# EAGLE schematic GTA04b7 (EAGLE 7.4.0), part 1 of 3
Assembly variants: Full, BB-XM, Default

## Sheet 1 of 38
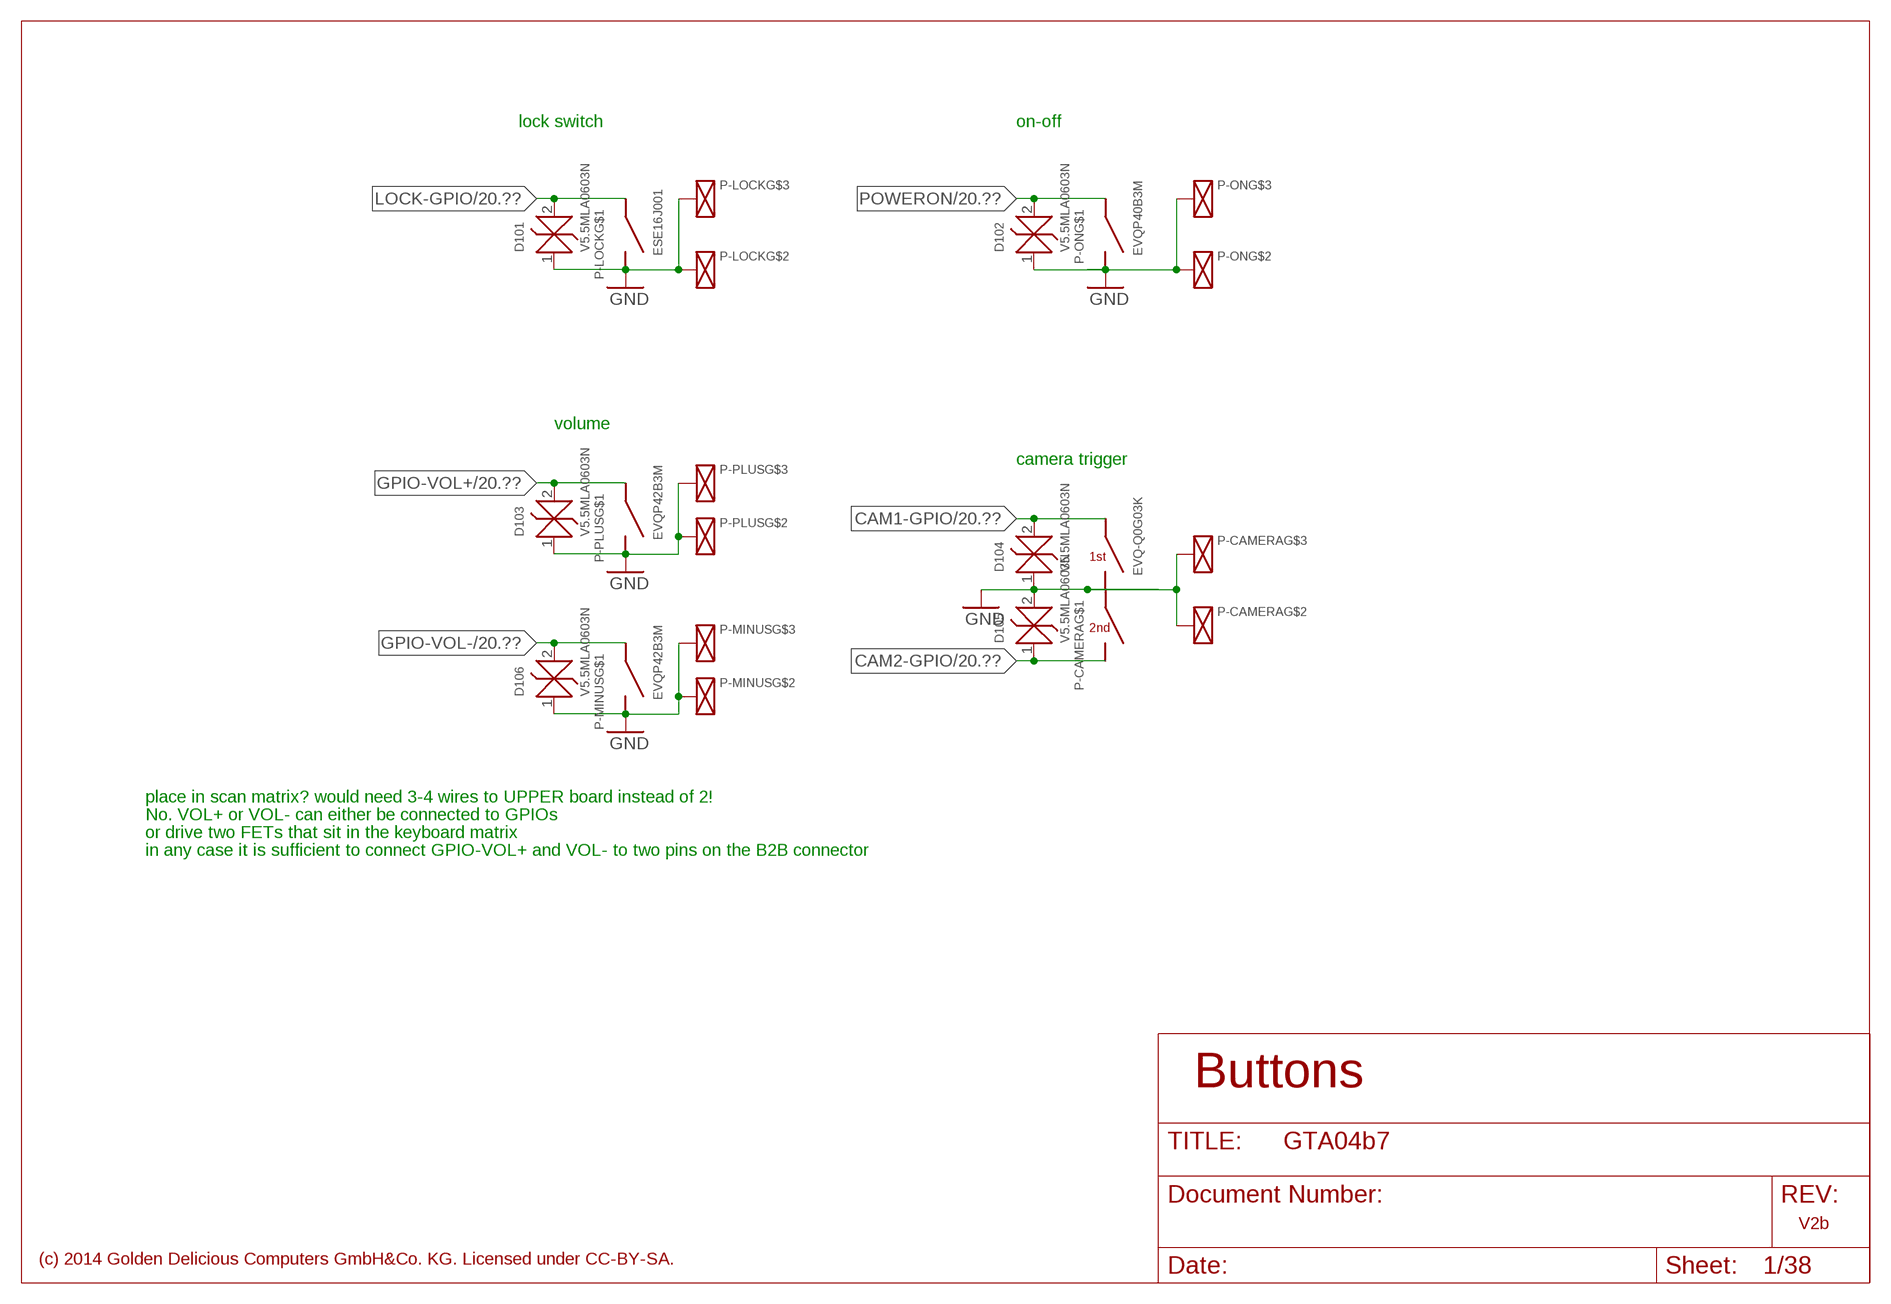
[diagram p0: schematic, sheet 1]

### Parts
D101  V5.5MLA0603N  [SMD-0603]
D102  V5.5MLA0603N  [SMD-0603]
D103  V5.5MLA0603N  [SMD-0603]
D104  V5.5MLA0603N  [SMD-0603]
D105  V5.5MLA0603N  [SMD-0603]
D106  V5.5MLA0603N  [SMD-0603]
P-CAMERA  EVQ-Q0G03K  BUTTON-2LEVEL  [EVQQ0]
P-LOCK  ESE16J001  BUTTON-GND-ESE16  [ESE-16J001]
P-MINUS  EVQP42B3M  BUTTON-GND-EVQP4  [EVQP40B3M]
P-ON  EVQP40B3M  BUTTON-GND-EVQP4  [EVQP40B3M]
P-PLUS  EVQP42B3M  BUTTON-GND-EVQP4  [EVQP40B3M]

### Nets
CAM1-GPIO: D104.2(K) P-CAMERA.1 ; also sheet 20
CAM2-GPIO: D105.1(A) P-CAMERA.2 ; also sheet 20
GND [GND]: D101.1(A) D102.1(A) D103.1(A) D104.1(A) D105.2(K) D106.1(A) P-CAMERA.3 P-CAMERA.S1(SHIELD) P-CAMERA.S2(SHIELD) P-LOCK.2(SHIELD) P-LOCK.3(B) P-LOCK.4(SHIELD) P-MINUS.2(B) P-MINUS.S1(SHIELD) P-MINUS.S2(SHIELD) P-ON.2(B) P-ON.S1(SHIELD) P-ON.S2(SHIELD) P-PLUS.2(B) P-PLUS.S1(SHIELD) P-PLUS.S2(SHIELD) ; also sheet 2,3,4,5,6,7,8,9,10,11,12,13,14,15,16,17,18,19,20
GPIO-VOL+: D103.2(K) P-PLUS.1(A) ; also sheet 20
GPIO-VOL-: D106.2(K) P-MINUS.1(A) ; also sheet 20
LOCK-GPIO: D101.2(K) P-LOCK.1(A) ; also sheet 20
POWERON [GND]: D102.2(K) P-ON.1(A) ; also sheet 20

### Notes on the sheet
- lock switch | on-off
- volume
- camera trigger
- place in scan matrix? would need 3-4 wires to UPPER board instead of 2!
- No. VOL+ or VOL- can either be connected to GPIOs
- or drive two FETs that sit in the keyboard matrix
- in any case it is sufficient to connect GPIO-VOL+ and VOL- to two pins on the B2B connector
- Buttons
- V2b
- (c) 2014 Golden Delicious Computers GmbH&Co. KG. Licensed under CC-BY-SA.

## Sheet 2 of 38
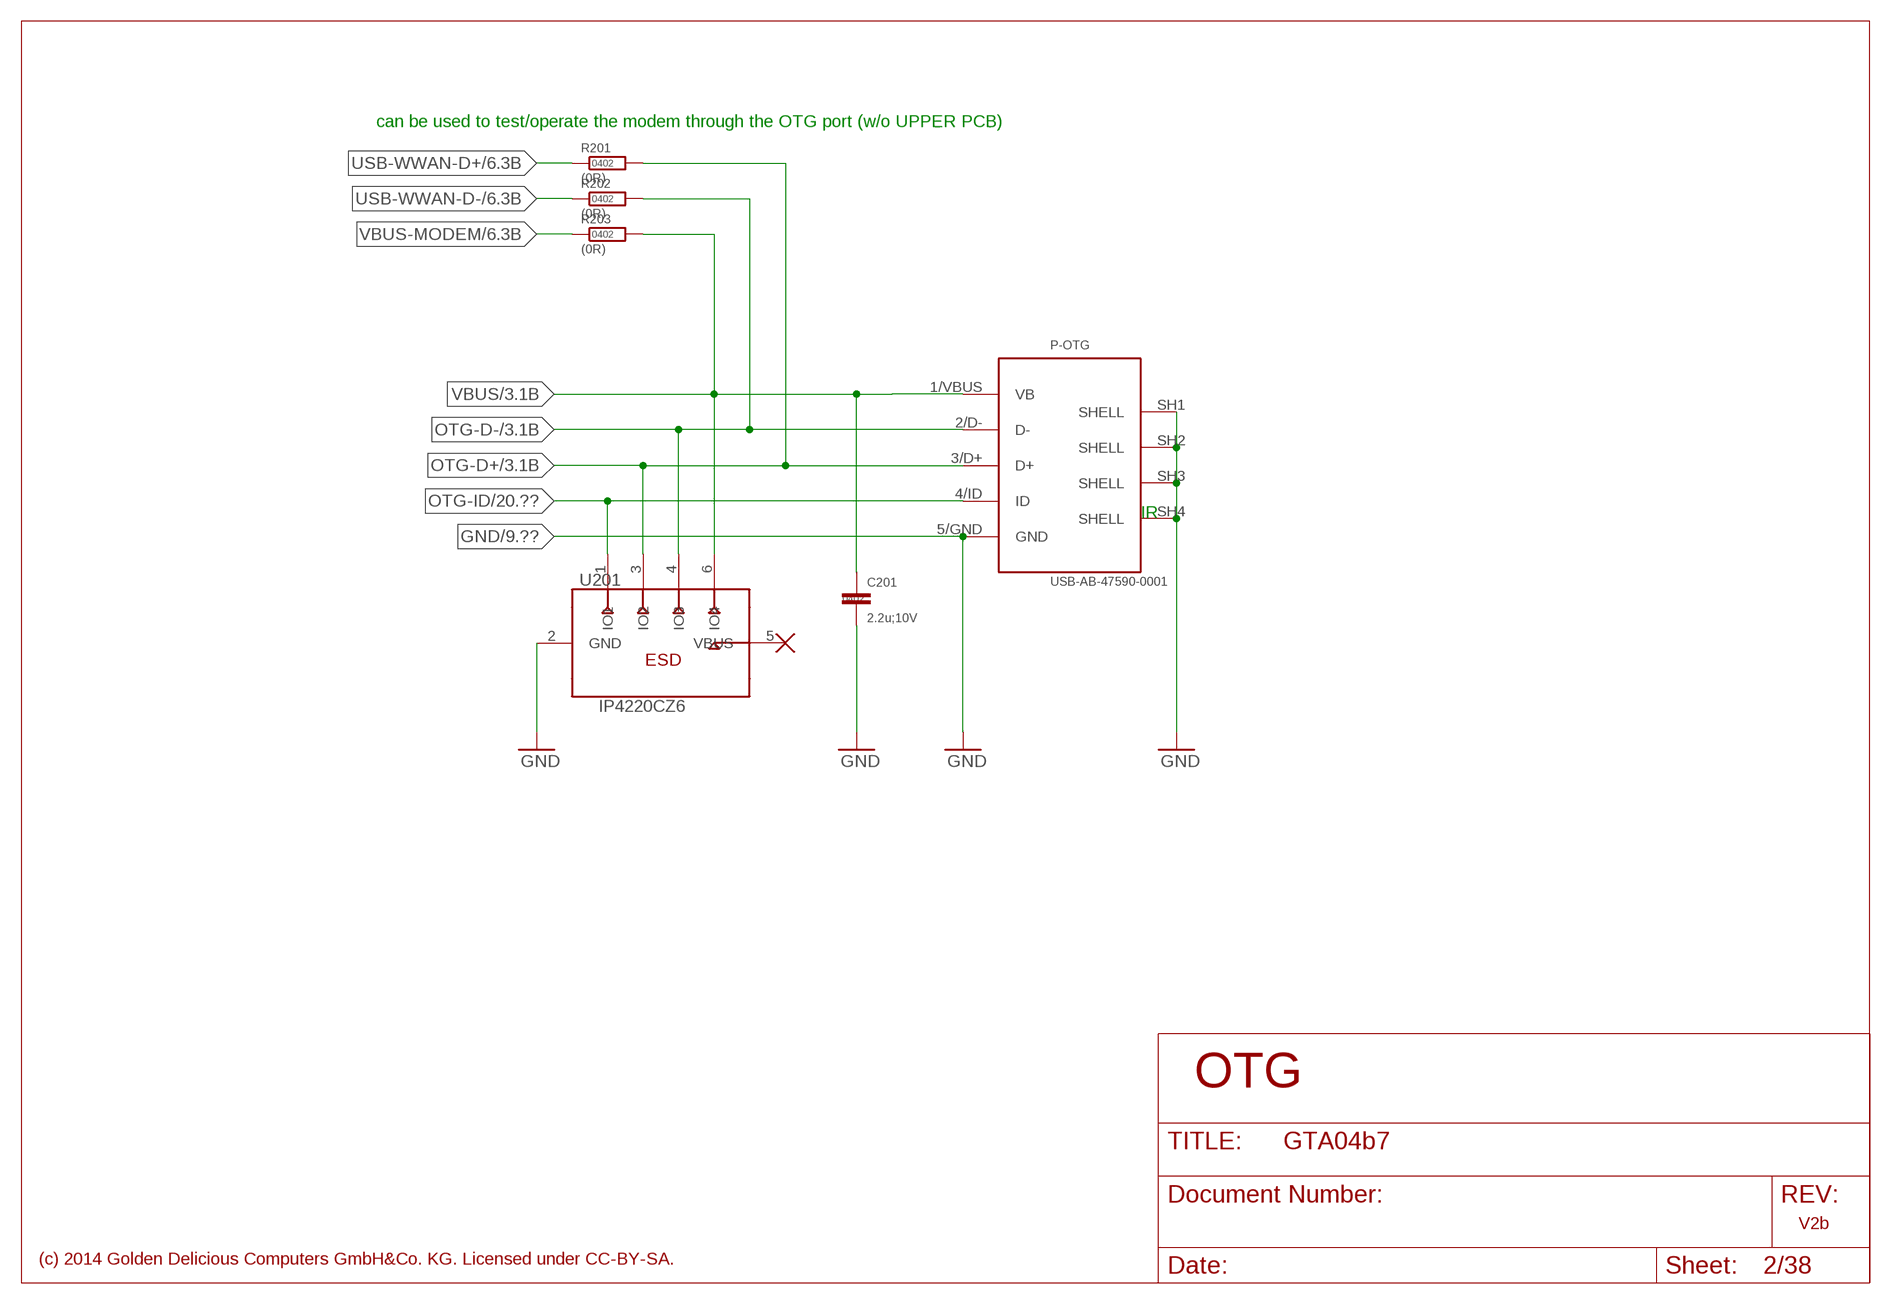
[diagram p1: schematic, sheet 2]

### Parts
C201  2.2u;10V  C0402  [SMD-0402]
P-OTG  USB-AB-47590-0001  [SD-47590-0001]
R201  (0R)  R0402  [SMD-0402]  (not fitted in variant Full)  (not fitted in variant BB-XM)
R202  (0R)  R0402  [SMD-0402]  (not fitted in variant Full)  (not fitted in variant BB-XM)
R203  (0R)  R0402  [SMD-0402]  (not fitted in variant Full)  (not fitted in variant BB-XM)
U201  IP4220CZ6  [SOT457-6]

### Nets
GND [GND]: C201.2 P-OTG.5/GND(GND) P-OTG.SH1(SHELL) P-OTG.SH2(SHELL) P-OTG.SH3(SHELL) P-OTG.SH4(SHELL) U201.2(GND) ; also sheet 1,3,4,5,6,7,8,9,10,11,12,13,14,15,16,17,18,19,20
OTG-D+ [90 Ohm]: P-OTG.3/D+(D+) R201.2 U201.3(IO2) ; also sheet 3,20
OTG-D- [90 Ohm]: P-OTG.2/D-(D-) R202.2 U201.4(IO3) ; also sheet 3,20
OTG-ID: P-OTG.4/ID(ID) U201.1(IO1) ; also sheet 20
USB-WWAN-D+ [90 Ohm]: R201.1 ; also sheet 6,18,20
USB-WWAN-D- [90 Ohm]: R202.1 ; also sheet 6,18,20
VBUS [Battery]: C201.1 P-OTG.1/VBUS(VB) U201.6(IO4) ; also sheet 3,18,20
VBUS-MODEM [Battery]: R203.1 ; also sheet 6,20
VBUS-MODEM-CPU: R203.2 ; also sheet 28,33
Unconnected: U201.5(VBUS)

### Notes on the sheet
- can be used to test/operate the modem through the OTG port (w/o UPPER PCB)
- IR
- OTG
- V2b
- (c) 2014 Golden Delicious Computers GmbH&Co. KG. Licensed under CC-BY-SA.

## Sheet 3 of 38
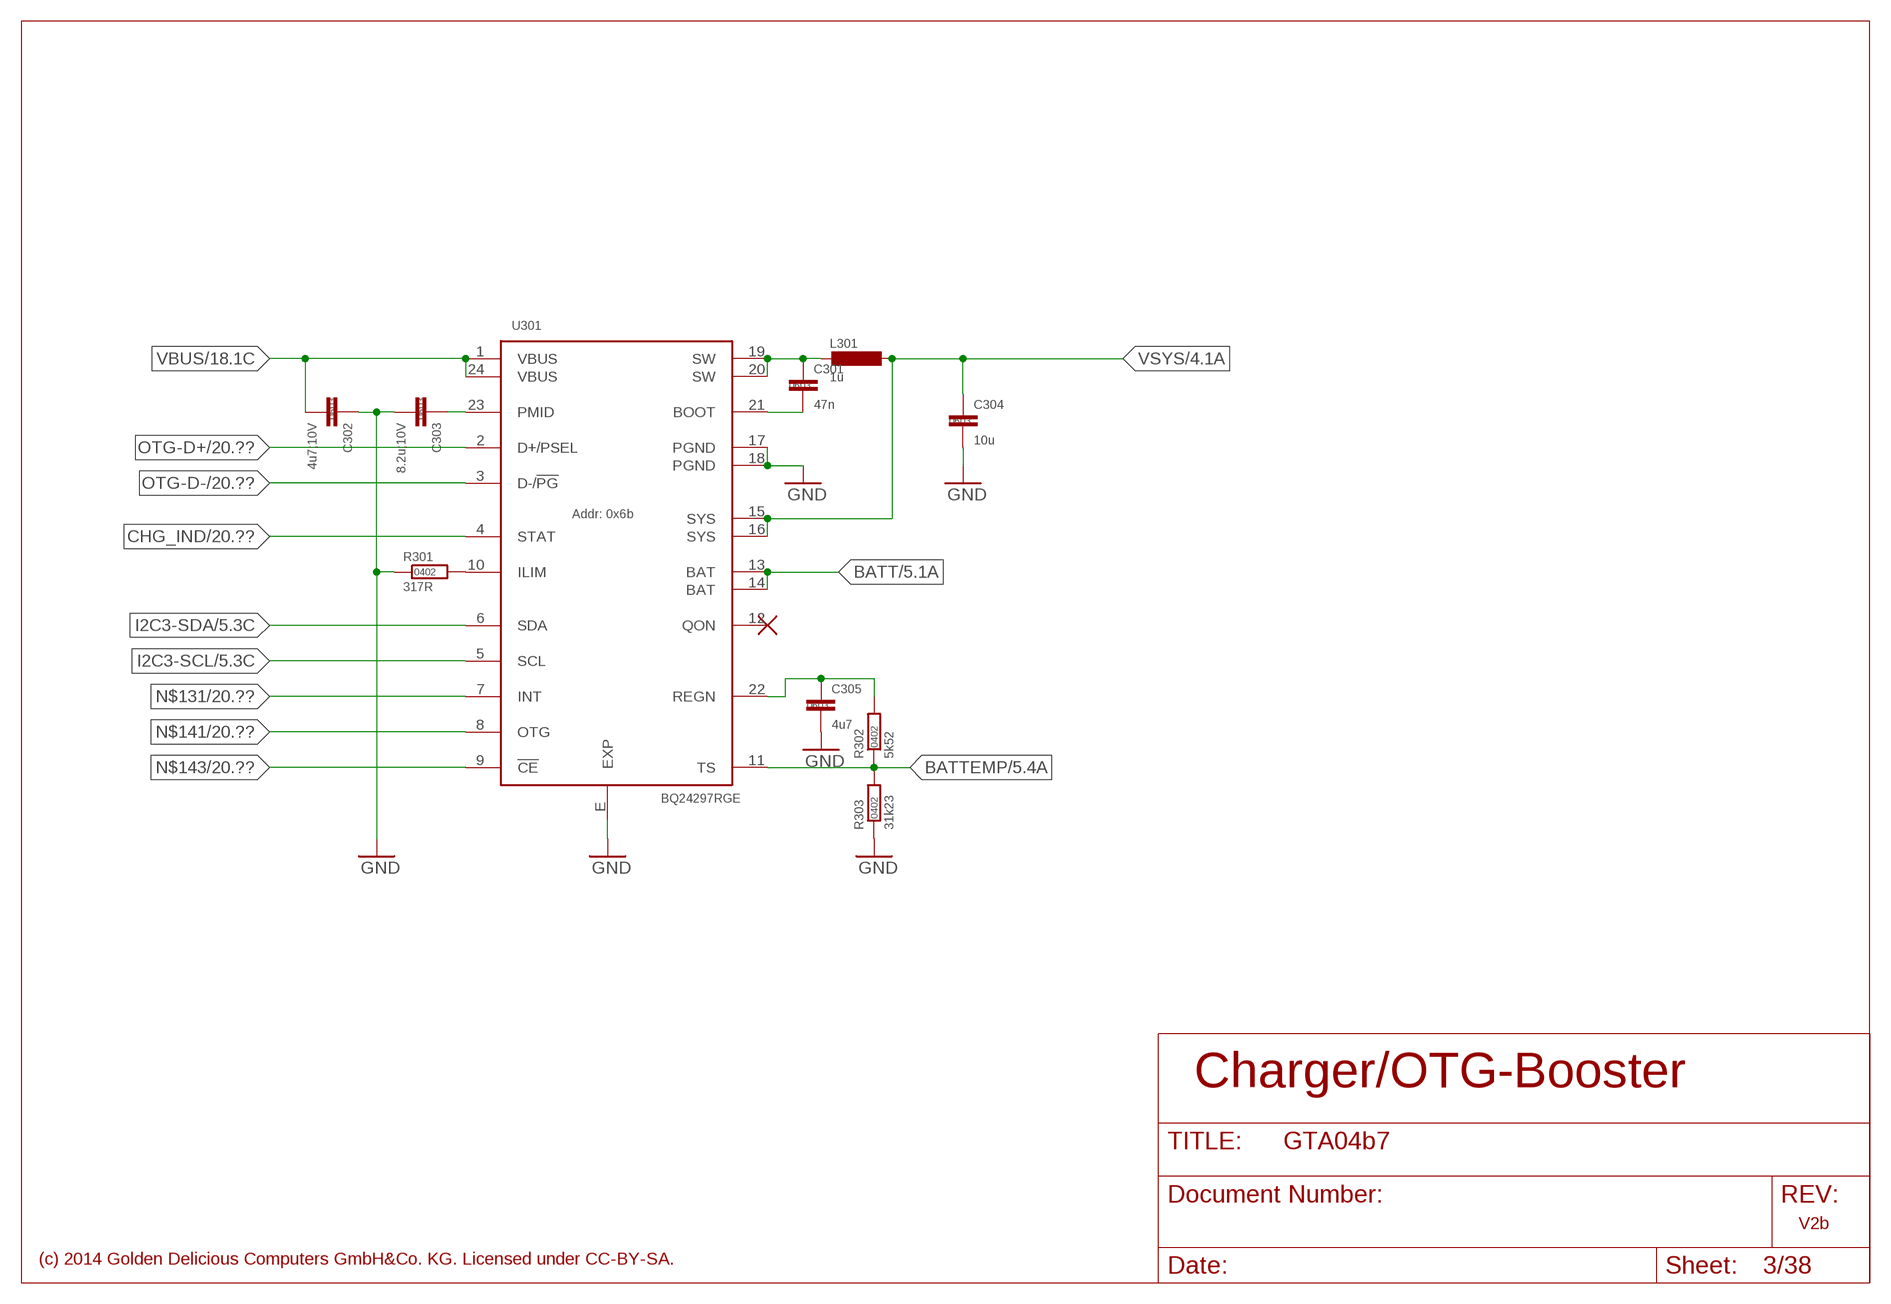
[diagram p2: schematic, sheet 3]

### Parts
C301  47n  C0603  [SMD-0603]
C302  4u7;10V  C0603  [SMD-0603]
C303  8.2u;10V  C0603  [SMD-0603]
C304  10u  C0603  [SMD-0603]
C305  4u7  C0603  [SMD-0603]
L301  1u  L1212  [SMD-1212]
R301  317R  R0402  [SMD-0402]
R302  5k52  R0402  [SMD-0402]
R303  31k23  R0402  [SMD-0402]
U301  BQ24297RGE  BQ2429XRGE  [S-PVQFN-N24-0.5]

### Nets
BATT [Battery]: U301.13(BAT) U301.14(BAT) ; also sheet 5,18
BATTEMP: R302.1 R303.2 U301.11(TS) ; also sheet 5,20
CHG_IND: U301.4(STAT) ; also sheet 20,32
GND [GND]: C302.1 C303.2 C304.2 C305.2 R301.1 R303.1 U301.17(PGND) U301.18(PGND) U301.E(EXP) ; also sheet 1,2,4,5,6,7,8,9,10,11,12,13,14,15,16,17,18,19,20
I2C3-SCL: U301.5(SCL) ; also sheet 5,10,20
I2C3-SDA: U301.6(SDA) ; also sheet 5,10,20
N$131: U301.7(INT) ; also sheet 20
N$134: C303.1 U301.23(PMID)
N$138: C305.1 R302.2 U301.22(REGN)
N$139: C301.1 L301.2 U301.19(SW) U301.20(SW)
N$140: R301.2 U301.10(ILIM)
N$141: U301.8(OTG) ; also sheet 20
N$143: U301.9(!CE) ; also sheet 20
N$144: C301.2 U301.21(BOOT)
OTG-D+ [90 Ohm]: U301.2(D+/PSEL) ; also sheet 2,20
OTG-D- [90 Ohm]: U301.3(D-/!PG) ; also sheet 2,20
VBUS [Battery]: C302.2 U301.1(VBUS) U301.24(VBUS) ; also sheet 2,18,20
VSYS [GND]: C304.1 L301.1 U301.15(SYS) U301.16(SYS) ; also sheet 4,9,14,15,18,19,20
Unconnected: U301.12(QON)

### Notes on the sheet
- Charger/OTG-Booster
- V2b
- (c) 2014 Golden Delicious Computers GmbH&Co. KG. Licensed under CC-BY-SA.

## Sheet 4 of 38
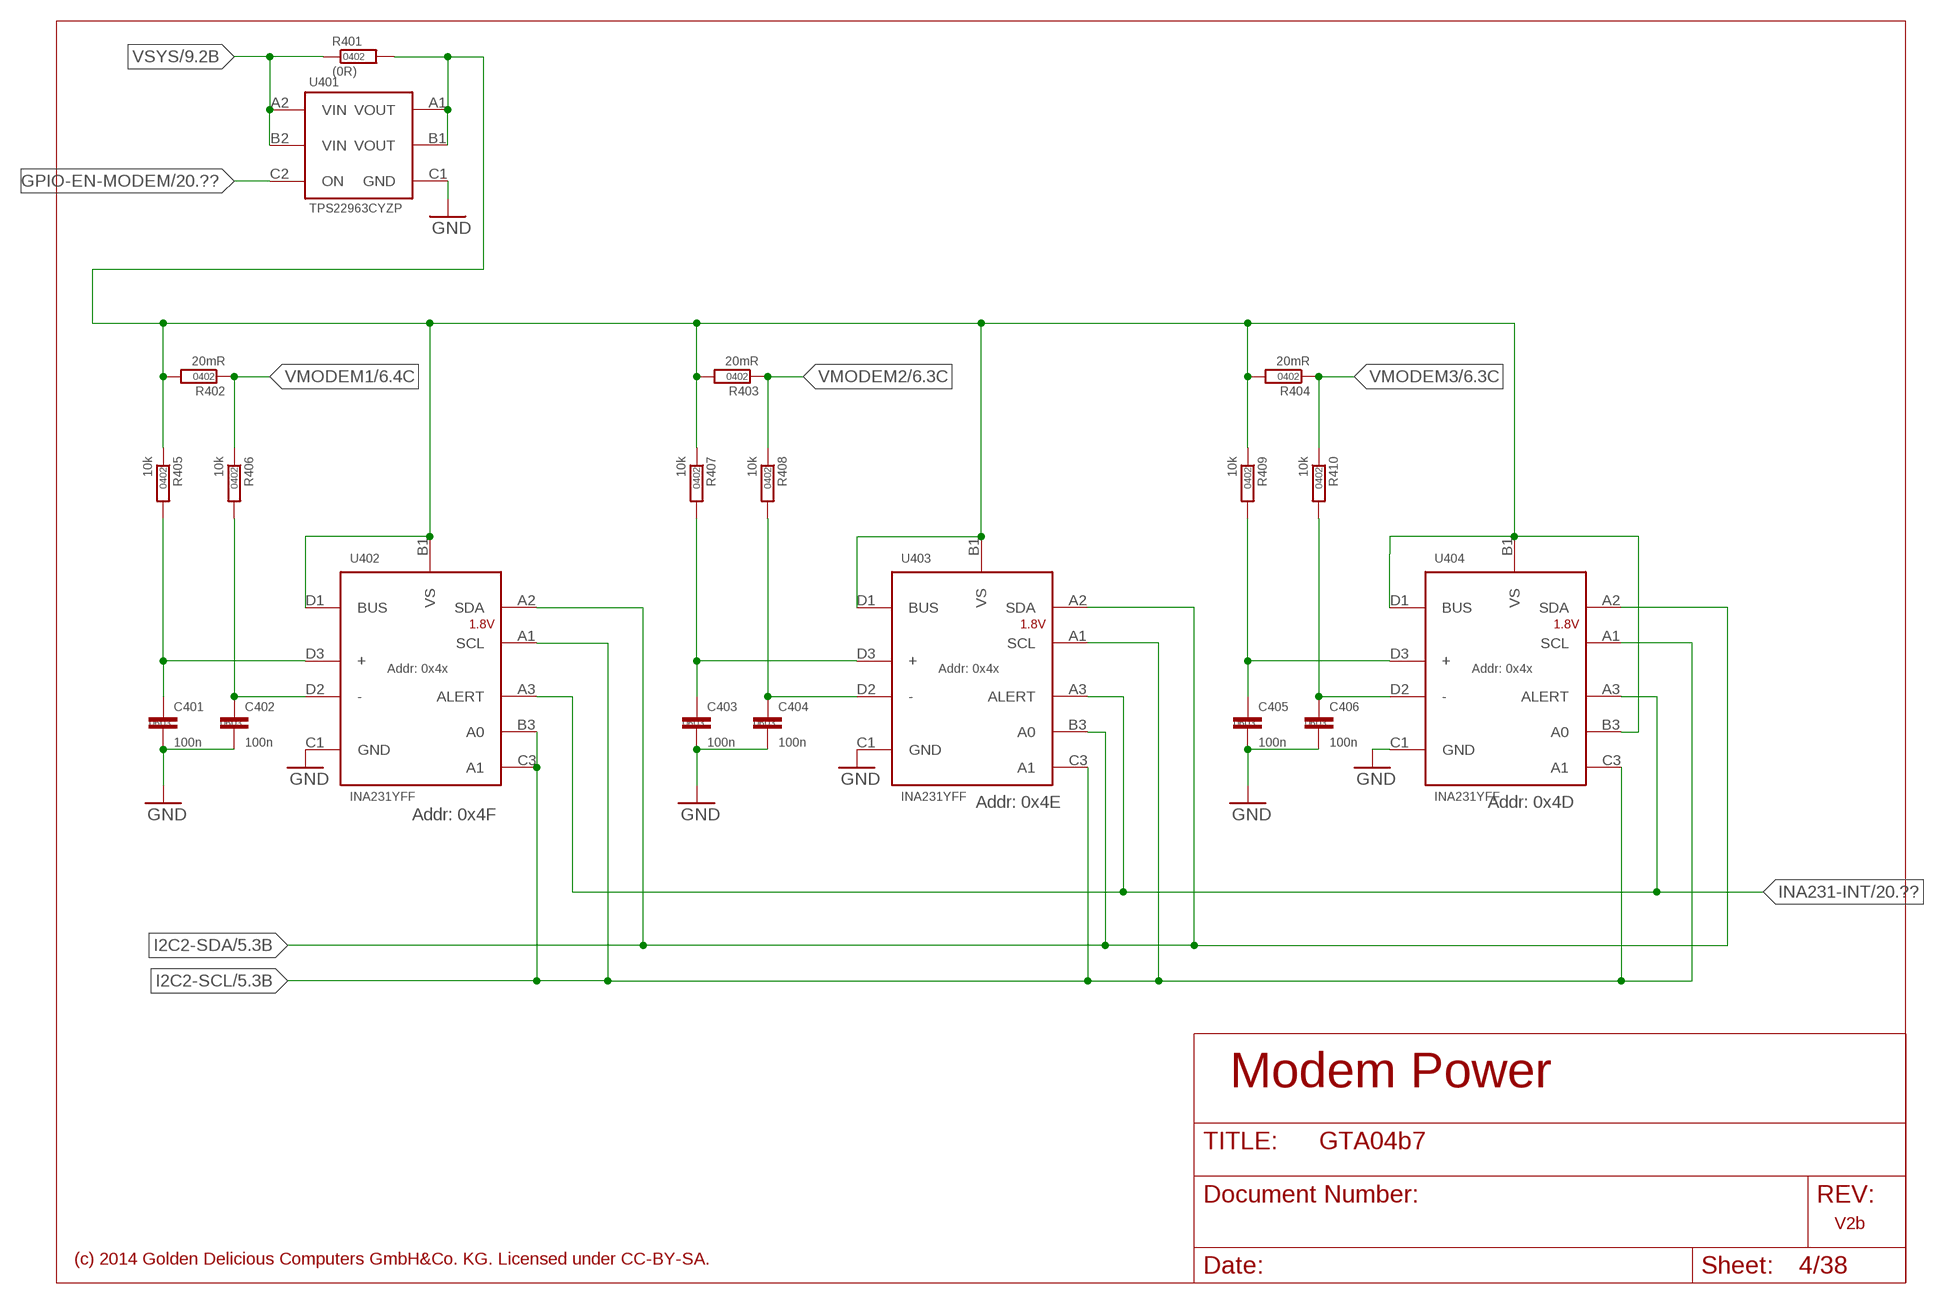
[diagram p3: schematic, sheet 4]

### Parts
C401  100n  C0603  [SMD-0603]
C402  100n  C0603  [SMD-0603]
C403  100n  C0603  [SMD-0603]
C404  100n  C0603  [SMD-0603]
C405  100n  C0603  [SMD-0603]
C406  100n  C0603  [SMD-0603]
R401  (0R)  R0402  [SMD-0402]  (not fitted in variant Full)  (not fitted in variant BB-XM)
R402  20mR  R0402  [SMD-0402]
R403  20mR  R0402  [SMD-0402]
R404  20mR  R0402  [SMD-0402]
R405  10k  R0402  [SMD-0402]
R406  10k  R0402  [SMD-0402]
R407  10k  R0402  [SMD-0402]
R408  10k  R0402  [SMD-0402]
R409  10k  R0402  [SMD-0402]
R410  10k  R0402  [SMD-0402]
U401  TPS22963CYZP  TPS22964CYZP  [R-XBGA-N6-0.5]
U402  INA231YFF  [R-XBGA-N12-0.4]
U403  INA231YFF  [R-XBGA-N12-0.4]
U404  INA231YFF  [R-XBGA-N12-0.4]

### Nets
GND [GND]: C401.2 C402.2 C403.2 C404.2 C405.2 C406.2 U401.C1(GND) U402.C1(GND) U403.C1(GND) U404.C1(GND) ; also sheet 1,2,3,5,6,7,8,9,10,11,12,13,14,15,16,17,18,19,20
GPIO-EN-MODEM: U401.C2(ON) ; also sheet 20
I2C2-SCL: U402.A1(SCL) U402.B3(A0) U402.C3(A1) U403.A1(SCL) U403.C3(A1) U404.A1(SCL) U404.C3(A1) ; also sheet 5,9,11,12,15,20
I2C2-SDA: U402.A2(SDA) U403.A2(SDA) U403.B3(A0) U404.A2(SDA) ; also sheet 5,9,11,12,15,20
INA231-INT: U402.A3(ALERT) U403.A3(ALERT) U404.A3(ALERT) ; also sheet 20
N$81: U404.B3(A0)
N$83: C403.1 R407.2 U403.D3(+)
N$84: C404.1 R408.2 U403.D2(-)
N$86: C405.1 R409.2 U404.D3(+)
N$87: C406.1 R410.2 U404.D2(-)
N$88 [Battery]: R401.2 R402.2 R403.2 R404.2 R405.1 R407.1 R409.1 U401.A1(VOUT) U401.B1(VOUT) U402.B1(VS) U402.D1(BUS) U403.B1(VS) U403.D1(BUS) U404.B1(VS) U404.D1(BUS)
N$158: C401.1 R405.2 U402.D3(+)
N$163: C402.1 R406.2 U402.D2(-)
VMODEM1 [Battery]: R402.1 R406.1 ; also sheet 6
VMODEM2 [Battery]: R403.1 R408.1 ; also sheet 6
VMODEM3 [Battery]: R404.1 R410.1 ; also sheet 6
VSYS [GND]: R401.1 U401.A2(VIN) U401.B2(VIN) ; also sheet 3,9,14,15,18,19,20

### Notes on the sheet
- Addr: 0x4E | Addr: 0x4D
- Addr: 0x4F
- Modem Power
- V2b
- (c) 2014 Golden Delicious Computers GmbH&Co. KG. Licensed under CC-BY-SA.

## Sheet 5 of 38
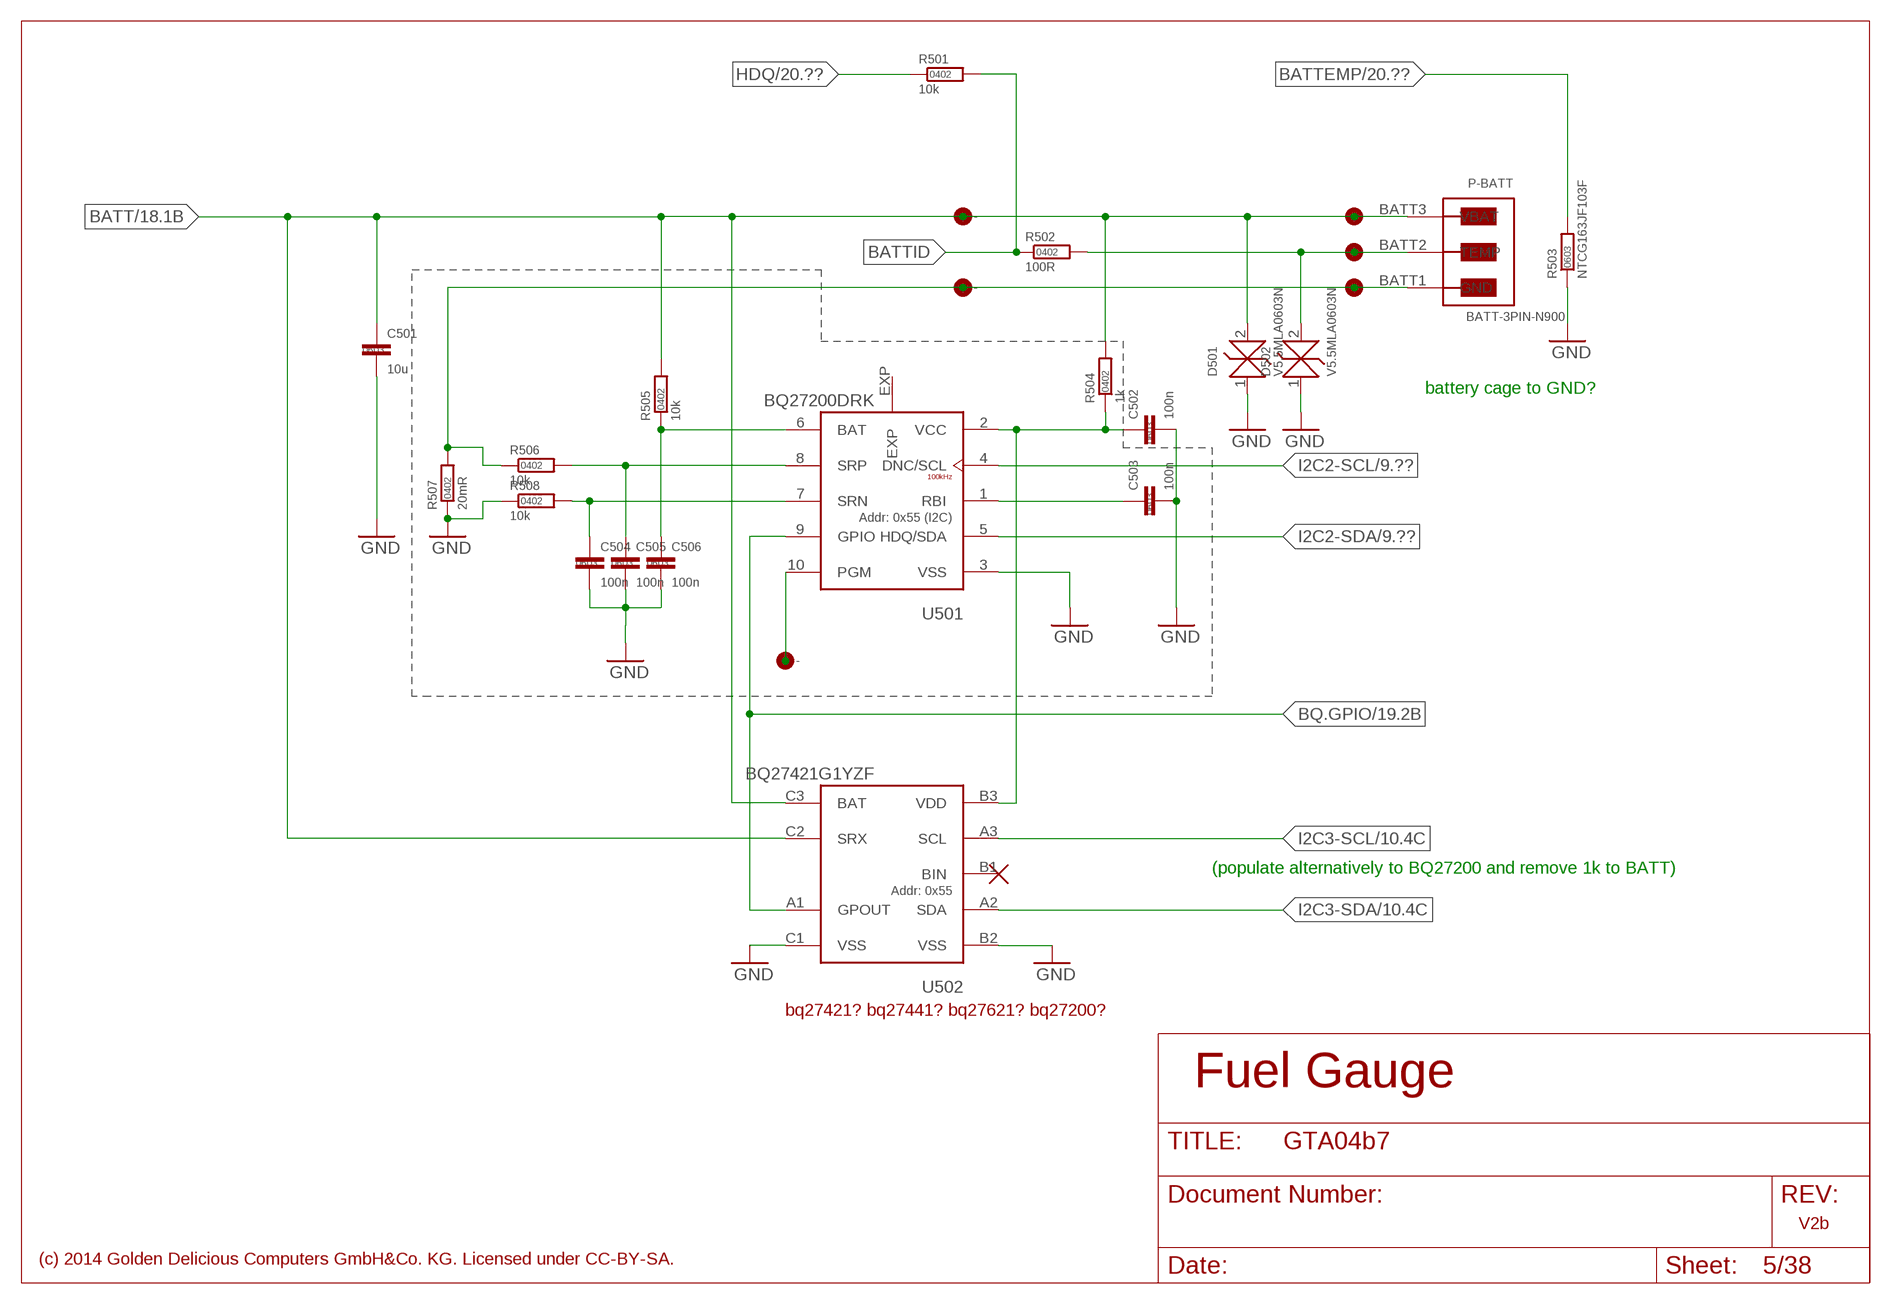
[diagram p4: schematic, sheet 5]

### Parts
BATT+  TEST-POINT-1.25  [TP-1.25]  (not fitted in variant Full)  (not fitted in variant BB-XM)
BATT-GND  TEST-POINT-1.25  [TP-1.25]  (not fitted in variant Full)  (not fitted in variant BB-XM)
BATT-ID  TEST-POINT-1.25  [TP-1.25]  (not fitted in variant Full)  (not fitted in variant BB-XM)
BGND  -  TEST-POINT-HOLE  [1PIN-HOLE]  (not fitted in variant Full)  (not fitted in variant BB-XM)
C501  10u  C0603  [SMD-0603]
C502  100n  C0603  [SMD-0603]
C503  100n  C0603  [SMD-0603]
C504  100n  C0603  [SMD-0603]
C505  100n  C0603  [SMD-0603]
C506  100n  C0603  [SMD-0603]
D501  V5.5MLA0603N  [SMD-0603]
D502  V5.5MLA0603N  [SMD-0603]
P-BATT  BATT-3PIN-N900  [N900-BATTCONN]
PGM  -  TEST-POINT-HOLE  [1PIN-HOLE]  (not fitted in variant Full)  (not fitted in variant BB-XM)
R501  10k  R0402  [SMD-0402]
R502  100R  R0402  [SMD-0402]
R503  NTCG163JF103F  R0603  [SMD-0603]
R504  1k  R0402  [SMD-0402]
R505  10k  R0402  [SMD-0402]
R506  10k  R0402  [SMD-0402]
R507  20mR  R0402  [SMD-0402]
R508  10k  R0402  [SMD-0402]
U501  BQ27200DRK  BQ27X00DRK  [S-PVSON-N10-4X3]
U502  BQ27421G1YZF  [S-XBGA-N9-0.5]
VBATT  -  TEST-POINT-HOLE  [1PIN-HOLE]  (not fitted in variant Full)  (not fitted in variant BB-XM)

### Nets
BATT [Battery]: BATT+.P C501.1 D501.2(K) P-BATT.BATT3(VBAT) R504.2 R505.2 U502.C2(SRX) U502.C3(BAT) VBATT.P$1 ; also sheet 3,18
BATTEMP: R503.2 ; also sheet 3,20
BATTID: R501.2 R502.1
BGND [GND]: BATT-GND.P BGND.P$1 P-BATT.BATT1(GND) R506.1 R507.2
BQ.GPIO: U501.9(GPIO) U502.A1(GPOUT) ; also sheet 19
GND [GND]: C501.2 C502.2 C503.2 C504.2 C505.2 C506.2 D501.1(A) D502.1(A) R503.1 R507.1 R508.1 U501.3(VSS) U502.B2(VSS) U502.C1(VSS) ; also sheet 1,2,3,4,6,7,8,9,10,11,12,13,14,15,16,17,18,19,20
HDQ: R501.1 ; also sheet 20
I2C2-SCL: U501.4(DNC/SCL) ; also sheet 4,9,11,12,15,20
I2C2-SDA: U501.5(HDQ/SDA) ; also sheet 4,9,11,12,15,20
I2C3-SCL: U502.A3(SCL) ; also sheet 3,10,20
I2C3-SDA: U502.A2(SDA) ; also sheet 3,10,20
N$34: BATT-ID.P D502.2(K) P-BATT.BATT2(TEMP) R502.2
N$66: C503.1 U501.1(RBI)
N$135: C505.1 R506.2 U501.8(SRP)
N$136: C506.1 R505.1 U501.6(BAT)
N$146: C504.1 R508.2 U501.7(SRN)
N$151: PGM.P$1 U501.10(PGM)
N$152: C502.1 R504.1 U501.2(VCC) U502.B3(VDD)
Unconnected: U502.B1(BIN)

### Notes on the sheet
- battery cage to GND?
- (populate alternatively to BQ27200 and remove 1k to BATT)
- bq27421? bq27441? bq27621? bq27200?
- Fuel Gauge
- V2b
- (c) 2014 Golden Delicious Computers GmbH&Co. KG. Licensed under CC-BY-SA.

## Sheet 6 of 38
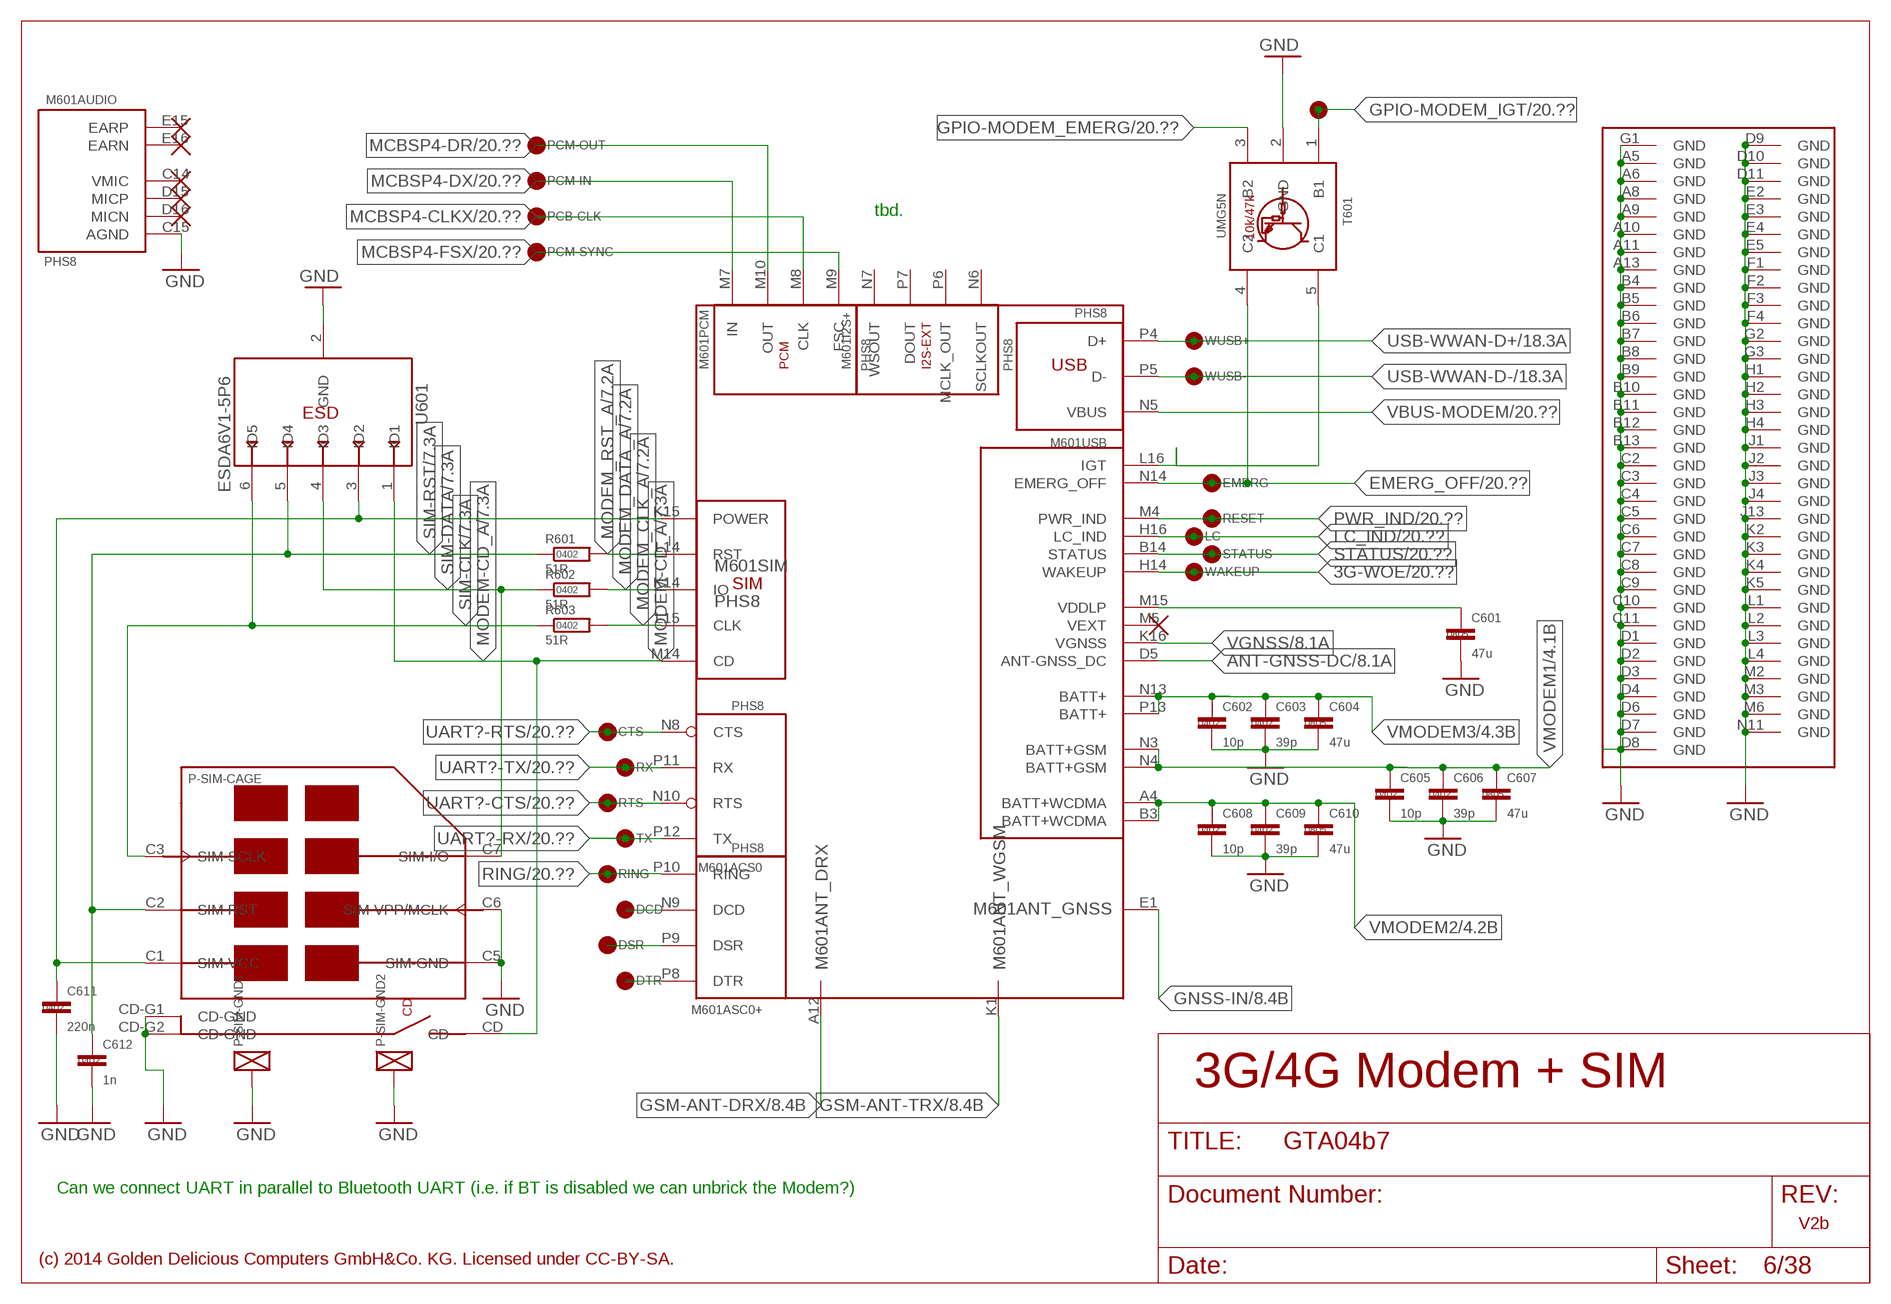
[diagram p5: schematic, sheet 6]

### Parts
C601  47u  C0805  [SMD-0805]
C602  10p  C0402  [SMD-0402]
C603  39p  C0402  [SMD-0402]
C604  47u  C0805  [SMD-0805]
C605  10p  C0402  [SMD-0402]
C606  39p  C0402  [SMD-0402]
C607  47u  C0805  [SMD-0805]
C608  10p  C0402  [SMD-0402]
C609  39p  C0402  [SMD-0402]
C610  47u  C0805  [SMD-0805]
C611  220n  C0402  [SMD-0402]
C612  1n  C0402  [SMD-0402]
CTS  CTS  TEST-POINT-0.75  [TP-0.75]  (not fitted in variant Full)  (not fitted in variant BB-XM)
D+  WUSB+  TEST-POINT-1.25  [TP-1.25]  (not fitted in variant Full)  (not fitted in variant BB-XM)
D-  WUSB-  TEST-POINT-1.25  [TP-1.25]  (not fitted in variant Full)  (not fitted in variant BB-XM)
DCD  DCD  TEST-POINT-0.75  [TP-0.75]  (not fitted in variant Full)  (not fitted in variant BB-XM)
DSR  DSR  TEST-POINT-0.75  [TP-0.75]  (not fitted in variant Full)  (not fitted in variant BB-XM)
DTR  DTR  TEST-POINT-0.75  [TP-0.75]  (not fitted in variant Full)  (not fitted in variant BB-XM)
GPIO601  TEST-POINT-1.25  [TP-1.25]  (not fitted in variant Full)  (not fitted in variant BB-XM)
LC_IND  LC  TEST-POINT-1.25  [TP-1.25]  (not fitted in variant Full)  (not fitted in variant BB-XM)
M601  PHS8  [P*S8]
MCBSP4-CLK  PCB-CLK  TEST-POINT-1.25  [TP-1.25]  (not fitted in variant Full)  (not fitted in variant BB-XM)
MCBSP4-DR  PCM-OUT  TEST-POINT-1.25  [TP-1.25]  (not fitted in variant Full)  (not fitted in variant BB-XM)
MCBSP4-DX  PCM-IN  TEST-POINT-1.25  [TP-1.25]  (not fitted in variant Full)  (not fitted in variant BB-XM)
MCBSP4-FSX  PCM-SYNC  TEST-POINT-1.25  [TP-1.25]  (not fitted in variant Full)  (not fitted in variant BB-XM)
P-SIM  SIM-SLOT-6PIN+CD-CHECK-PINS  SIM-SLOT-6PIN+CD  [SJ106220]
PWR_IND  RESET  TEST-POINT-1.25  [TP-1.25]  (not fitted in variant Full)  (not fitted in variant BB-XM)
R601  51R  R0402  [SMD-0402]
R602  51R  R0402  [SMD-0402]
R603  51R  R0402  [SMD-0402]
RING  RING  TEST-POINT-0.75  [TP-0.75]  (not fitted in variant Full)  (not fitted in variant BB-XM)
RTS  RTS  TEST-POINT-0.75  [TP-0.75]  (not fitted in variant Full)  (not fitted in variant BB-XM)
RX  RX  TEST-POINT-0.75  [TP-0.75]  (not fitted in variant Full)  (not fitted in variant BB-XM)
STATUS  STATUS  TEST-POINT-1.25  [TP-1.25]  (not fitted in variant Full)  (not fitted in variant BB-XM)
T601  UMG5N  T-NPN-DUAL-UMG5N  [SC88A]
TP2  EMERG  TEST-POINT-1.25  [TP-1.25]  (not fitted in variant Full)  (not fitted in variant BB-XM)
TX  TX  TEST-POINT-0.75  [TP-0.75]  (not fitted in variant Full)  (not fitted in variant BB-XM)
U601  ESDA6V1-5P6  [SOT666IP]
WAKEUP  WAKEUP  TEST-POINT-1.25  [TP-1.25]  (not fitted in variant Full)  (not fitted in variant BB-XM)

### Nets
3G-WOE: M601.H14(POWER:WAKEUP) WAKEUP.P ; also sheet 20
ANT-GNSS-DC: M601.D5(POWER:ANT-GNSS_DC) ; also sheet 8
EMERG_OFF: M601.N14(POWER:EMERG_OFF) T601.4(C2) TP2.P ; also sheet 20
GND [GND]: C601.2 C602.2 C603.2 C604.2 C605.2 C606.2 C607.2 C608.2 C609.2 C610.2 C611.2 C612.2 M601.A5(GND) M601.A6(GND) M601.A8(GND) M601.A9(GND) M601.A10(GND) M601.A11(GND) M601.A13(GND) M601.B4(GND) M601.B5(GND) M601.B6(GND) M601.B7(GND) M601.B8(GND) M601.B9(GND) M601.B10(GND) M601.B11(GND) M601.B12(GND) M601.B13(GND) M601.C2(GND) M601.C3(GND) M601.C4(GND) M601.C5(GND) M601.C6(GND) M601.C7(GND) M601.C8(GND) M601.C9(GND) M601.C10(GND) M601.C11(GND) M601.C15(AUDIO:AGND) M601.D1(GND) M601.D2(GND) M601.D3(GND) M601.D4(GND) M601.D6(GND) M601.D7(GND) M601.D8(GND) M601.D9(GND) M601.D10(GND) M601.D11(GND) M601.E2(GND) M601.E3(GND) M601.E4(GND) M601.E5(GND) M601.F1(GND) M601.F2(GND) M601.F3(GND) M601.F4(GND) M601.G1(GND) M601.G2(GND) M601.G3(GND) M601.H1(GND) M601.H2(GND) M601.H3(GND) M601.H4(GND) M601.J1(GND) M601.J2(GND) M601.J3(GND) M601.J4(GND) M601.J13(GND) M601.K2(GND) M601.K3(GND) M601.K4(GND) M601.K5(GND) M601.L1(GND) M601.L2(GND) M601.L3(GND) M601.L4(GND) M601.M2(GND) M601.M3(GND) M601.M6(GND) M601.N11(GND) P-SIM.C5(-CAGE:SIM-GND) P-SIM.C6(-CAGE:SIM-VPP/MCLK) P-SIM.CD-G1(-CAGE:CD-GND) P-SIM.CD-G2(-CAGE:CD-GND) P-SIM.S1(-GND1:SHIELD) P-SIM.S2(-GND2:SHIELD) T601.2(GND) U601.2(GND) ; also sheet 1,2,3,4,5,7,8,9,10,11,12,13,14,15,16,17,18,19,20
GNSS-IN [50 Ohm]: M601.E1(ANT_GNSS:PIN) ; also sheet 8
GPIO-MODEM_EMERG: T601.3(B2) ; also sheet 20
GPIO-MODEM_IGT: GPIO601.P T601.1(B1) ; also sheet 20
GSM-ANT-DRX [50 Ohm]: M601.A12(ANT_DRX:PIN) ; also sheet 8
GSM-ANT-TRX [50 Ohm]: M601.K1(ANT_WGSM:PIN) ; also sheet 8
LC_IND: LC_IND.P M601.H16(POWER:LC_IND) ; also sheet 20
MCBSP4-CLKX: M601.M8(PCM:CLK) MCBSP4-CLK.P ; also sheet 20
MCBSP4-DR: M601.M10(PCM:OUT) MCBSP4-DR.P ; also sheet 20
MCBSP4-DX: M601.M7(PCM:IN) MCBSP4-DX.P ; also sheet 20
MCBSP4-FSX: M601.M9(PCM:FSC) MCBSP4-FSX.P ; also sheet 20
MODEM-CD_A: M601.M14(SIM:CD) P-SIM.CD(-CAGE:CD) U601.1(IO1) ; also sheet 7
MODEM_CLK_A: M601.L15(SIM:CLK) R603.2 ; also sheet 7
MODEM_DATA_A: M601.K14(SIM:IO) R602.2 ; also sheet 7
MODEM_RST_A: M601.L14(SIM:RST) R601.2 ; also sheet 7
N$18: C611.1 M601.K15(SIM:POWER) P-SIM.C1(-CAGE:SIM-VCC) U601.3(IO2)
N$42: DCD.P M601.N9(ASC0+:DCD)
N$43: DSR.P M601.P9(ASC0+:DSR)
N$44: DTR.P M601.P8(ASC0+:DTR)
N$175: C601.1 M601.M15(POWER:VDDLP)
ON_KEY [GND]: M601.L16(POWER:IGT) T601.5(C1)
PWR_IND: M601.M4(POWER:PWR_IND) PWR_IND.P ; also sheet 20
RING: M601.P10(ASC0+:RING) RING.P ; also sheet 20
SIM-CLK: P-SIM.C3(-CAGE:SIM-SCLK) R603.1 U601.6(IO5) ; also sheet 7
SIM-DATA: P-SIM.C7(-CAGE:SIM-I/O) R602.1 U601.4(IO3) ; also sheet 7
SIM-RST: C612.1 P-SIM.C2(-CAGE:SIM-RST) R601.1 U601.5(IO4) ; also sheet 7
STATUS: M601.B14(POWER:STATUS) STATUS.P ; also sheet 20
UART?-CTS: M601.N10(ACS0:RTS) RTS.P ; also sheet 20
UART?-RTS: CTS.P M601.N8(ACS0:CTS) ; also sheet 20
UART?-RX: M601.P12(ACS0:TX) TX.P ; also sheet 20
UART?-TX: M601.P11(ACS0:RX) RX.P ; also sheet 20
USB-WWAN-D+ [90 Ohm]: D+.P M601.P4(USB:D+) ; also sheet 2,18,20
USB-WWAN-D- [90 Ohm]: D-.P M601.P5(USB:D-) ; also sheet 2,18,20
VBUS-MODEM [Battery]: M601.N5(USB:VBUS) ; also sheet 2,20
VGNSS: M601.K16(POWER:VGNSS) ; also sheet 8
VMODEM1 [Battery]: C605.1 C606.1 C607.1 M601.N3(POWER:BATT+GSM) M601.N4(POWER:BATT+GSM) ; also sheet 4
VMODEM2 [Battery]: C608.1 C609.1 C610.1 M601.A4(POWER:BATT+WCDMA) M601.B3(POWER:BATT+WCDMA) ; also sheet 4
VMODEM3 [Battery]: C602.1 C603.1 C604.1 M601.N13(POWER:BATT+) M601.P13(POWER:BATT+) ; also sheet 4
Unconnected: M601.C14(AUDIO:VMIC) M601.D15(AUDIO:MICP) M601.D16(AUDIO:MICN) M601.E15(AUDIO:EARP) M601.E16(AUDIO:EARN) M601.N6(I2S+:SCLKOUT) M601.N7(I2S+:WSOUT) M601.P6(I2S+:MCLK_OUT) M601.P7(I2S+:DOUT)

### Notes on the sheet
- tbd.
- 3G/4G Modem + SIM
- Can we connect UART in parallel to Bluetooth UART (i.e. if BT is disabled we can unbrick the Modem?)
- V2b
- (c) 2014 Golden Delicious Computers GmbH&Co. KG. Licensed under CC-BY-SA.

## Sheet 7 of 38
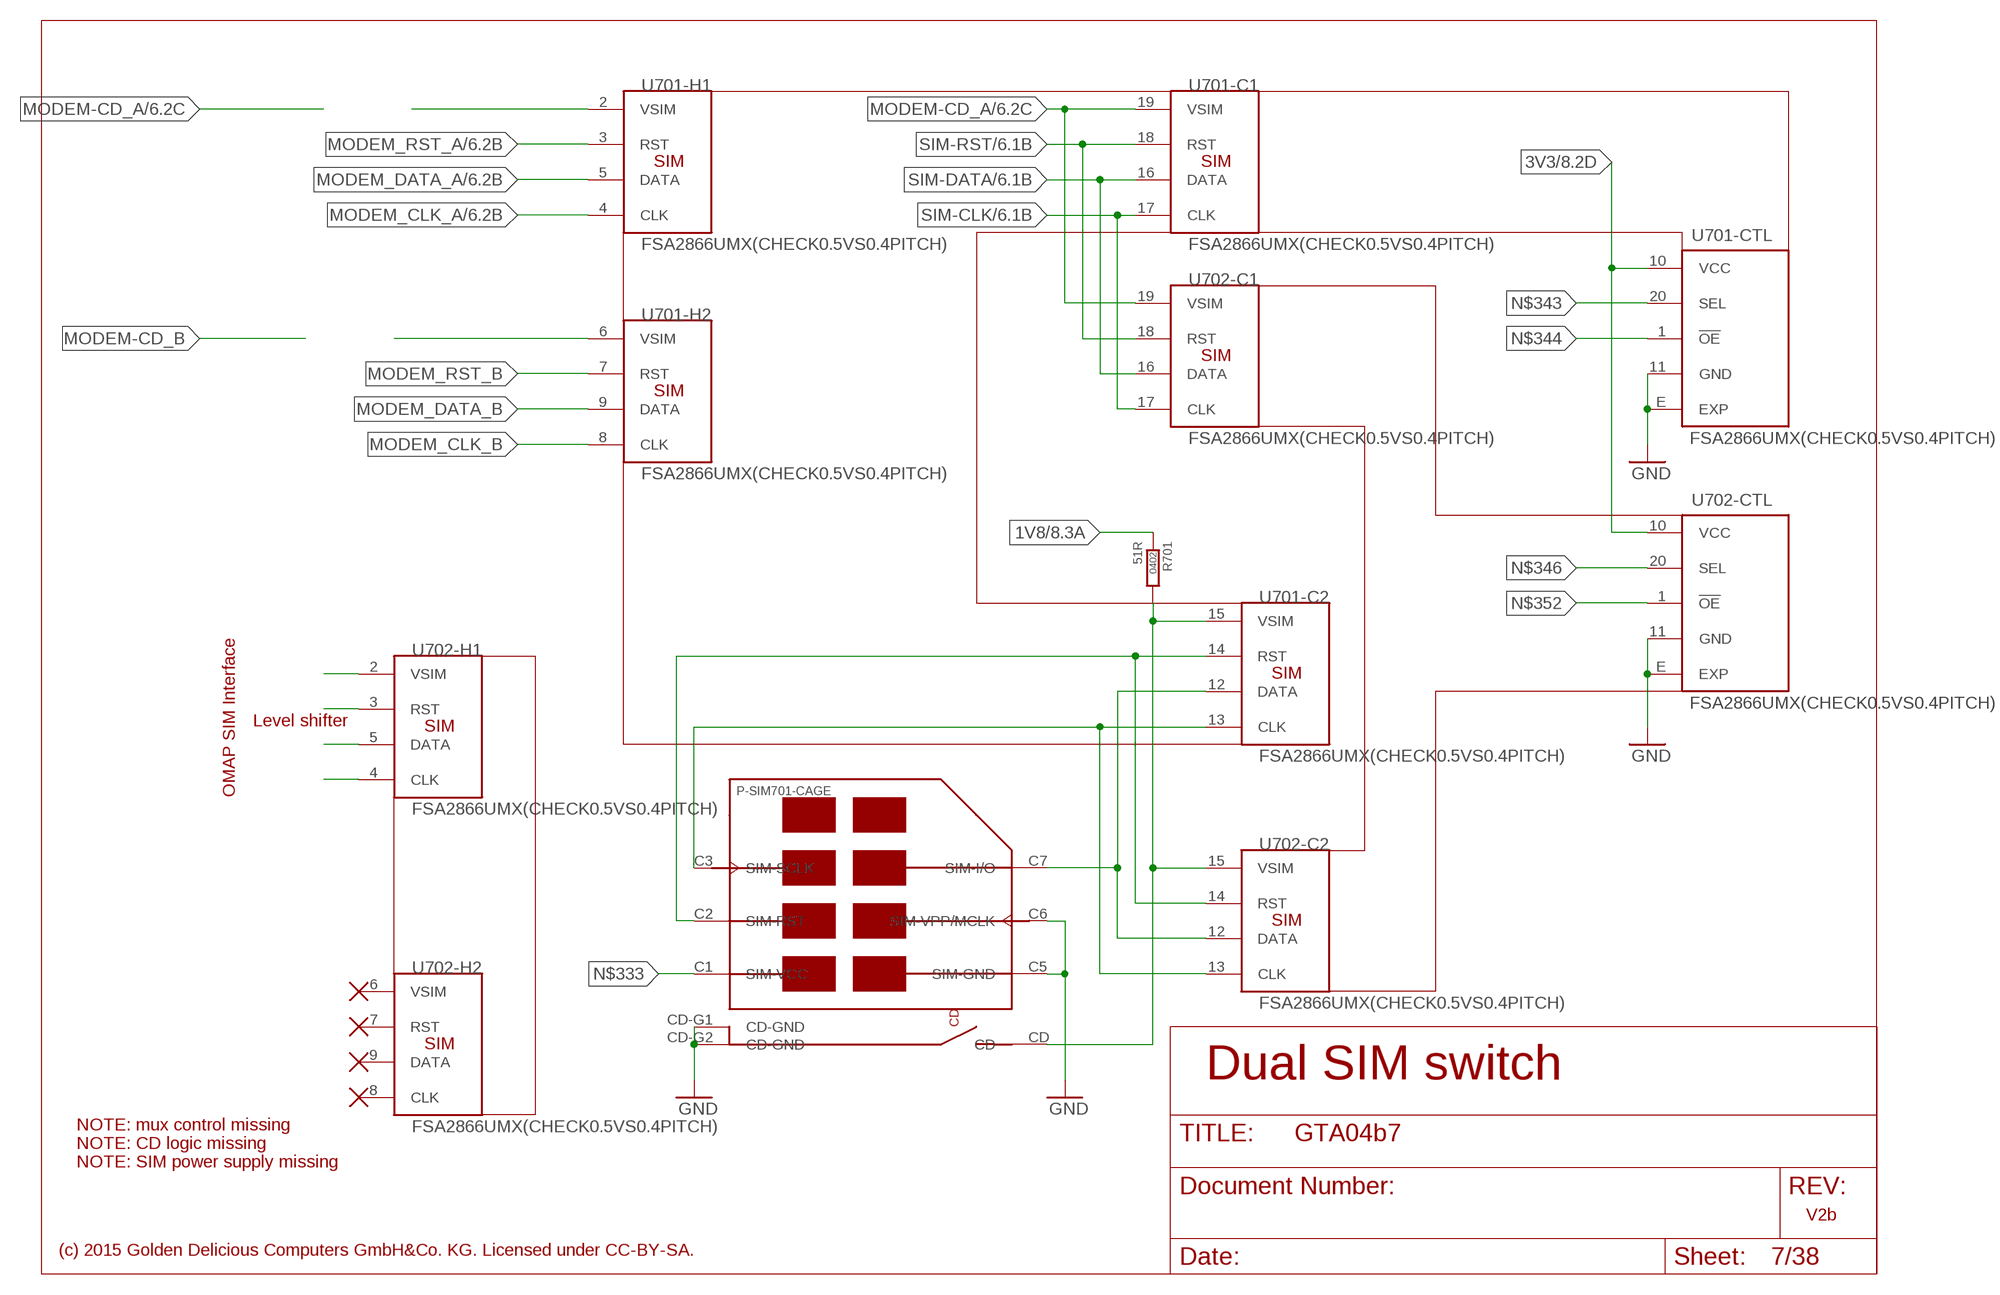
[diagram p6: schematic, sheet 7]

### Parts
P-SIM701  SIM-SLOT-6PIN+CD-CHECK-PINS  SIM-SLOT-6PIN+CD  [SJ106220]
R701  51R  R0402  [SMD-0402]
U701  FSA2866UMX(CHECK0.5VS0.4PITCH)  [S-PWQFN-N20-0.5]
U702  FSA2866UMX(CHECK0.5VS0.4PITCH)  [S-PWQFN-N20-0.5]

### Nets
1V8 [GND]: R701.1 ; also sheet 8,9,10,11,12,13,16,17,19,20
3V3: U701.10(-CTL:VCC) U702.10(-CTL:VCC) ; also sheet 8,9,10,13,15,16,19,20
GND [GND]: P-SIM701.C5(-CAGE:SIM-GND) P-SIM701.C6(-CAGE:SIM-VPP/MCLK) P-SIM701.CD-G1(-CAGE:CD-GND) P-SIM701.CD-G2(-CAGE:CD-GND) U701.11(-CTL:GND) U701.E(-CTL:EXP) U702.11(-CTL:GND) U702.E(-CTL:EXP) ; also sheet 1,2,3,4,5,6,8,9,10,11,12,13,14,15,16,17,18,19,20
MODEM-CD_A: U701.19(-C1:VSIM) U702.19(-C1:VSIM) ; also sheet 6
MODEM_CLK_A: U701.4(-H1:CLK) ; also sheet 6
MODEM_CLK_B: U701.8(-H2:CLK)
MODEM_DATA_A: U701.5(-H1:DATA) ; also sheet 6
MODEM_DATA_B: U701.9(-H2:DATA)
MODEM_RST_A: U701.3(-H1:RST) ; also sheet 6
MODEM_RST_B: U701.7(-H2:RST)
N$20: U702.2(-H1:VSIM)
N$40: U702.3(-H1:RST)
N$53: U702.5(-H1:DATA)
N$65: U702.4(-H1:CLK)
N$137: P-SIM701.C3(-CAGE:SIM-SCLK) U701.13(-C2:CLK) U702.13(-C2:CLK)
N$224: P-SIM701.C2(-CAGE:SIM-RST) U701.14(-C2:RST) U702.14(-C2:RST)
N$333: P-SIM701.C1(-CAGE:SIM-VCC)
N$338: P-SIM701.CD(-CAGE:CD) R701.2 U701.15(-C2:VSIM) U702.15(-C2:VSIM)
N$342: P-SIM701.C7(-CAGE:SIM-I/O) U701.12(-C2:DATA) U702.12(-C2:DATA)
N$343: U701.20(-CTL:SEL)
N$344: U701.1(-CTL:!OE)
N$346: U702.20(-CTL:SEL)
N$352: U702.1(-CTL:!OE)
N$353: U701.2(-H1:VSIM)
N$354: U701.6(-H2:VSIM)
SIM-CLK: U701.17(-C1:CLK) U702.17(-C1:CLK) ; also sheet 6
SIM-DATA: U701.16(-C1:DATA) U702.16(-C1:DATA) ; also sheet 6
SIM-RST: U701.18(-C1:RST) U702.18(-C1:RST) ; also sheet 6
Unconnected: U702.7(-H2:RST) U702.8(-H2:CLK) U702.9(-H2:DATA)

### Notes on the sheet
- Level shifter
- OMAP SIM Interface
- Dual SIM switch
- NOTE: mux control missing
  NOTE: CD logic missing
  NOTE: SIM power supply missing
- V2b
- (c) 2015 Golden Delicious Computers GmbH&Co. KG. Licensed under CC-BY-SA.

## Sheet 8 of 38
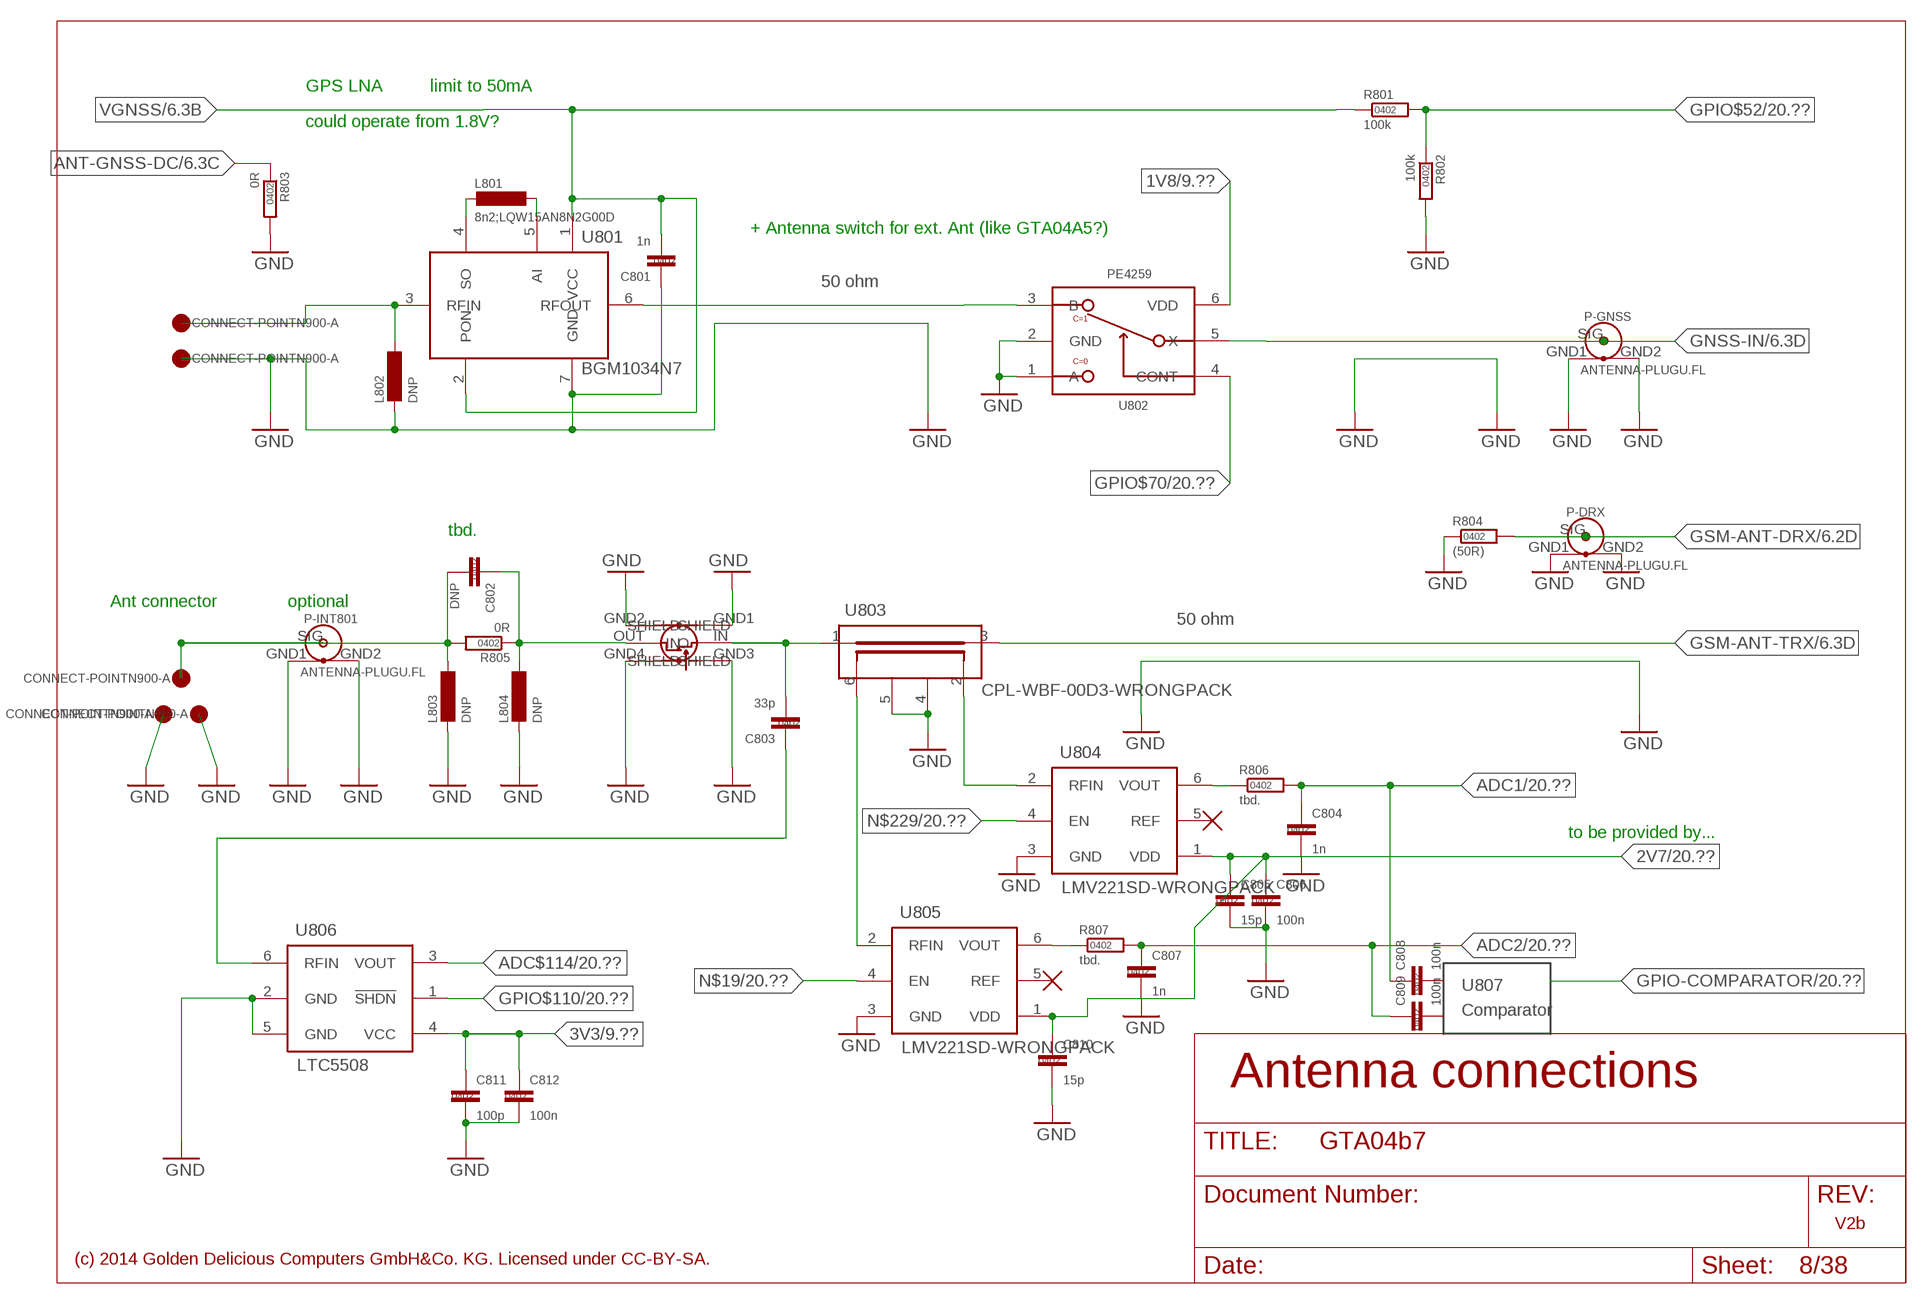
[diagram p7: schematic, sheet 8]

### Parts
C801  1n  C0402  [SMD-0402]
C802  DNP  C0402  [SMD-0402]
C803  33p  C0402  [SMD-0402]
C804  1n  C0402  [SMD-0402]
C805  15p  C0402  [SMD-0402]
C806  100n  C0402  [SMD-0402]
C807  1n  C0402  [SMD-0402]
C808  100n  C0402  [SMD-0402]
C809  100n  C0402  [SMD-0402]
C810  15p  C0402  [SMD-0402]
C811  100p  C0402  [SMD-0402]
C812  100n  C0402  [SMD-0402]
GPS-ANT  CONNECT-POINTN900-A  [N900-SPRING-A]  (not fitted in variant Full)  (not fitted in variant BB-XM)
GPS-GND  CONNECT-POINTN900-A  [N900-SPRING-A]  (not fitted in variant Full)  (not fitted in variant BB-XM)
L801  8n2;LQW15AN8N2G00D  L0402  [SMD-0402]
L802  DNP  L0402  [SMD-0402]  (not fitted in variant Full)  (not fitted in variant BB-XM)
L803  DNP  L0402  [SMD-0402]
L804  DNP  L0402  [SMD-0402]
P-DRX  ANTENNA-PLUGU.FL  PLUG-U.FL  [U.FL-SOCKET-SMT-HIROSE]
P-GNSS  ANTENNA-PLUGU.FL  PLUG-U.FL  [U.FL-SOCKET-SMT-HIROSE]
P-INT801  ANTENNA-PLUGU.FL  PLUG-U.FL  [U.FL-SOCKET-SMT-HIROSE]
P-WWAN  MM8430-2600RA1  [SWD-SOCKETSWITCH-SMT-MURATA]
R801  100k  R0402  [SMD-0402]
R802  100k  R0402  [SMD-0402]
R803  0R  R0402  [SMD-0402]
R804  (50R)  R0402  [SMD-0402]  (not fitted in variant Full)  (not fitted in variant BB-XM)
R805  0R  R0402  [SMD-0402]
R806  tbd.  R0402  [SMD-0402]
R807  tbd.  R0402  [SMD-0402]
U801  BGM1034N7  [TSNP-7-10]
U802  PE4259  PE2459  [SC70-6]
U803  CPL-WBF-00D3-WRONGPACK  [SOT23-6]
U804  LMV221SD-WRONGPACK  [SOT23-6]
U805  LMV221SD-WRONGPACK  [SOT23-6]
U806  LTC5508  LTC5508ESC6  [SC70-6]
U807  Comparator  MECHANICAL  [NONE]
WWAN  CONNECT-POINTN900-A  [N900-SPRING-A]  (not fitted in variant Full)  (not fitted in variant BB-XM)
WWAN-GND801  CONNECT-POINTN900-A  [N900-SPRING-A]  (not fitted in variant Full)  (not fitted in variant BB-XM)
WWAN-GND802  CONNECT-POINTN900-A  [N900-SPRING-A]  (not fitted in variant Full)  (not fitted in variant BB-XM)

### Nets
1V8 [GND]: U802.6(VDD) ; also sheet 7,9,10,11,12,13,16,17,19,20
2V7: C805.1 C806.1 C810.1 U804.1(VDD) U805.1(VDD) ; also sheet 20
3V3: C811.1 C812.1 U806.4(VCC) ; also sheet 7,9,10,13,15,16,19,20
ADC1: C804.1 C808.1 R806.2 ; also sheet 20
ADC2: C807.1 C809.1 R807.2 ; also sheet 20
ADC$114: U806.3(VOUT) ; also sheet 20
ANT-GNSS [50 Ohm]: U801.6(RFOUT) U802.3(B)
ANT-GNSS-DC: R803.1 ; also sheet 6
GND [GND]: C801.1 C804.2 C805.2 C806.2 C807.2 C810.2 C811.2 C812.2 GPS-GND.1 L802.2 L803.2 L804.2 P-DRX.GND1(SHIELD) P-DRX.GND2(SHIELD) P-GNSS.GND1(SHIELD) P-GNSS.GND2(SHIELD) P-INT801.GND1(SHIELD) P-INT801.GND2(SHIELD) P-WWAN.GND1(SHIELD) P-WWAN.GND2(SHIELD) P-WWAN.GND3(SHIELD) P-WWAN.GND4(SHIELD) R802.2 R803.2 R804.1 U801.7(GND) U802.1(A) U802.2(GND) U803.4(GND) U803.5(GND) U804.3(GND) U805.3(GND) U806.2(GND) U806.5(GND) WWAN-GND801.1 WWAN-GND802.1 ; also sheet 1,2,3,4,5,6,7,9,10,11,12,13,14,15,16,17,18,19,20
GNSS-IN [50 Ohm]: P-GNSS.SIG U802.5(X) ; also sheet 6
GPIO$52: R801.2 R802.1 ; also sheet 20
GPIO$70: U802.4(CONT) ; also sheet 20
GPIO$110: U806.1(!SHDN) ; also sheet 20
GSM-ANT-DRX [50 Ohm]: P-DRX.SIG R804.2 ; also sheet 6
GSM-ANT-TRX [50 Ohm]: U803.3(OUT) ; also sheet 6
N$2 [50 Ohm]: GPS-ANT.1 L802.1 U801.3(RFIN)
N$14 [50 Ohm]: C803.2 P-WWAN.IN U803.1(IN)
N$19: U805.4(EN) ; also sheet 20
N$45: U803.6(CPL) U805.2(RFIN)
N$60: C803.1 U806.6(RFIN)
N$99: U803.2(ISO) U804.2(RFIN)
N$179: L801.2 U801.4(SO)
N$229: U804.4(EN) ; also sheet 20
N$240: R807.1 U805.6(VOUT)
N$241: R806.1 U804.6(VOUT)
N$254 [50 Ohm]: C802.2 L803.1 P-INT801.SIG R805.2 WWAN.1
N$255 [50 Ohm]: C802.1 L804.1 P-WWAN.OUT(O) R805.1
N$269: L801.1 U801.5(AI)
VGNSS: C801.2 R801.1 U801.1(VCC) U801.2(PON) ; also sheet 6
Unconnected: C808.2 C809.2 U804.5(REF) U805.5(REF)

### Notes on the sheet
- GPS LNA | limit to 50mA
- could operate from 1.8V?
- + Antenna switch for ext. Ant (like GTA04A5?)
- 50 ohm
- tbd.
- Ant connector | optional
- 50 ohm
- to be provided by...
- Antenna connections
- V2b
- (c) 2014 Golden Delicious Computers GmbH&Co. KG. Licensed under CC-BY-SA.

## Sheet 9 of 38
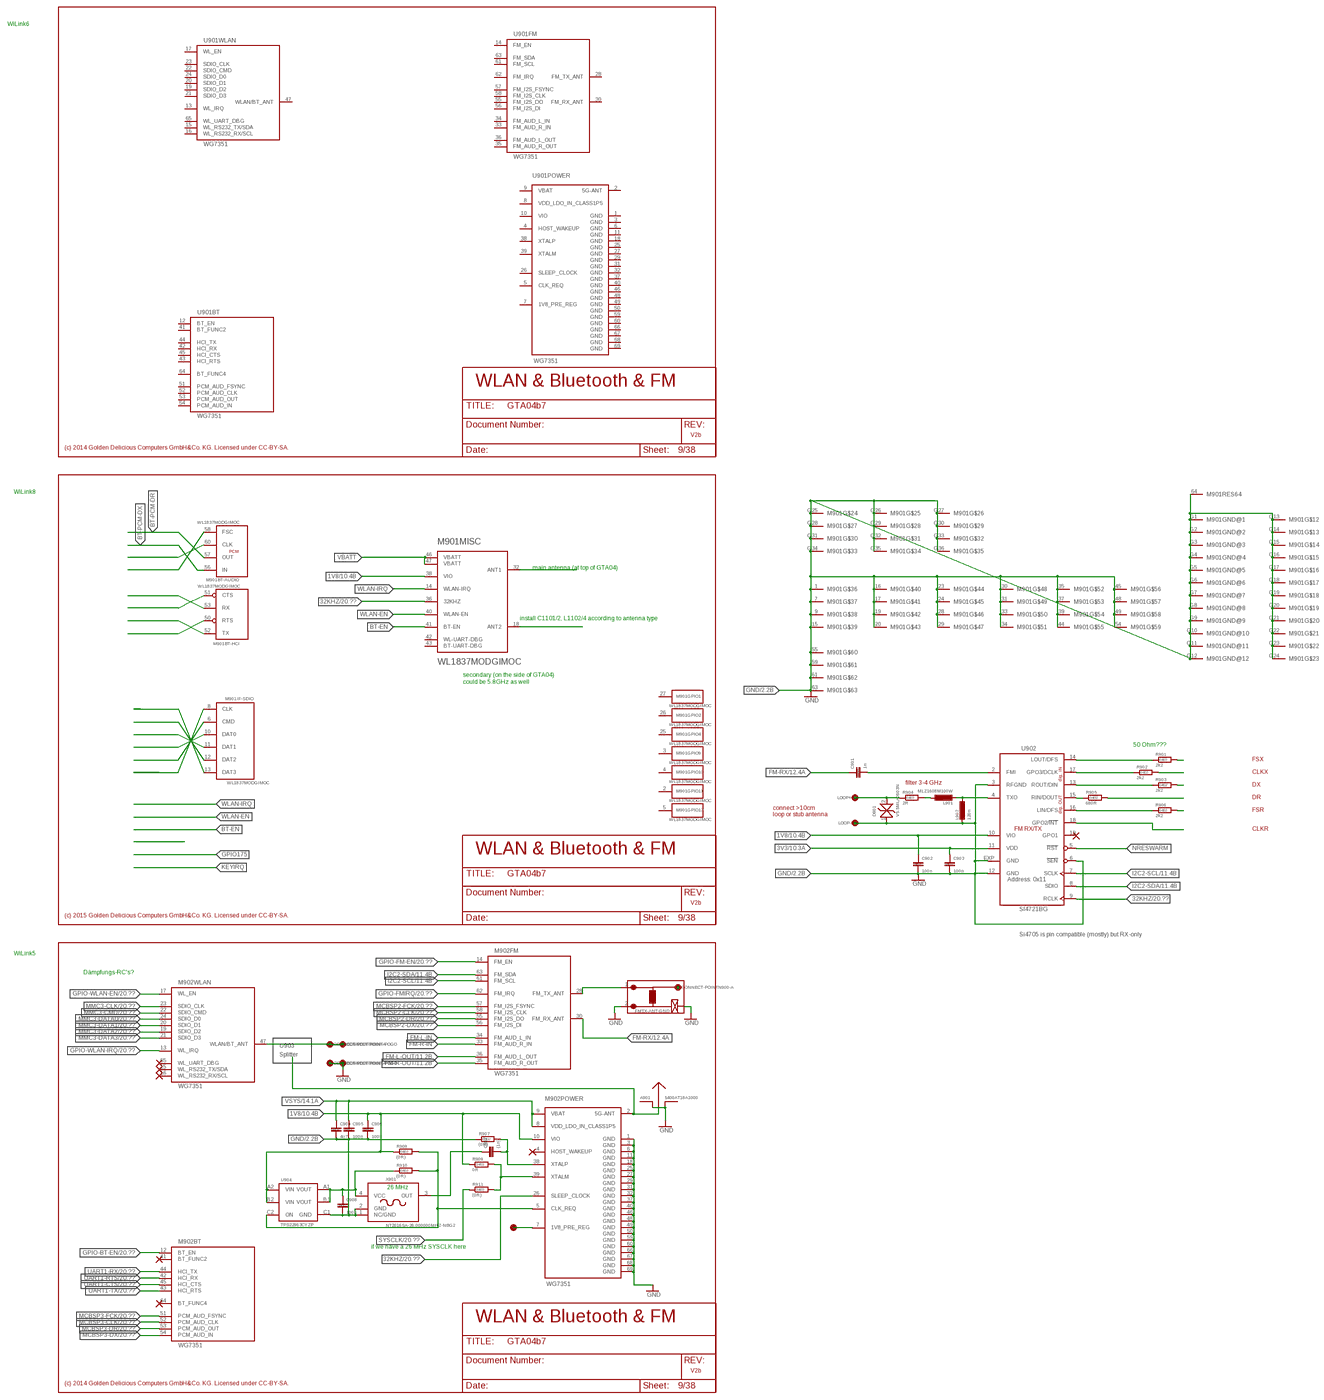
[diagram p8: schematic, sheet 9, overview]
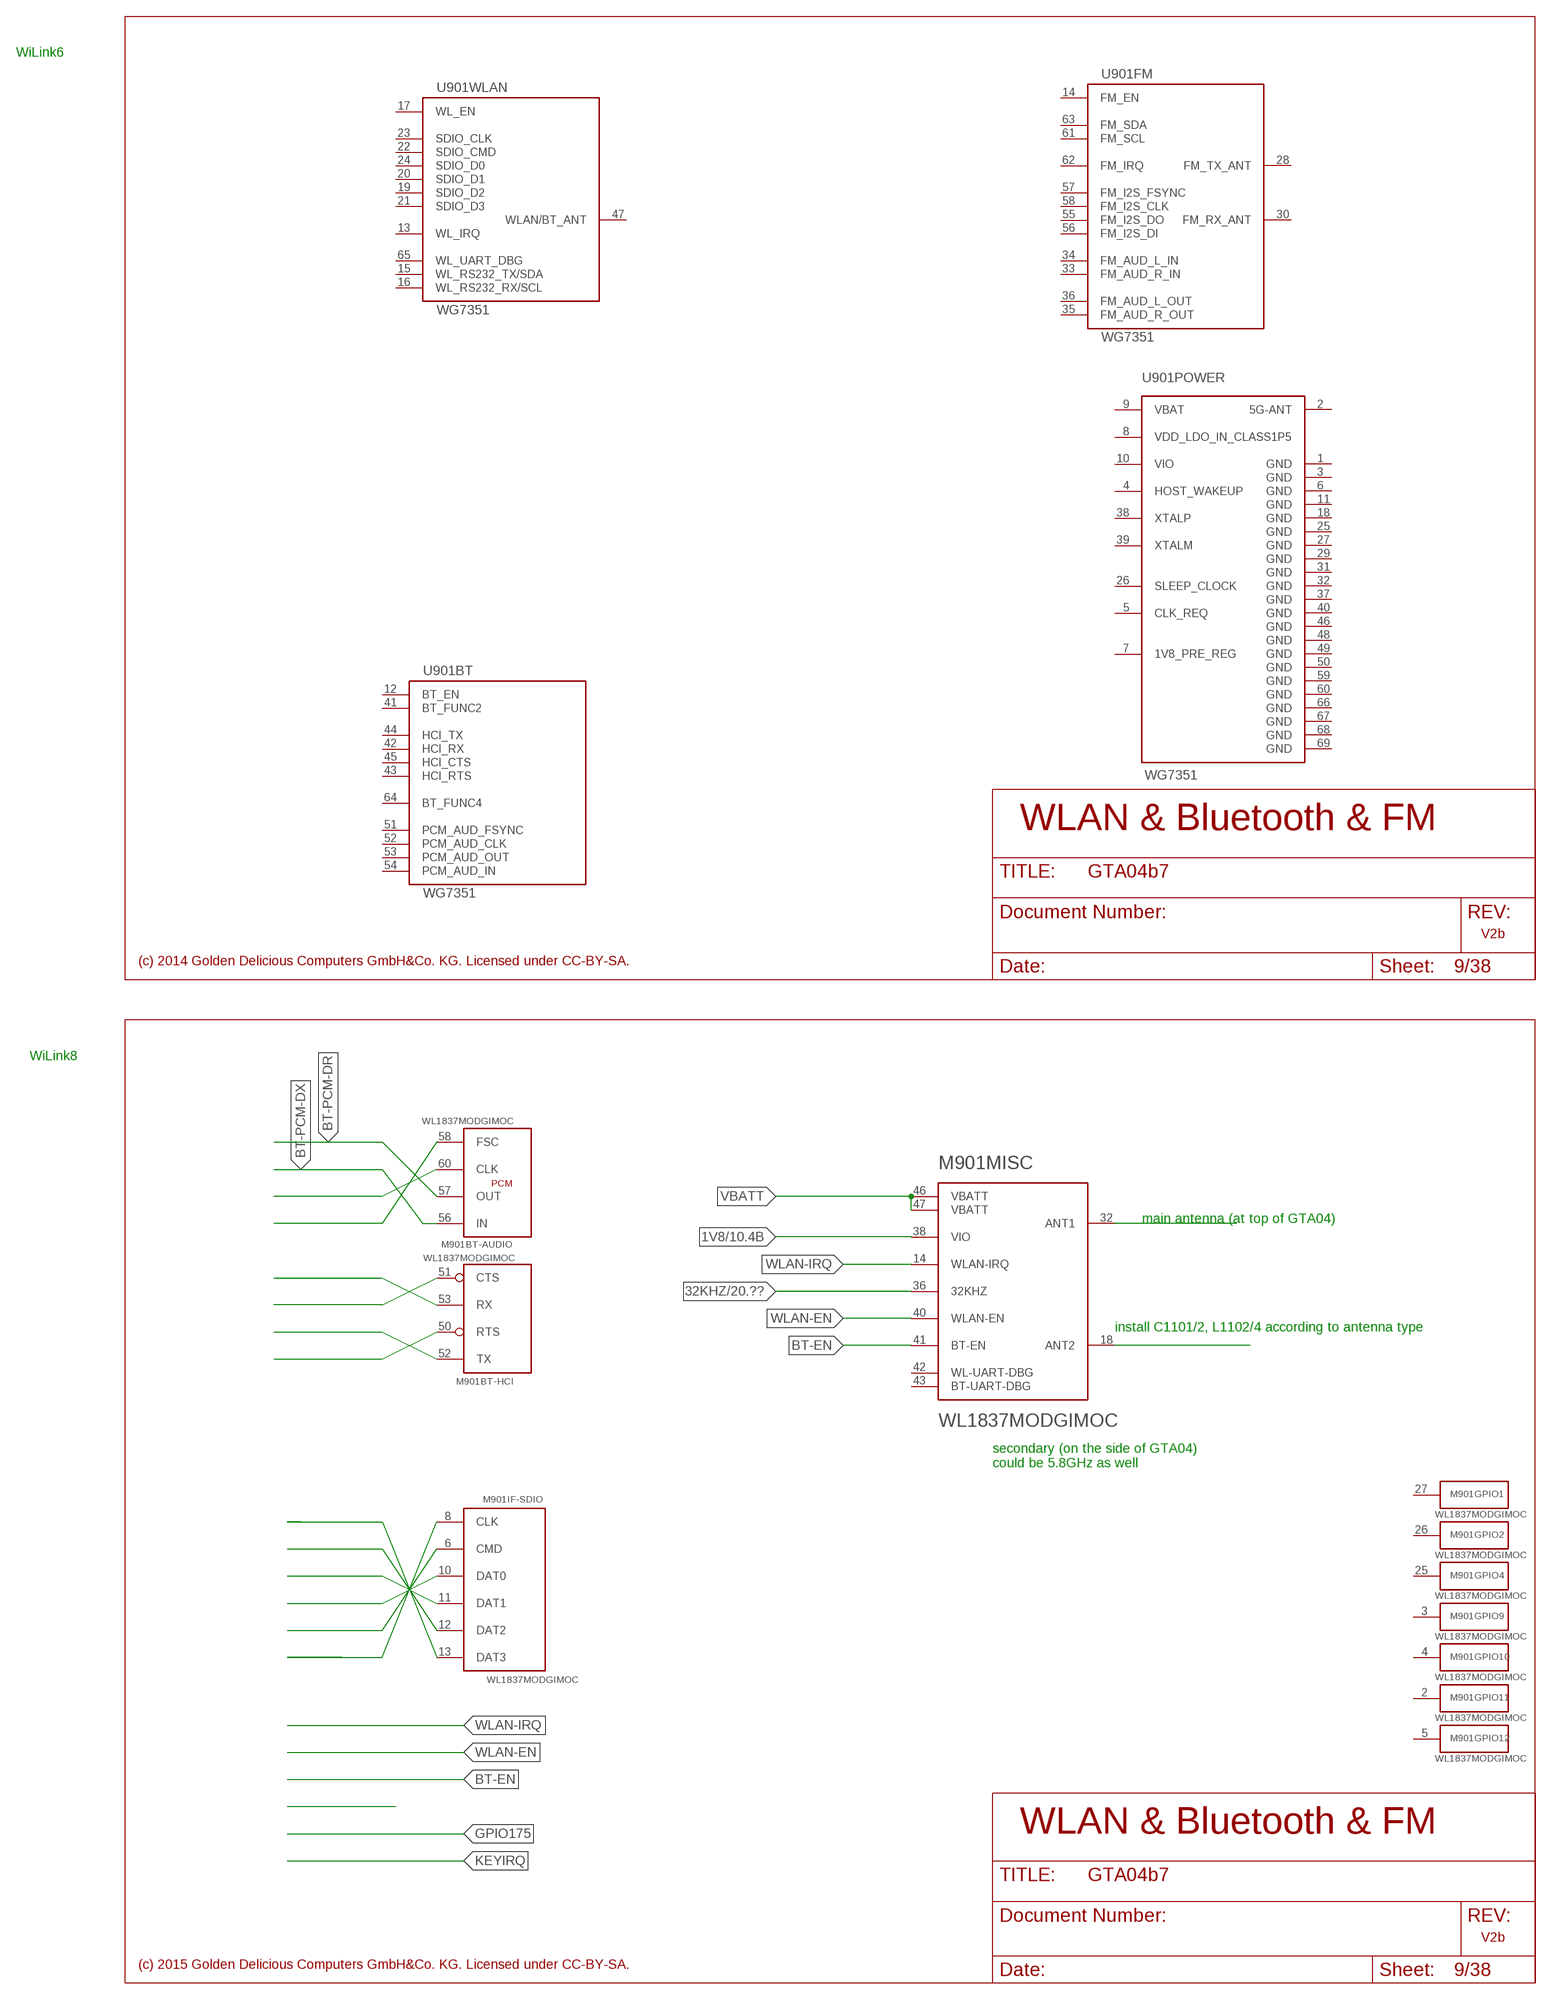
[diagram p9: schematic, sheet 9, part 1 of 4]
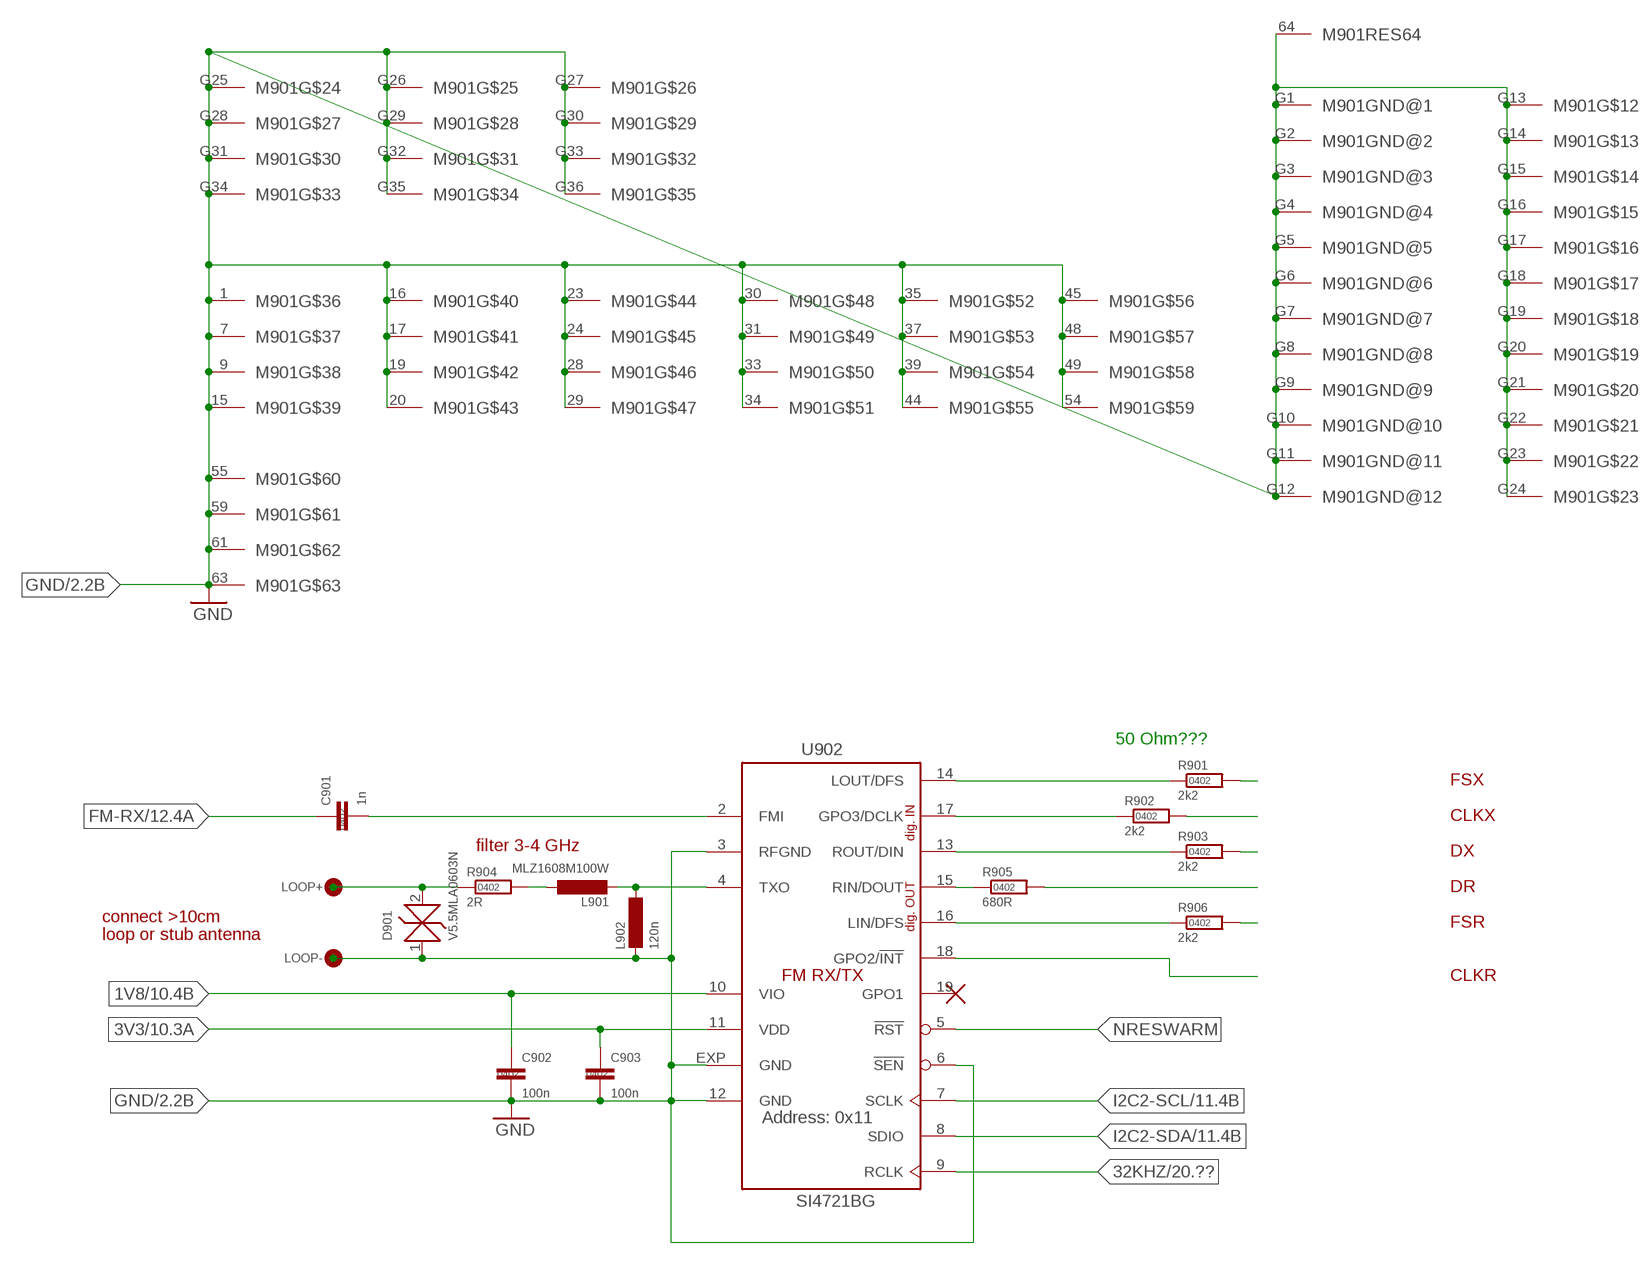
[diagram p10: schematic, sheet 9, part 2 of 4]
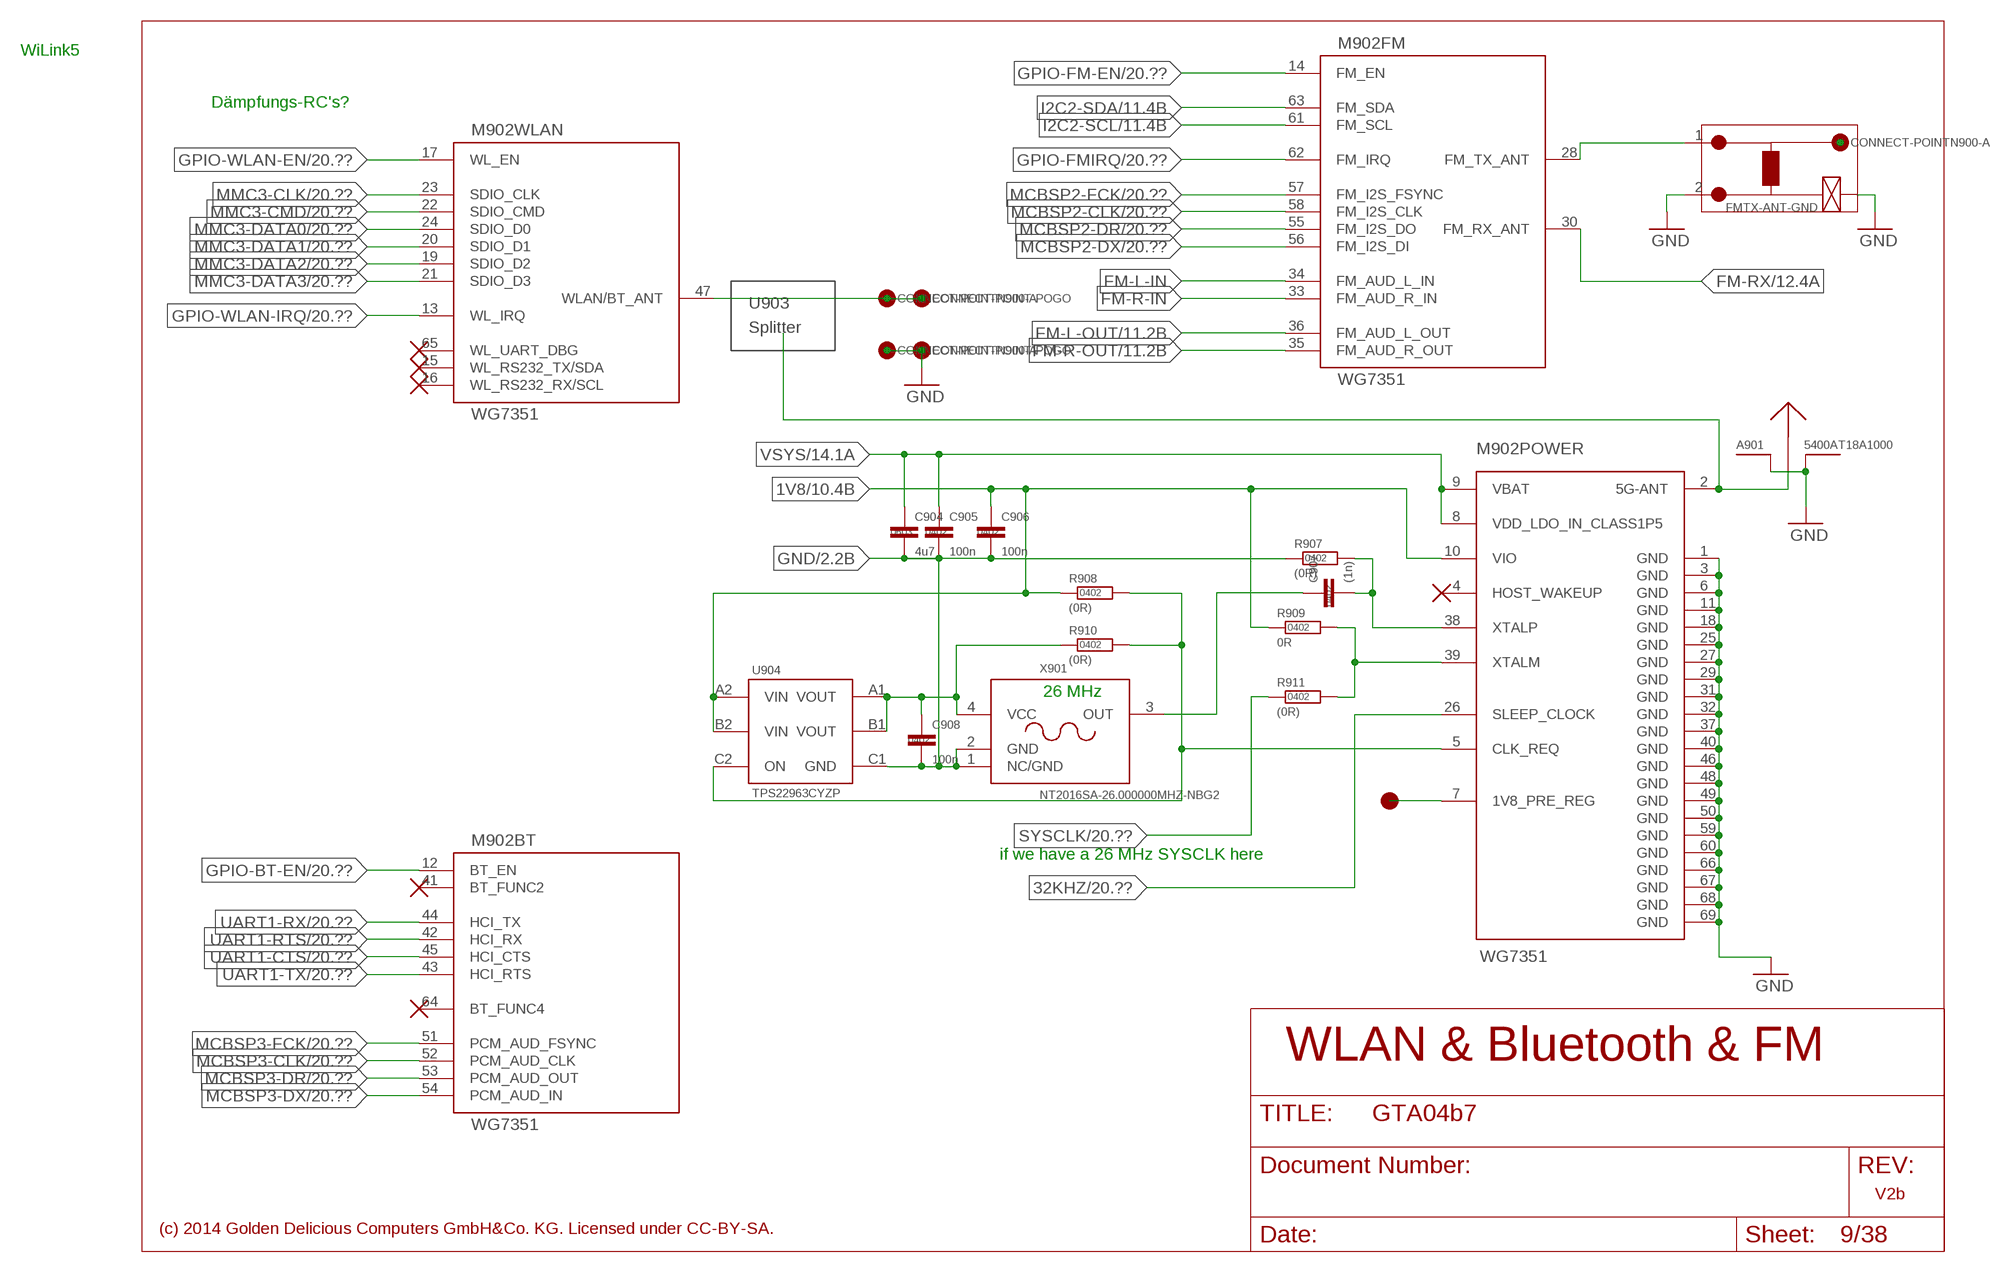
[diagram p11: schematic, sheet 9, part 3 of 4]
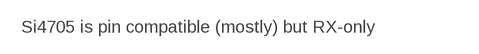
[diagram p12: schematic, sheet 9, part 4 of 4]

### Parts
1V8-OUT  TEST-POINT-0.75  [TP-0.75]  (not fitted in variant Full)  (not fitted in variant BB-XM)
A901  5400AT18A1000  ANTENNA-CERAMIC  [2450AT18A100]
ANT-901  2PIN-SOLDER-2.54MM  [2PIN2.54]  (not fitted in variant Full)  (not fitted in variant BB-XM)
C901  1n  C0402  [SMD-0402]
C902  100n  C0402  [SMD-0402]
C903  100n  C0402  [SMD-0402]
C904  4u7  C0603  [SMD-0603]
C905  100n  C0402  [SMD-0402]
C906  100n  C0402  [SMD-0402]
C907  (1n)  C0402  [SMD-0402]  (not fitted in variant Full)  (not fitted in variant BB-XM)
C908  100n  C0402  [SMD-0402]
D901  V5.5MLA0603N  [SMD-0603]
FMTX-ANT  CONNECT-POINTN900-A  [N900-SPRING-A]
FMTX-ANT-GND  SHIELDPAD-3.5X2.5  [PAD-3.5X2.5]  (not fitted in variant Full)  (not fitted in variant BB-XM)
L901  MLZ1608M100W  L0603  [SMD-0603]
L902  120n  L0402  [SMD-0402]
M901  WL1837MODGIMOC  WL18XXMODGIMOC  [WL18XXMOD]
M902  WG7351  [JORJIN-WG7351]
R901  2k2  R0402  [SMD-0402]
R902  2k2  R0402  [SMD-0402]
R903  2k2  R0402  [SMD-0402]
R904  2R  R0402  [SMD-0402]
R905  680R  R0402  [SMD-0402]
R906  2k2  R0402  [SMD-0402]
R907  (0R)  R0402  [SMD-0402]
R908  (0R)  R0402  [SMD-0402]
R909  0R  R0402  [SMD-0402]
R910  (0R)  R0402  [SMD-0402]  (not fitted in variant Full)  (not fitted in variant BB-XM)
R911  (0R)  R0402  [SMD-0402]  (not fitted in variant Full)  (not fitted in variant BB-XM)
TP1401  LOOP+  TEST-POINT-PIN-0.8  [1PIN-1.5-0.8]
TP1402  LOOP-  TEST-POINT-SQ-0.8  [1PIN-1.5SQ-0.8]
U901  WG7351  [JORJIN-WG7351]
U902  SI4721BG  [QFN-16+4+E-0.5]
U903  Splitter  MECHANICAL  [NONE]
U904  TPS22963CYZP  TPS22964CYZP  [R-XBGA-N6-0.5]
WLAN-ANT  CONNECT-POINT-POGO  [POGO-TH-0965-0-15-20-80-14-11-0]  (not fitted in variant Full)  (not fitted in variant BB-XM)
WLAN-ANT901  CONNECT-POINTN900-A  [N900-SPRING-A]  (not fitted in variant Full)  (not fitted in variant BB-XM)
WLAN-GND  CONNECT-POINT-POGO  [POGO-TH-0965-0-15-20-80-14-11-0]  (not fitted in variant Full)  (not fitted in variant BB-XM)
WLAN-GND901  CONNECT-POINTN900-A  [N900-SPRING-A]  (not fitted in variant Full)  (not fitted in variant BB-XM)
X901  NT2016SA-26.000000MHZ-NBG2  TCXO-2016  [XO-2016]

### Nets
1V8 [GND]: C902.1 C906.1 M901.38(MISC:VIO) M902.10(POWER:VIO) R908.1 R909.1 U902.10(VIO) U904.A2(VIN) U904.B2(VIN) ; also sheet 7,8,10,11,12,13,16,17,19,20
3V3: C903.1 U902.11(VDD) ; also sheet 7,8,10,13,15,16,19,20
32KHZ: M901.36(MISC:32KHZ) M902.26(POWER:SLEEP_CLOCK) U902.9(RCLK) ; also sheet 20
ANT2 [50 Ohm]: M901.18(MISC:ANT2)
BT-EN: M901.41(MISC:BT-EN)
BT-PCM-DR: M901.57(BT-AUDIO:OUT)
BT-PCM-DX: M901.56(BT-AUDIO:IN)
FM-L-IN: M902.34(FM:FM_AUD_L_IN)
FM-L-OUT: M902.36(FM:FM_AUD_L_OUT) ; also sheet 11
FM-R-IN: M902.33(FM:FM_AUD_R_IN)
FM-R-OUT: M902.35(FM:FM_AUD_R_OUT) ; also sheet 11
FM-RX [50 Ohm]: C901.1 M902.30(FM:FM_RX_ANT) ; also sheet 12
GND [GND]: A901.GND1(GND) A901.GND2(GND) ANT-901.2 C902.2 C903.2 C904.2 C905.2 C906.2 C908.2 D901.1(A) FMTX-ANT-GND.1(SHIELD) L902.2 M901.1(PIN) M901.7(PIN) M901.9(PIN) M901.15(PIN) M901.16(PIN) M901.17(PIN) M901.19(PIN) M901.20(PIN) M901.23(PIN) M901.24(PIN) M901.28(PIN) M901.29(PIN) M901.30(PIN) M901.31(PIN) M901.33(PIN) M901.34(PIN) M901.35(PIN) M901.37(PIN) M901.39(PIN) M901.44(PIN) M901.45(PIN) M901.48(PIN) M901.49(PIN) M901.54(PIN) M901.55(PIN) M901.59(PIN) M901.61(PIN) M901.63(PIN) M901.64(RES64:PIN) M901.G1(GND@1:PIN) M901.G2(GND@2:PIN) M901.G3(GND@3:PIN) M901.G4(GND@4:PIN) M901.G5(GND@5:PIN) M901.G6(GND@6:PIN) M901.G7(GND@7:PIN) M901.G8(GND@8:PIN) M901.G9(GND@9:PIN) M901.G10(GND@10:PIN) M901.G11(GND@11:PIN) M901.G12(GND@12:PIN) M901.G13(PIN) M901.G14(PIN) M901.G15(PIN) M901.G16(PIN) M901.G17(PIN) M901.G18(PIN) M901.G19(PIN) M901.G20(PIN) M901.G21(PIN) M901.G22(PIN) M901.G23(PIN) M901.G24(PIN) M901.G25(PIN) M901.G26(PIN) M901.G27(PIN) M901.G28(PIN) M901.G29(PIN) M901.G30(PIN) M901.G31(PIN) M901.G32(PIN) M901.G33(PIN) M901.G34(PIN) M901.G35(PIN) M901.G36(PIN) M902.1(POWER:GND) M902.3(POWER:GND) M902.6(POWER:GND) M902.11(POWER:GND) M902.18(POWER:GND) M902.25(POWER:GND) M902.27(POWER:GND) M902.29(POWER:GND) M902.31(POWER:GND) M902.32(POWER:GND) M902.37(POWER:GND) M902.40(POWER:GND) M902.46(POWER:GND) M902.48(POWER:GND) M902.49(POWER:GND) M902.50(POWER:GND) M902.59(POWER:GND) M902.60(POWER:GND) M902.66(POWER:GND) M902.67(POWER:GND) M902.68(POWER:GND) M902.69(POWER:GND) R907.1 TP1402.1 U902.3(RFGND) U902.6(!SEN) U902.12(GND) U902.EXP(GND) U904.C1(GND) WLAN-GND901.1 WLAN-GND.1 X901.1(NC/GND) X901.2(GND) ; also sheet 1,2,3,4,5,6,7,8,10,11,12,13,14,15,16,17,18,19,20
GPIO-BT-EN: M902.12(BT:BT_EN) ; also sheet 20
GPIO-FM-EN: M902.14(FM:FM_EN) ; also sheet 20
GPIO-FMIRQ: M902.62(FM:FM_IRQ) ; also sheet 20
GPIO-WLAN-EN: M902.17(WLAN:WL_EN) ; also sheet 20
GPIO-WLAN-IRQ: M902.13(WLAN:WL_IRQ) ; also sheet 20
I2C2-SCL: M902.61(FM:FM_SCL) U902.7(SCLK) ; also sheet 4,5,11,12,15,20
I2C2-SDA: M902.63(FM:FM_SDA) U902.8(SDIO) ; also sheet 4,5,11,12,15,20
LOOP [FM Antenna]: D901.2(K) R904.1 TP1401.1
MCBSP2-CLK: M902.58(FM:FM_I2S_CLK) ; also sheet 20
MCBSP2-DR: M902.55(FM:FM_I2S_DO) ; also sheet 20
MCBSP2-DX: M902.56(FM:FM_I2S_DI) ; also sheet 20
MCBSP2-FCK: M902.57(FM:FM_I2S_FSYNC) ; also sheet 20
MCBSP3-CLK: M902.52(BT:PCM_AUD_CLK) ; also sheet 20
MCBSP3-DR: M902.53(BT:PCM_AUD_OUT) ; also sheet 20
MCBSP3-DX: M902.54(BT:PCM_AUD_IN) ; also sheet 20
MCBSP3-FCK: M902.51(BT:PCM_AUD_FSYNC) ; also sheet 20
MMC3-CLK: M902.23(WLAN:SDIO_CLK) ; also sheet 20
MMC3-CMD: M902.22(WLAN:SDIO_CMD) ; also sheet 20
MMC3-DATA0: M902.24(WLAN:SDIO_D0) ; also sheet 20
MMC3-DATA1: M902.20(WLAN:SDIO_D1) ; also sheet 20
MMC3-DATA2: M902.19(WLAN:SDIO_D2) ; also sheet 20
MMC3-DATA3: M902.21(WLAN:SDIO_D3) ; also sheet 20
N$3 [50 Ohm]: M902.47(WLAN:WLAN/BT_ANT) WLAN-ANT901.1 WLAN-ANT.1
N$6: FMTX-ANT.1
N$7: R906.1 U902.16(LIN/DFS)
N$9 [50 Ohm]: M901.32(MISC:ANT1)
N$11 [50 Ohm]: A901.ANT(SIG) M902.2(POWER:5G-ANT)
N$13: M901.53(BT-HCI:RX)
N$15: M901.51(BT-HCI:CTS)
N$22 [50 Ohm]: ANT-901.1 M902.28(FM:FM_TX_ANT)
N$36: M901.52(BT-HCI:TX)
N$57: M901.50(BT-HCI:RTS)
N$59: M901.12(IF-SDIO:DAT2)
N$61: M901.13(IF-SDIO:DAT3)
N$62: M901.11(IF-SDIO:DAT1)
N$63: M901.10(IF-SDIO:DAT0)
N$82: M901.6(IF-SDIO:CMD)
N$97: M901.8(IF-SDIO:CLK)
N$111: R905.1 U902.15(RIN/DOUT)
N$112: R901.1 U902.14(LOUT/DFS)
N$133: R903.1 U902.13(ROUT/DIN)
N$202: 1V8-OUT.P M902.7(POWER:1V8_PRE_REG)
N$221: R902.1 U902.17(GPO3/DCLK)
N$248: R901.2
N$249: R905.2
N$309: R903.2
N$310: R902.2
N$311: R906.2
N$312: M901.60(BT-AUDIO:CLK)
N$313 [FM Antenna]: L901.2 L902.1 U902.4(TXO)
N$314 [FM Antenna]: L901.1 R904.2
N$315: U902.18(GPO2/!INT)
N$319: M901.58(BT-AUDIO:FSC)
N$380: C901.2 U902.2(FMI)
N$392: M902.5(POWER:CLK_REQ) R908.2 R910.2 U904.C2(ON)
N$393: C907.2 M902.38(POWER:XTALP) R907.2
N$394: M902.39(POWER:XTALM) R909.2 R911.2
N$395: C907.1 X901.3(OUT)
N$397: C908.1 R910.1 U904.A1(VOUT) U904.B1(VOUT) X901.4(VCC)
NRESWARM: U902.5(!RST)
SYSCLK: R911.1 ; also sheet 20
UART1-CTS: M902.45(BT:HCI_CTS) ; also sheet 20
UART1-RTS: M902.42(BT:HCI_RX) ; also sheet 20
UART1-RX: M902.44(BT:HCI_TX) ; also sheet 20
UART1-TX: M902.43(BT:HCI_RTS) ; also sheet 20
VBATT [Battery]: M901.46(MISC:VBATT) M901.47(MISC:VBATT)
VSYS [GND]: C904.1 C905.1 M902.8(POWER:VDD_LDO_IN_CLASS1P5) M902.9(POWER:VBAT) ; also sheet 3,4,14,15,18,19,20
WLAN-EN: M901.40(MISC:WLAN-EN)
WLAN-IRQ: M901.14(MISC:WLAN-IRQ)
Unconnected: M901.2(GPIO11:GPIO) M901.3(GPIO9:GPIO) M901.4(GPIO10:GPIO) M901.5(GPIO12:GPIO) M901.21(RES21:PIN) M901.22(RES22:PIN) M901.25(GPIO4:GPIO) M901.26(GPIO2:GPIO) M901.27(GPIO1:GPIO) M901.42(MISC:WL-UART-DBG) M901.43(MISC:BT-UART-DBG) M901.62(RES62:PIN) M902.4(POWER:HOST_WAKEUP) M902.15(WLAN:WL_RS232_TX/SDA) M902.16(WLAN:WL_RS232_RX/SCL) M902.41(BT:BT_FUNC2) M902.64(BT:BT_FUNC4) M902.65(WLAN:WL_UART_DBG) U901.2(POWER:5G-ANT) U901.4(POWER:HOST_WAKEUP) U901.5(POWER:CLK_REQ) U901.7(POWER:1V8_PRE_REG) U901.12(BT:BT_EN) U901.13(WLAN:WL_IRQ) U901.14(FM:FM_EN) U901.15(WLAN:WL_RS232_TX/SDA) U901.16(WLAN:WL_RS232_RX/SCL) U901.17(WLAN:WL_EN) U901.19(WLAN:SDIO_D2) U901.20(WLAN:SDIO_D1) U901.21(WLAN:SDIO_D3) U901.22(WLAN:SDIO_CMD) U901.23(WLAN:SDIO_CLK) U901.24(WLAN:SDIO_D0) U901.26(POWER:SLEEP_CLOCK) U901.28(FM:FM_TX_ANT) U901.30(FM:FM_RX_ANT) U901.33(FM:FM_AUD_R_IN) U901.34(FM:FM_AUD_L_IN) U901.35(FM:FM_AUD_R_OUT) U901.36(FM:FM_AUD_L_OUT) U901.38(POWER:XTALP) U901.39(POWER:XTALM) U901.41(BT:BT_FUNC2) U901.42(BT:HCI_RX) U901.43(BT:HCI_RTS) U901.44(BT:HCI_TX) U901.45(BT:HCI_CTS) U901.47(WLAN:WLAN/BT_ANT) U901.51(BT:PCM_AUD_FSYNC) U901.52(BT:PCM_AUD_CLK) U901.53(BT:PCM_AUD_OUT) U901.54(BT:PCM_AUD_IN) U901.55(FM:FM_I2S_DO) U901.56(FM:FM_I2S_DI) U901.57(FM:FM_I2S_FSYNC) U901.58(FM:FM_I2S_CLK) U901.61(FM:FM_SCL) U901.62(FM:FM_IRQ) U901.63(FM:FM_SDA) U901.64(BT:BT_FUNC4) U901.65(WLAN:WL_UART_DBG) U902.19(GPO1)

### Notes on the sheet
- WiLink6
- WLAN & Bluetooth & FM
- V2b
- (c) 2014 Golden Delicious Computers GmbH&Co. KG. Licensed under CC-BY-SA.
- WiLink8
- main antenna (at top of GTA04)
- install C1101/2, L1102/4 according to antenna type
- secondary (on the side of GTA04)
  could be 5.8GHz as well
- 50 Ohm???
- FSX
- CLKX
- filter 3-4 GHz
- DX
- DR
- connect >10cm
- FSR
- loop or stub antenna
- CLKR
- WLAN & Bluetooth & FM
- Address: 0x11
- V2b
- (c) 2015 Golden Delicious Computers GmbH&Co. KG. Licensed under CC-BY-SA.
- Si4705 is pin compatible (mostly) but RX-only
- WiLink5
- Dämpfungs-RC's?
- 26 MHz
- if we have a 26 MHz SYSCLK here
- WLAN & Bluetooth & FM
- V2b
- (c) 2014 Golden Delicious Computers GmbH&Co. KG. Licensed under CC-BY-SA.

## Sheet 10 of 38
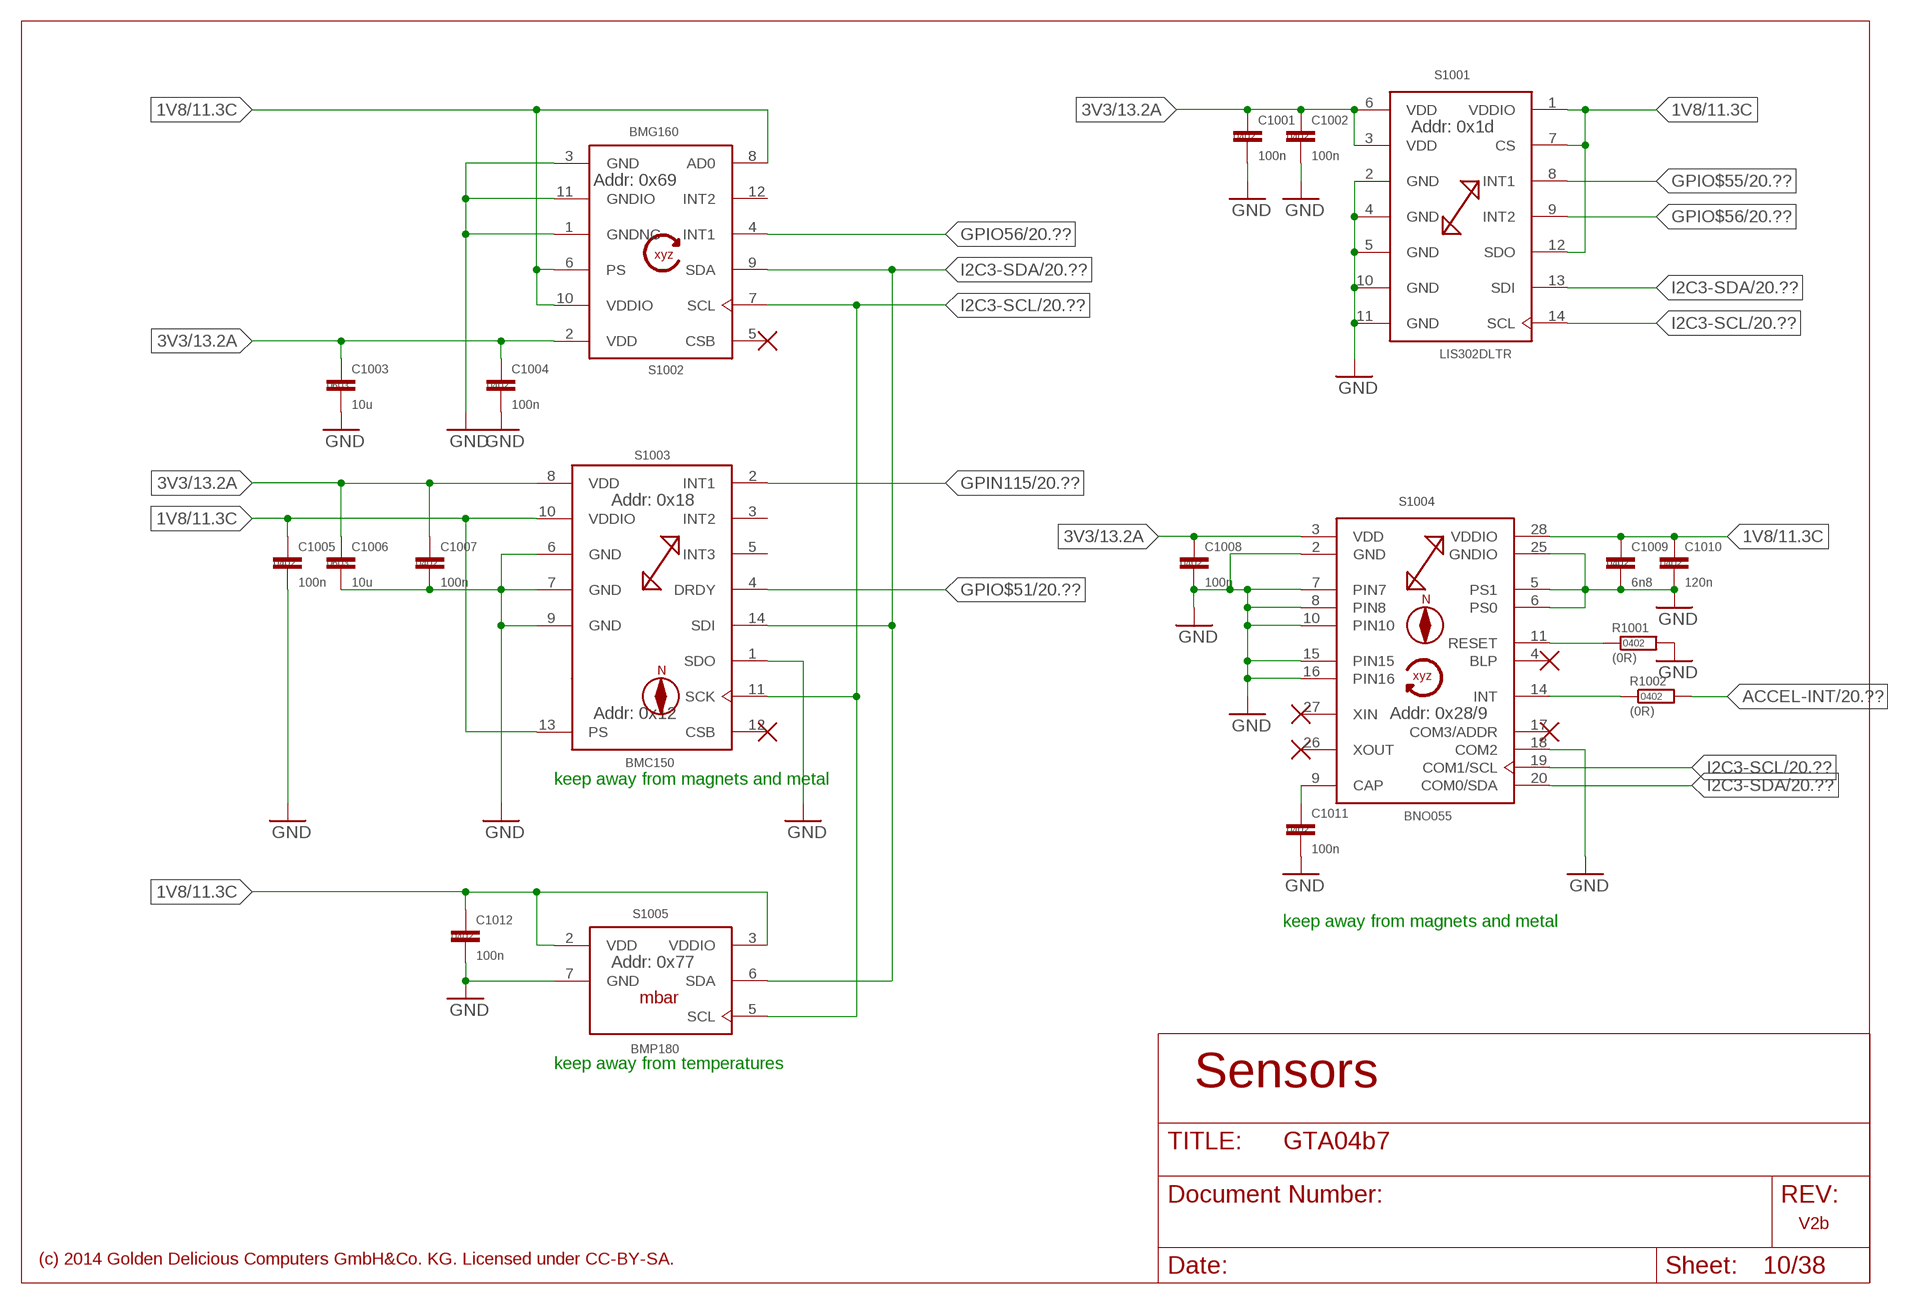
[diagram p13: schematic, sheet 10]

### Parts
C1001  100n  C0402  [SMD-0402]
C1002  100n  C0402  [SMD-0402]
C1003  10u  C0603  [SMD-0603]
C1004  100n  C0402  [SMD-0402]
C1005  100n  C0402  [SMD-0402]
C1006  10u  C0603  [SMD-0603]
C1007  100n  C0402  [SMD-0402]
C1008  100n  C0402  [SMD-0402]
C1009  6n8  C0402  [SMD-0402]
C1010  120n  C0402  [SMD-0402]
C1011  100n  C0402  [SMD-0402]
C1012  100n  C0402  [SMD-0402]
R1001  (0R)  R0402  [SMD-0402]  (not fitted in variant Full)  (not fitted in variant BB-XM)
R1002  (0R)  R0402  [SMD-0402]  (not fitted in variant Full)  (not fitted in variant BB-XM)
S1001  LIS302DLTR  [LGA-DIL-12+2]
S1002  BMG160  [BMG160]
S1003  BMC150  [BMC150]
S1004  BNO055  [BNO050]
S1005  BMP180  [BMP180]

### Nets
1V8 [GND]: C1005.1 C1009.1 C1010.1 C1012.1 S1001.1(VDDIO) S1001.7(CS) S1001.12(SDO) S1002.6(PS) S1002.8(AD0) S1002.10(VDDIO) S1003.10(VDDIO) S1003.13(PS) S1004.28(VDDIO) S1005.2(VDD) S1005.3(VDDIO) ; also sheet 7,8,9,11,12,13,16,17,19,20
3V3: C1001.1 C1002.1 C1003.1 C1004.1 C1006.1 C1007.1 C1008.1 S1001.3(VDD) S1001.6(VDD) S1002.2(VDD) S1003.8(VDD) S1004.3(VDD) ; also sheet 7,8,9,13,15,16,19,20
ACCEL-INT: R1002.2 ; also sheet 20
GND [GND]: C1001.2 C1002.2 C1003.2 C1004.2 C1005.2 C1006.2 C1007.2 C1008.2 C1009.2 C1010.2 C1011.2 C1012.2 R1001.2 S1001.2(GND) S1001.4(GND) S1001.5(GND) S1001.10(GND) S1001.11(GND) S1002.1(GNDNC) S1002.3(GND) S1002.11(GNDIO) S1003.1(SDO) S1003.6(GND) S1003.7(GND) S1003.9(GND) S1004.2(GND) S1004.5(PS1) S1004.6(PS0) S1004.7(PIN7) S1004.8(PIN8) S1004.10(PIN10) S1004.15(PIN15) S1004.16(PIN16) S1004.18(COM2) S1004.25(GNDIO) S1005.7(GND) ; also sheet 1,2,3,4,5,6,7,8,9,11,12,13,14,15,16,17,18,19,20
GPIN115: S1003.2(INT1) ; also sheet 20
GPIO56: S1002.4(INT1) ; also sheet 20
GPIO$51: S1003.4(DRDY) ; also sheet 20
GPIO$55: S1001.8(INT1) ; also sheet 20
GPIO$56: S1001.9(INT2) ; also sheet 20
I2C3-SCL: S1001.14(SCL) S1002.7(SCL) S1003.11(SCK) S1004.19(COM1/SCL) S1005.5(SCL) ; also sheet 3,5,20
I2C3-SDA: S1001.13(SDI) S1002.9(SDA) S1003.14(SDI) S1004.20(COM0/SDA) S1005.6(SDA) ; also sheet 3,5,20
N$8: C1011.1 S1004.9(CAP)
N$300: R1001.1 S1004.11(RESET)
N$305: R1002.1 S1004.14(INT)
Unconnected: S1002.5(CSB) S1002.12(INT2) S1003.3(INT2) S1003.5(INT3) S1003.12(CSB) S1004.4(BLP) S1004.17(COM3/ADDR) S1004.26(XOUT) S1004.27(XIN)

### Notes on the sheet
- Addr: 0x1d
- Addr: 0x69
- Addr: 0x18
- Addr: 0x12 | Addr: 0x28/9
- keep away from magnets and metal
- keep away from magnets and metal
- Addr: 0x77
- keep away from temperatures
- Sensors
- V2b
- (c) 2014 Golden Delicious Computers GmbH&Co. KG. Licensed under CC-BY-SA.

## Sheet 11 of 38
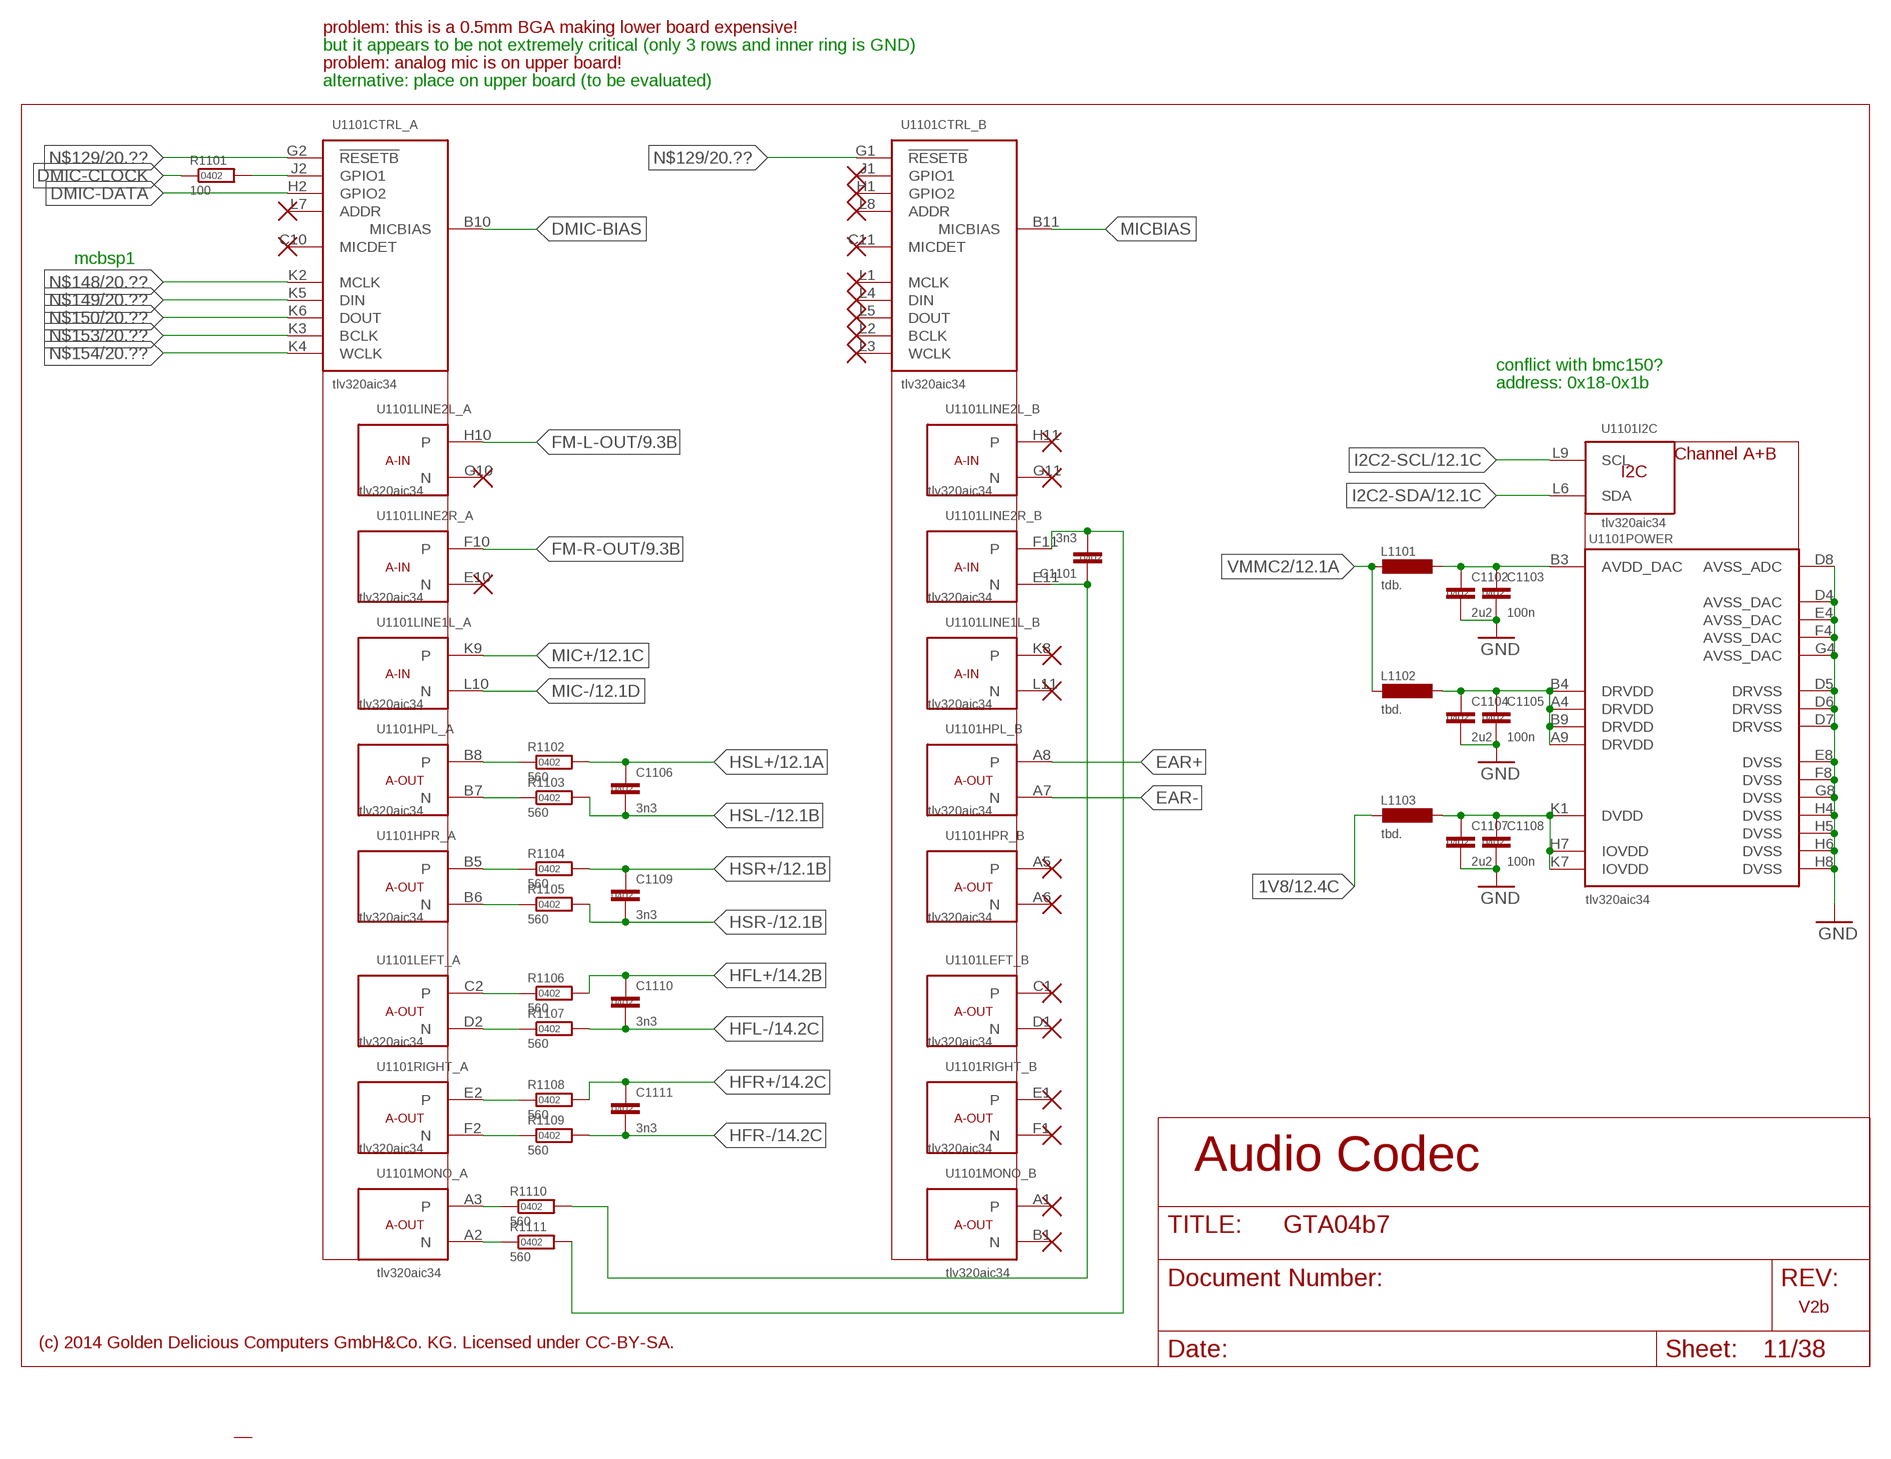
[diagram p14: schematic, sheet 11]

### Parts
C1101  3n3  C0402  [SMD-0402]
C1102  2u2  C0402  [SMD-0402]
C1103  100n  C0402  [SMD-0402]
C1104  2u2  C0402  [SMD-0402]
C1105  100n  C0402  [SMD-0402]
C1106  3n3  C0402  [SMD-0402]
C1107  2u2  C0402  [SMD-0402]
C1108  100n  C0402  [SMD-0402]
C1109  3n3  C0402  [SMD-0402]
C1110  3n3  C0402  [SMD-0402]
C1111  3n3  C0402  [SMD-0402]
L1101  tdb.  L-MPZ1608  [MPZ1608]
L1102  tbd.  L-MPZ1608  [MPZ1608]
L1103  tbd.  L-MPZ1608  [MPZ1608]
R1101  100  R0402  [SMD-0402]
R1102  560  R0402  [SMD-0402]
R1103  560  R0402  [SMD-0402]
R1104  560  R0402  [SMD-0402]
R1105  560  R0402  [SMD-0402]
R1106  560  R0402  [SMD-0402]
R1107  560  R0402  [SMD-0402]
R1108  560  R0402  [SMD-0402]
R1109  560  R0402  [SMD-0402]
R1110  560  R0402  [SMD-0402]
R1111  560  R0402  [SMD-0402]
U1101  tlv320aic34  TLV320AIC34ZAS  [S-PBGA-N87-0.5]

### Nets
1V8 [GND]: L1103.2 ; also sheet 7,8,9,10,12,13,16,17,19,20
DMIC-BIAS: U1101.B10(CTRL_A:MICBIAS)
DMIC-CLOCK: R1101.1
DMIC-DATA: U1101.H2(CTRL_A:GPIO2)
EAR+: U1101.A8(HPL_B:P)
EAR-: U1101.A7(HPL_B:N)
FM-L-OUT: U1101.H10(LINE2L_A:P) ; also sheet 9
FM-R-OUT: U1101.F10(LINE2R_A:P) ; also sheet 9
GND [GND]: C1102.2 C1103.2 C1104.2 C1105.2 C1107.2 C1108.2 U1101.D4(POWER:AVSS_DAC) U1101.D5(POWER:DRVSS) U1101.D6(POWER:DRVSS) U1101.D7(POWER:DRVSS) U1101.D8(POWER:AVSS_ADC) U1101.E4(POWER:AVSS_DAC) U1101.E8(POWER:DVSS) U1101.F4(POWER:AVSS_DAC) U1101.F8(POWER:DVSS) U1101.G4(POWER:AVSS_DAC) U1101.G8(POWER:DVSS) U1101.H4(POWER:DVSS) U1101.H5(POWER:DVSS) U1101.H6(POWER:DVSS) U1101.H8(POWER:DVSS) ; also sheet 1,2,3,4,5,6,7,8,9,10,12,13,14,15,16,17,18,19,20
HFL+: C1110.1 R1106.2 ; also sheet 14
HFL-: C1110.2 R1107.2 ; also sheet 14
HFR+: C1111.1 R1108.2 ; also sheet 14
HFR-: C1111.2 R1109.2 ; also sheet 14
HSL+: C1106.1 R1102.2 ; also sheet 12
HSL-: C1106.2 R1103.2 ; also sheet 12
HSR+: C1109.1 R1104.2 ; also sheet 12
HSR-: C1109.2 R1105.2 ; also sheet 12
I2C2-SCL: U1101.L9(I2C:SCL) ; also sheet 4,5,9,12,15,20
I2C2-SDA: U1101.L6(I2C:SDA) ; also sheet 4,5,9,12,15,20
MIC+: U1101.K9(LINE1L_A:P) ; also sheet 12
MIC-: U1101.L10(LINE1L_A:N) ; also sheet 12
MICBIAS: U1101.B11(CTRL_B:MICBIAS)
N$129: U1101.G1(CTRL_B:!RESETB) U1101.G2(CTRL_A:!RESETB) ; also sheet 20
N$130: C1107.1 C1108.1 L1103.1 U1101.H7(POWER:IOVDD) U1101.K1(POWER:DVDD) U1101.K7(POWER:IOVDD)
N$132: C1104.1 C1105.1 L1102.1 U1101.A4(POWER:DRVDD) U1101.A9(POWER:DRVDD) U1101.B4(POWER:DRVDD) U1101.B9(POWER:DRVDD)
N$147: R1101.2 U1101.J2(CTRL_A:GPIO1)
N$148: U1101.K2(CTRL_A:MCLK) ; also sheet 20
N$149: U1101.K5(CTRL_A:DIN) ; also sheet 20
N$150: U1101.K6(CTRL_A:DOUT) ; also sheet 20
N$153: U1101.K3(CTRL_A:BCLK) ; also sheet 20
N$154: U1101.K4(CTRL_A:WCLK) ; also sheet 20
N$155: R1102.1 U1101.B8(HPL_A:P)
N$156: R1103.1 U1101.B7(HPL_A:N)
N$157: R1106.1 U1101.C2(LEFT_A:P)
N$159: R1107.1 U1101.D2(LEFT_A:N)
N$160: R1110.1 U1101.A3(MONO_A:P)
N$161: C1101.1 R1110.2 U1101.E11(LINE2R_B:N)
N$162: R1105.1 U1101.B6(HPR_A:N)
N$164: R1104.1 U1101.B5(HPR_A:P)
N$165: R1108.1 U1101.E2(RIGHT_A:P)
N$166: R1109.1 U1101.F2(RIGHT_A:N)
N$167: C1101.2 R1111.2 U1101.F11(LINE2R_B:P)
N$168: R1111.1 U1101.A2(MONO_A:N)
N$172: C1102.1 C1103.1 L1101.1 U1101.B3(POWER:AVDD_DAC)
VMMC2: L1101.2 L1102.2 ; also sheet 12,20
Unconnected: U1101.A1(MONO_B:P) U1101.A5(HPR_B:P) U1101.A6(HPR_B:N) U1101.A10(MIC3_A:R) U1101.A11(MIC3_B:R) U1101.B1(MONO_B:N) U1101.C1(LEFT_B:P) U1101.C10(CTRL_A:MICDET) U1101.C11(CTRL_B:MICDET) U1101.D1(LEFT_B:N) U1101.D10(MIC3_A:L) U1101.D11(MIC3_B:L) U1101.E1(RIGHT_B:P) U1101.E10(LINE2R_A:N) U1101.F1(RIGHT_B:N) U1101.G10(LINE2L_A:N) U1101.G11(LINE2L_B:N) U1101.H1(CTRL_B:GPIO2) U1101.H11(LINE2L_B:P) U1101.J1(CTRL_B:GPIO1) U1101.J10(LINE1R_A:N) U1101.J11(LINE1R_B:N) U1101.K8(LINE1L_B:P) U1101.K10(LINE1R_A:P) U1101.K11(LINE1R_B:P) U1101.L1(CTRL_B:MCLK) U1101.L2(CTRL_B:BCLK) U1101.L3(CTRL_B:WCLK) U1101.L4(CTRL_B:DIN) U1101.L5(CTRL_B:DOUT) U1101.L7(CTRL_A:ADDR) U1101.L8(CTRL_B:ADDR) U1101.L11(LINE1L_B:N)

### Notes on the sheet
- problem: this is a 0.5mm BGA making lower board expensive!
- but it appears to be not extremely critical (only 3 rows and inner ring is GND)
- problem: analog mic is on upper board!
- alternative: place on upper board (to be evaluated)
- mcbsp1
- conflict with bmc150?
- address: 0x18-0x1b
- Channel A+B
- Audio Codec
- V2b
- (c) 2014 Golden Delicious Computers GmbH&Co. KG. Licensed under CC-BY-SA.

## Sheet 12 of 38
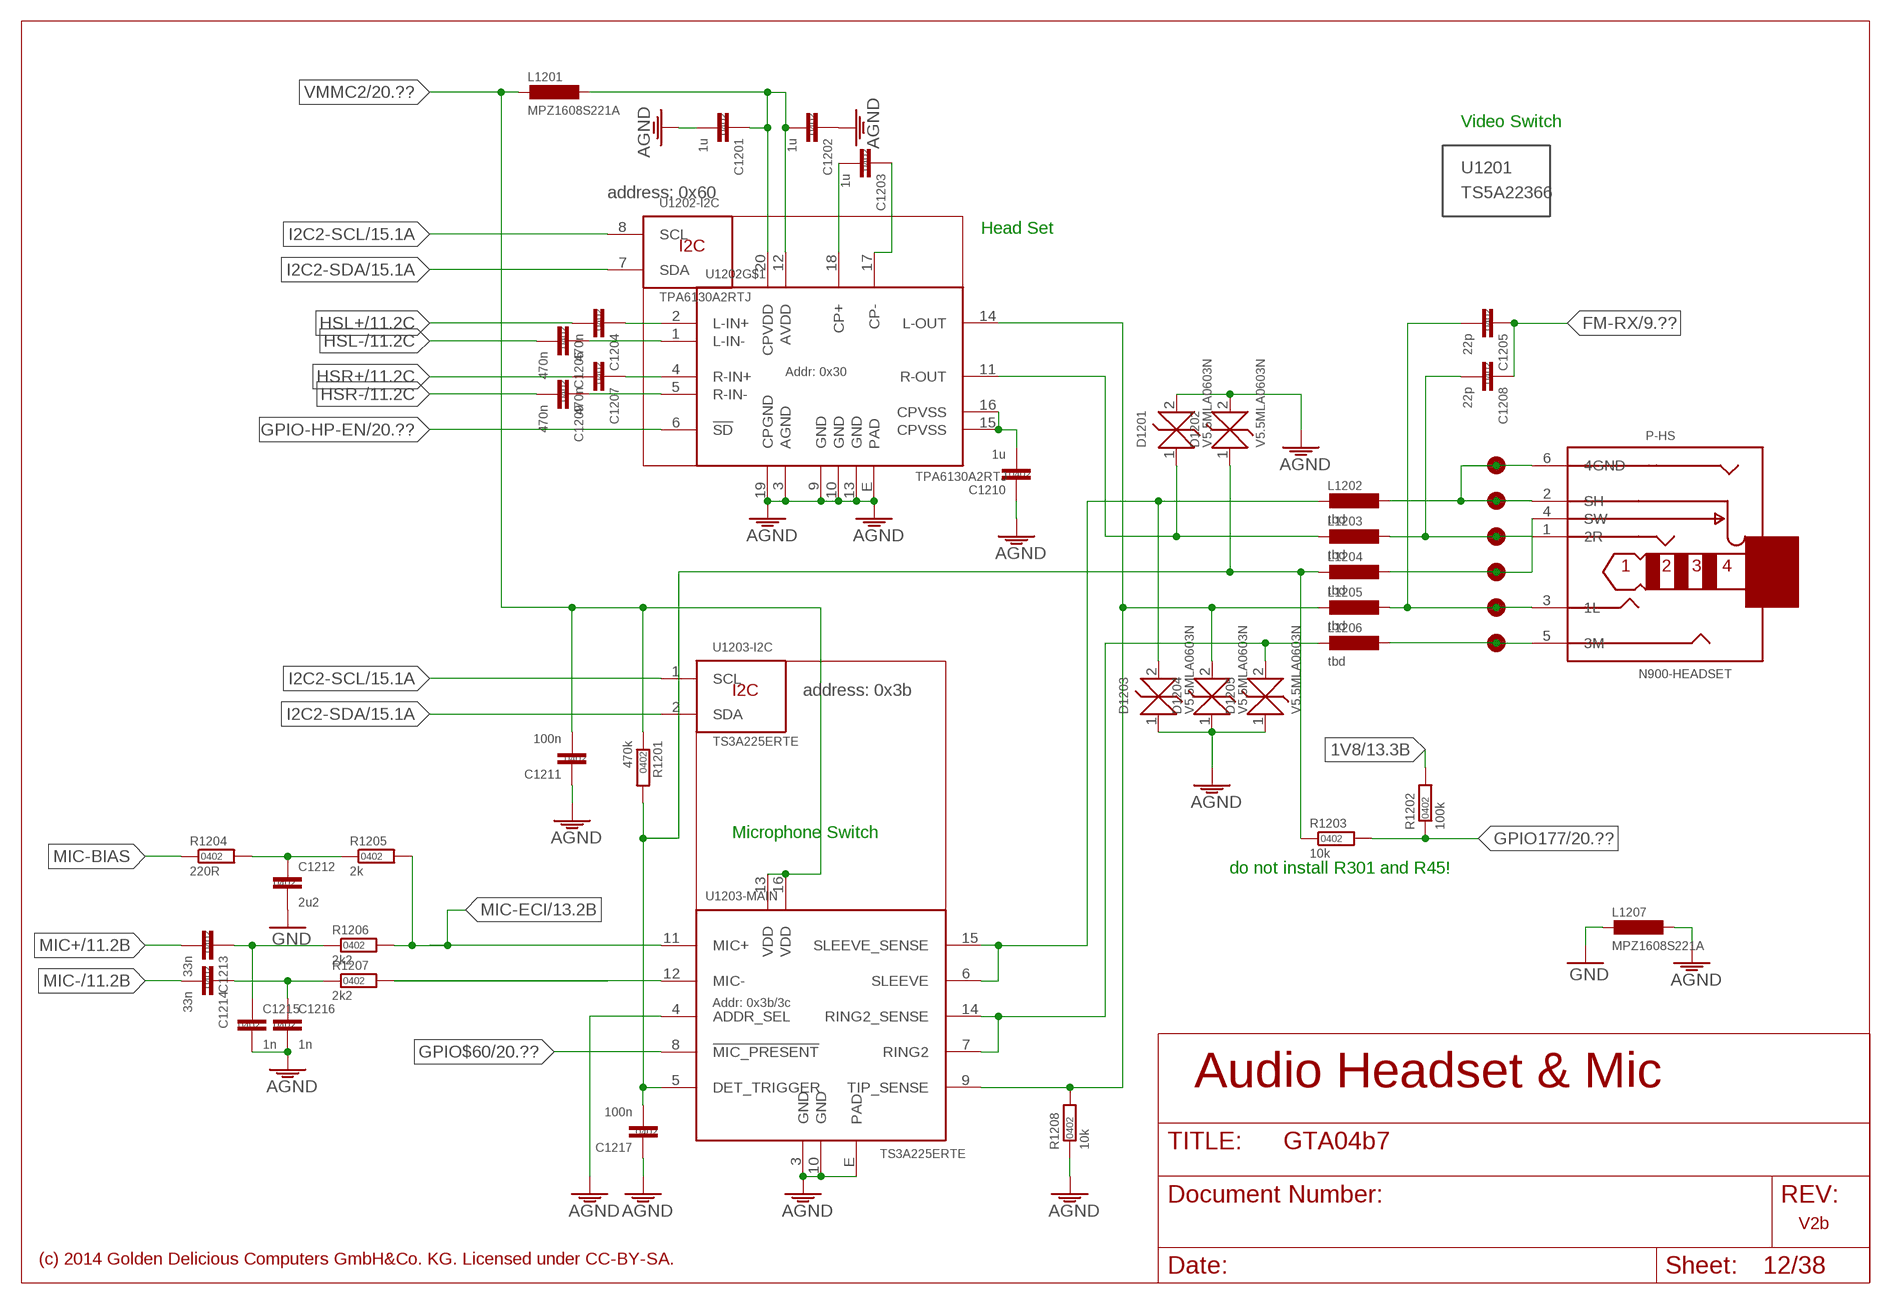
[diagram p15: schematic, sheet 12]

### Parts
C1201  1u  C0402  [SMD-0402]
C1202  1u  C0402  [SMD-0402]
C1203  1u  C0402  [SMD-0402]
C1204  470n  C0402  [SMD-0402]
C1205  22p  C0402  [SMD-0402]
C1206  470n  C0402  [SMD-0402]
C1207  470n  C0402  [SMD-0402]
C1208  22p  C0402  [SMD-0402]
C1209  470n  C0402  [SMD-0402]
C1210  1u  C0402  [SMD-0402]
C1211  100n  C0402  [SMD-0402]
C1212  2u2  C0402  [SMD-0402]
C1213  33n  C0402  [SMD-0402]
C1214  33n  C0402  [SMD-0402]
C1215  1n  C0402  [SMD-0402]
C1216  1n  C0402  [SMD-0402]
C1217  100n  C0402  [SMD-0402]
D1201  V5.5MLA0603N  [SMD-0603]
D1202  V5.5MLA0603N  [SMD-0603]
D1203  V5.5MLA0603N  [SMD-0603]
D1204  V5.5MLA0603N  [SMD-0603]
D1205  V5.5MLA0603N  [SMD-0603]
HS-1201  TEST-POINT-1.25  [TP-1.25]  (not fitted in variant Full)  (not fitted in variant BB-XM)
HS-1202  TEST-POINT-1.25  [TP-1.25]  (not fitted in variant Full)  (not fitted in variant BB-XM)
HS-1203  TEST-POINT-1.25  [TP-1.25]  (not fitted in variant Full)  (not fitted in variant BB-XM)
HS-1204  TEST-POINT-1.25  [TP-1.25]  (not fitted in variant Full)  (not fitted in variant BB-XM)
HS-1205  TEST-POINT-1.25  [TP-1.25]  (not fitted in variant Full)  (not fitted in variant BB-XM)
HS-1206  TEST-POINT-1.25  [TP-1.25]  (not fitted in variant Full)  (not fitted in variant BB-XM)
L1201  MPZ1608S221A  L-MPZ1608  [MPZ1608]
L1202  tbd  L0402  [SMD-0402]
L1203  tbd  L0402  [SMD-0402]
L1204  tbd  L0402  [SMD-0402]
L1205  tbd  L0402  [SMD-0402]
L1206  tbd  L0402  [SMD-0402]
L1207  MPZ1608S221A  L-MPZ1608  [MPZ1608]
P-HS  N900-HEADSET  [N900-HEADSET]
R1201  470k  R0402  [SMD-0402]
R1202  100k  R0402  [SMD-0402]
R1203  10k  R0402  [SMD-0402]
R1204  220R  R0402  [SMD-0402]
R1205  2k  R0402  [SMD-0402]
R1206  2k2  R0402  [SMD-0402]
R1207  2k2  R0402  [SMD-0402]
R1208  10k  R0402  [SMD-0402]
U1201  TS5A22366  MECHANICAL  [NONE]
U1202  TPA6130A2RTJ  [S-PWQFN-N20-0.5]
U1203  TS3A225ERTE  [S-PWQFN-N16-0.5]

### Nets
1V8 [GND]: R1202.2 ; also sheet 7,8,9,10,11,13,16,17,19,20
AGND [GND]: C1201.2 C1202.1 C1210.1 C1211.1 C1215.2 C1216.2 C1217.1 D1201.2(K) D1202.2(K) D1203.1(A) D1204.1(A) D1205.1(A) L1207.1 R1208.1 U1202.3(AGND) U1202.9(GND) U1202.10(GND) U1202.13(GND) U1202.19(CPGND) U1202.E(PAD) U1203.3(-MAIN:GND) U1203.4(-MAIN:ADDR_SEL) U1203.10(-MAIN:GND) U1203.E(-MAIN:PAD) ; supply symbol labelled GND-A
FM-RX [50 Ohm]: C1205.1 C1208.1 ; also sheet 9
GND [GND]: C1212.2 L1207.2 ; also sheet 1,2,3,4,5,6,7,8,9,10,11,13,14,15,16,17,18,19,20
GPIO177: R1202.1 R1203.2 ; also sheet 20
GPIO$60: U1203.8(-MAIN:!MIC_PRESENT) ; also sheet 20
GPIO-HP-EN: U1202.6(!SD) ; also sheet 20
HSL+: C1204.2 ; also sheet 11
HSL-: C1206.2 ; also sheet 11
HSR+: C1207.2 ; also sheet 11
HSR-: C1209.2 ; also sheet 11
I2C2-SCL: U1202.8(-I2C:SCL) U1203.1(-I2C:SCL) ; also sheet 4,5,9,11,15,20
I2C2-SDA: U1202.7(-I2C:SDA) U1203.2(-I2C:SDA) ; also sheet 4,5,9,11,15,20
MIC+: C1213.2 ; also sheet 11
MIC-: C1214.2 ; also sheet 11
MIC-BIAS: R1204.1
MIC-ECI: R1205.2 R1206.2 U1203.11(-MAIN:MIC+) ; also sheet 13
N$10: C1210.2 U1202.15(CPVSS) U1202.16(CPVSS)
N$21: C1203.2 U1202.18(CP+)
N$25: C1203.1 U1202.17(CP-)
N$26: C1204.1 U1202.2(L-IN+)
N$33: C1206.1 U1202.1(L-IN-)
N$35: C1207.1 U1202.4(R-IN+)
N$41: C1209.1 U1202.5(R-IN-)
N$48: R1207.2 U1203.12(-MAIN:MIC-)
N$49: C1213.1 C1215.1 R1206.1
N$50: C1214.1 C1216.1 R1207.1
N$58: D1203.2(K) L1202.2 U1203.6(-MAIN:SLEEVE) U1203.15(-MAIN:SLEEVE_SENSE)
N$64: D1205.2(K) L1206.2 U1203.7(-MAIN:RING2) U1203.14(-MAIN:RING2_SENSE)
N$92: D1201.1(A) L1203.2 U1202.11(R-OUT)
N$93: C1217.2 D1202.1(A) L1204.2 R1201.2 R1203.1 U1203.5(-MAIN:DET_TRIGGER)
N$95: D1204.2(K) L1205.2 R1208.2 U1202.14(L-OUT) U1203.9(-MAIN:TIP_SENSE)
N$142: C1201.1 C1202.2 L1201.1 U1202.12(AVDD) U1202.20(CPVDD)
N$145: C1212.1 R1204.2 R1205.1
N$299: HS-1201.P HS-1202.P L1202.1 P-HS.2(SH) P-HS.6(4GND)
N$301: HS-1204.P L1204.1 P-HS.4(SW)
N$302: C1205.2 HS-1205.P L1205.1 P-HS.3(1L)
N$303: HS-1206.P L1206.1 P-HS.5(3M)
N$304: C1208.2 HS-1203.P L1203.1 P-HS.1(2R)
VMMC2: C1211.2 L1201.2 R1201.1 U1203.13(-MAIN:VDD) U1203.16(-MAIN:VDD) ; also sheet 11,20

### Notes on the sheet
- Video Switch
- address: 0x60
- Head Set
- address: 0x3b
- Microphone Switch
- do not install R301 and R45!
- Audio Headset & Mic
- V2b
- (c) 2014 Golden Delicious Computers GmbH&Co. KG. Licensed under CC-BY-SA.

## Sheet 13 of 38
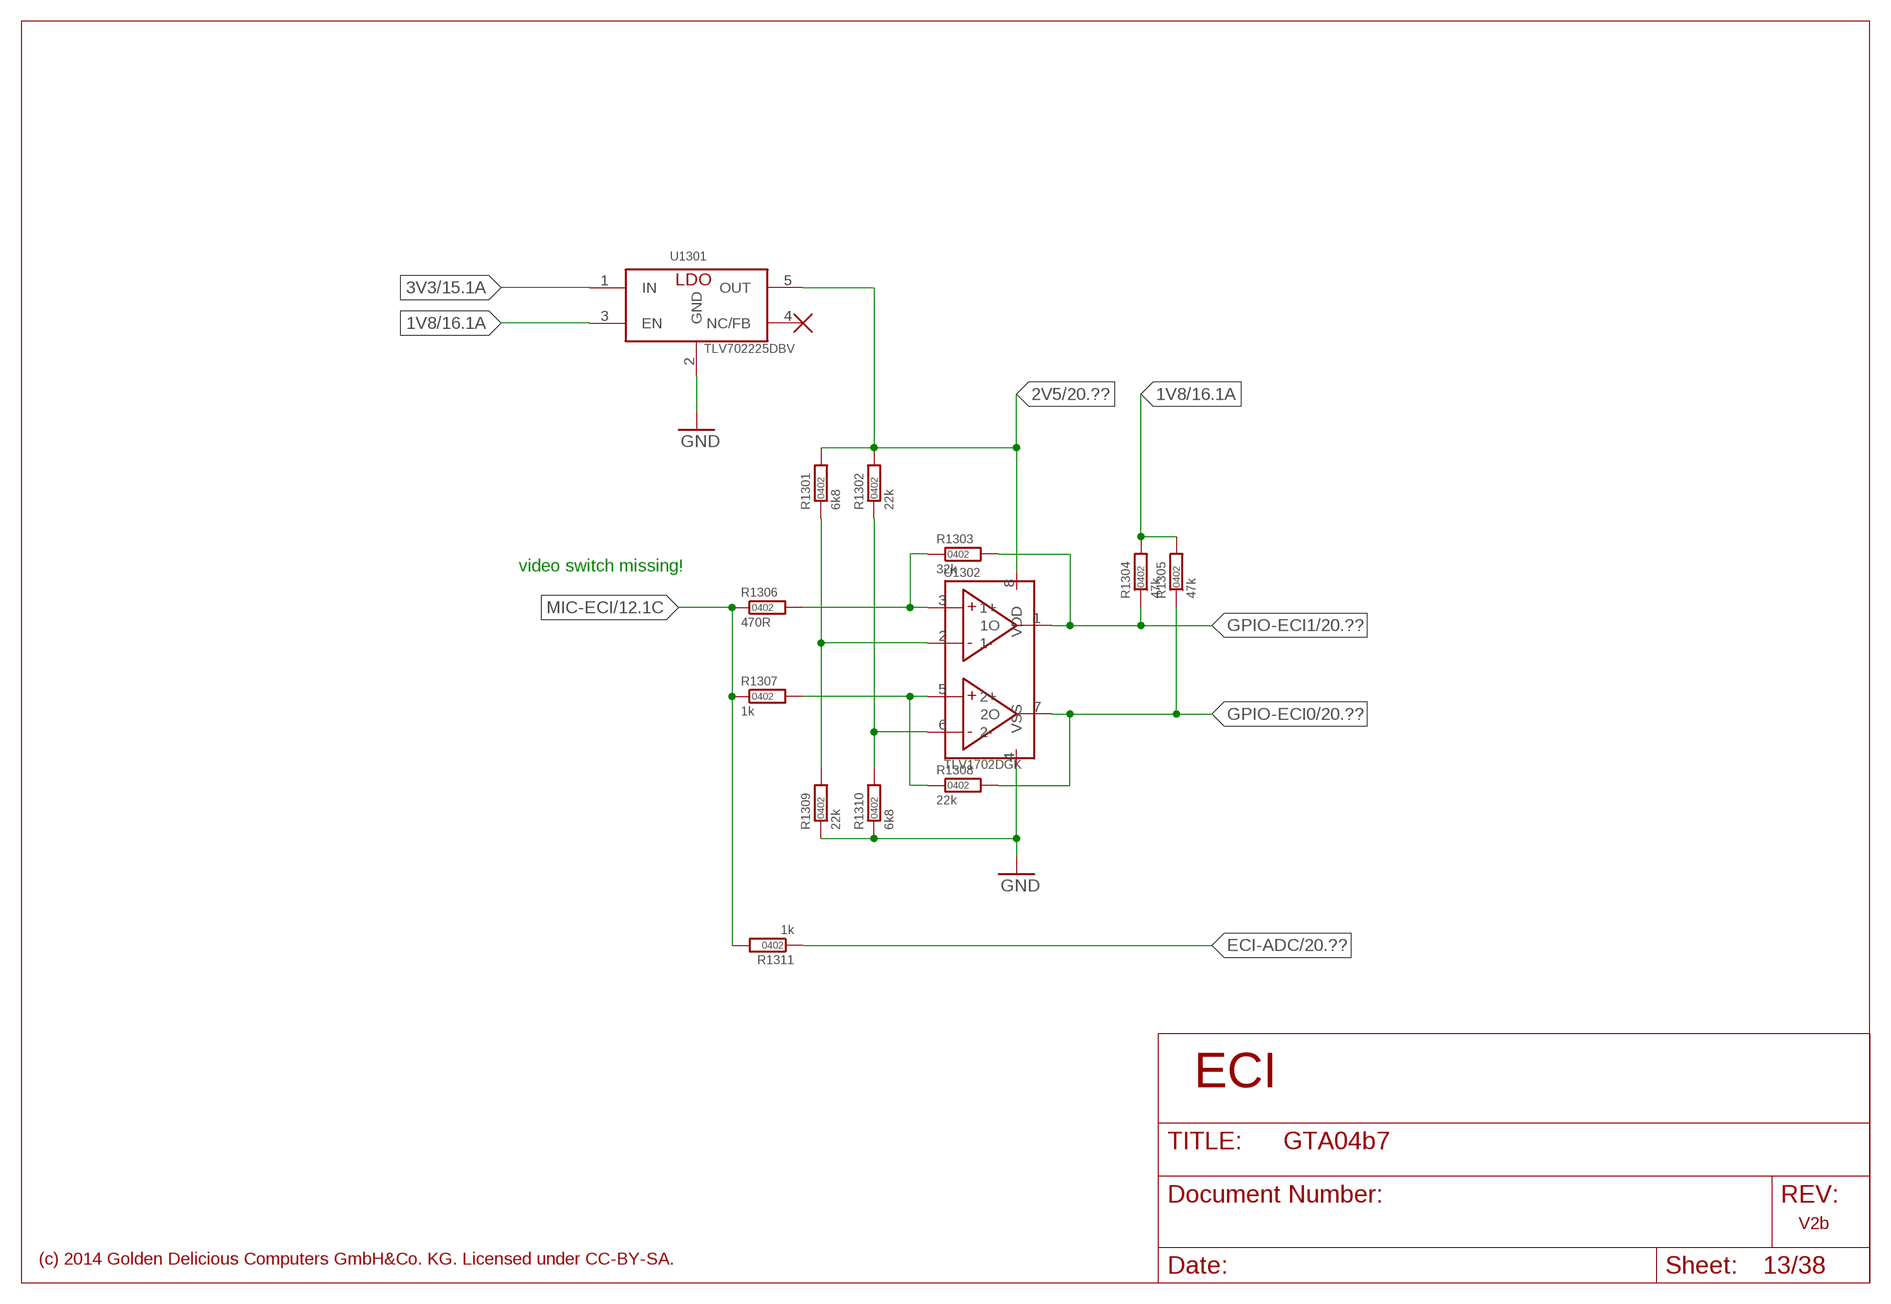
[diagram p16: schematic, sheet 13]

### Parts
R1301  6k8  R0402  [SMD-0402]
R1302  22k  R0402  [SMD-0402]
R1303  32k  R0402  [SMD-0402]
R1304  47k  R0402  [SMD-0402]
R1305  47k  R0402  [SMD-0402]
R1306  470R  R0402  [SMD-0402]
R1307  1k  R0402  [SMD-0402]
R1308  22k  R0402  [SMD-0402]
R1309  22k  R0402  [SMD-0402]
R1310  6k8  R0402  [SMD-0402]
R1311  1k  R0402  [SMD-0402]
U1301  TLV702225DBV  TLV70230DBV  [SOT23-5]
U1302  TLV1702DGK  [R-PDSO-G8-0.65]

### Nets
1V8 [GND]: R1304.2 R1305.2 U1301.3(EN) ; also sheet 7,8,9,10,11,12,16,17,19,20
2V5: R1301.2 R1302.2 U1301.5(OUT) U1302.8(VDD) ; also sheet 20
3V3: U1301.1(IN) ; also sheet 7,8,9,10,15,16,19,20
ECI-ADC: R1311.1 ; also sheet 20
GND [GND]: R1309.1 R1310.1 U1301.2(GND) U1302.4(VSS) ; also sheet 1,2,3,4,5,6,7,8,9,10,11,12,14,15,16,17,18,19,20
GPIO-ECI0: R1305.1 R1308.2 U1302.7(2O) ; also sheet 20
GPIO-ECI1: R1303.2 R1304.1 U1302.1(1O) ; also sheet 20
MIC-ECI: R1306.1 R1307.1 R1311.2 ; also sheet 12
N$125: R1302.1 R1310.2 U1302.6(2-)
N$126: R1301.1 R1309.2 U1302.2(1-)
N$128: R1303.1 R1306.2 U1302.3(1+)
N$306: R1307.2 R1308.1 U1302.5(2+)
Unconnected: U1301.4(NC/FB)

### Notes on the sheet
- video switch missing!
- ECI
- V2b
- (c) 2014 Golden Delicious Computers GmbH&Co. KG. Licensed under CC-BY-SA.

## Sheet 14 of 38
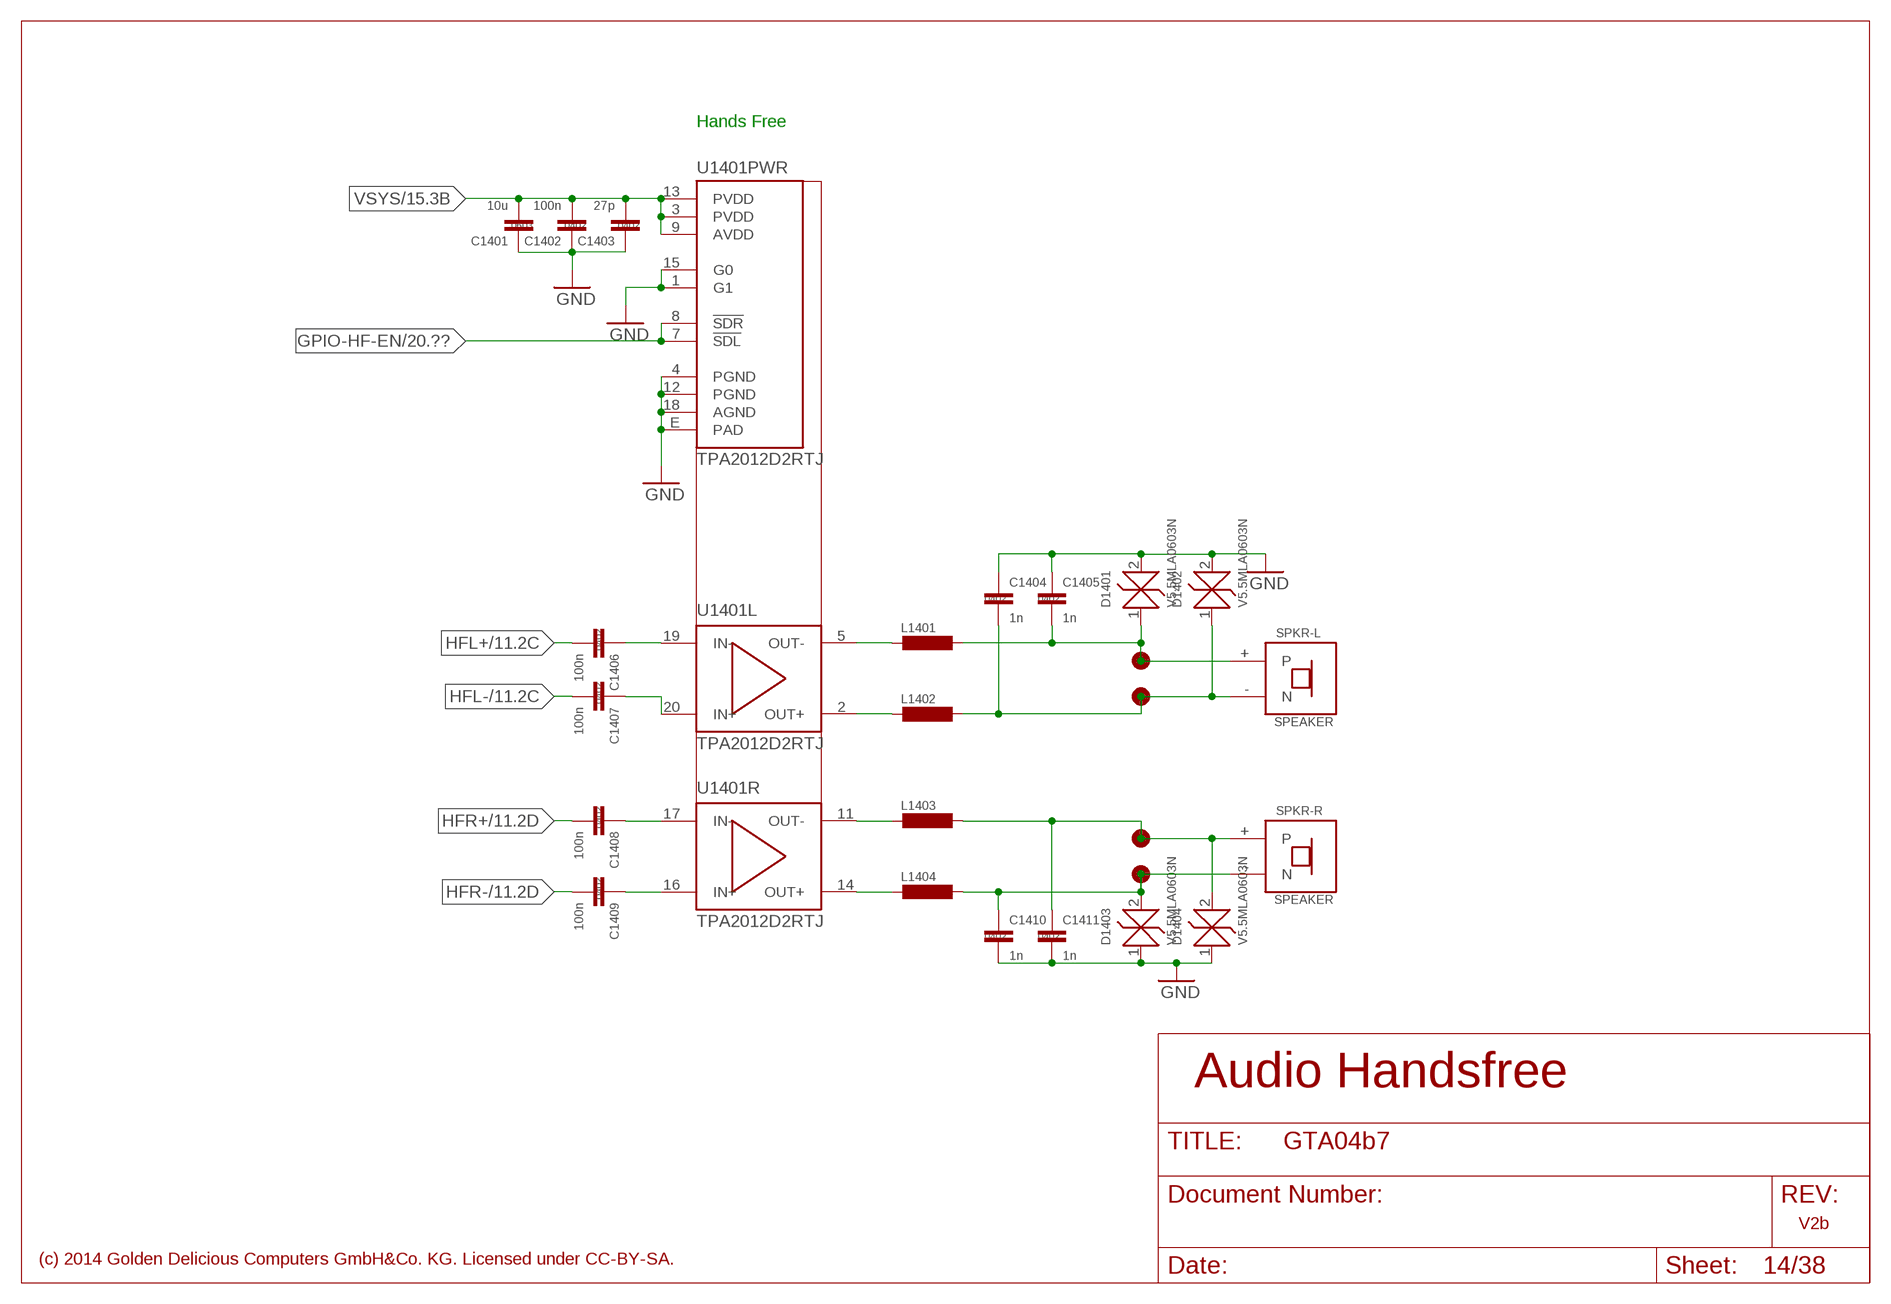
[diagram p17: schematic, sheet 14]

### Parts
C1401  10u  C0603  [SMD-0603]
C1402  100n  C0402  [SMD-0402]
C1403  27p  C0402  [SMD-0402]
C1404  1n  C0402  [SMD-0402]
C1405  1n  C0402  [SMD-0402]
C1406  100n  C0402  [SMD-0402]
C1407  100n  C0402  [SMD-0402]
C1408  100n  C0402  [SMD-0402]
C1409  100n  C0402  [SMD-0402]
C1410  1n  C0402  [SMD-0402]
C1411  1n  C0402  [SMD-0402]
D1401  V5.5MLA0603N  [SMD-0603]
D1402  V5.5MLA0603N  [SMD-0603]
D1403  V5.5MLA0603N  [SMD-0603]
D1404  V5.5MLA0603N  [SMD-0603]
L1401  L0402  [SMD-0402]
L1402  L0402  [SMD-0402]
L1403  L0402  [SMD-0402]
L1404  L0402  [SMD-0402]
SPKR-L  SPEAKER  SPEAKER-PETRA  [2403-260-00031]  (not fitted in variant Full)  (not fitted in variant BB-XM)
SPKR-R  SPEAKER  SPEAKER-PETRA  [2403-260-00031]  (not fitted in variant Full)  (not fitted in variant BB-XM)
SPKRL+  TEST-POINT-1.25  [TP-1.25]  (not fitted in variant Full)  (not fitted in variant BB-XM)
SPKRL-  TEST-POINT-1.25  [TP-1.25]  (not fitted in variant Full)  (not fitted in variant BB-XM)
SPKRR+  TEST-POINT-1.25  [TP-1.25]  (not fitted in variant Full)  (not fitted in variant BB-XM)
SPKRR-  TEST-POINT-1.25  [TP-1.25]  (not fitted in variant Full)  (not fitted in variant BB-XM)
U1401  TPA2012D2RTJ  [S-PWQFN-N20-0.5]

### Nets
GND [GND]: C1401.1 C1402.1 C1403.1 C1404.1 C1405.1 C1410.2 C1411.2 D1401.2(K) D1402.2(K) D1403.1(A) D1404.1(A) U1401.1(PWR:G1) U1401.4(PWR:PGND) U1401.12(PWR:PGND) U1401.15(PWR:G0) U1401.18(PWR:AGND) U1401.E(PWR:PAD) ; also sheet 1,2,3,4,5,6,7,8,9,10,11,12,13,15,16,17,18,19,20
GPIO-HF-EN: U1401.7(PWR:!SDL) U1401.8(PWR:!SDR) ; also sheet 20
HFL+: C1406.2 ; also sheet 11
HFL-: C1407.2 ; also sheet 11
HFR+: C1408.2 ; also sheet 11
HFR-: C1409.2 ; also sheet 11
N$28: C1404.2 D1402.1(A) L1402.1 SPKR-L.-(N) SPKRL-.P
N$29: C1410.1 D1403.2(K) L1404.1 SPKR-R.-(N) SPKRR-.P
N$30: C1405.2 D1401.1(A) L1401.1 SPKR-L.+(P) SPKRL+.P
N$46: C1406.1 U1401.19(L:IN-)
N$47: C1407.1 U1401.20(L:IN+)
N$122: C1408.1 U1401.17(R:IN-)
N$123: C1409.1 U1401.16(R:IN+)
N$243: L1401.2 U1401.5(L:OUT-)
N$244: L1402.2 U1401.2(L:OUT+)
N$297: L1403.2 U1401.11(R:OUT-)
N$298: L1404.2 U1401.14(R:OUT+)
SPKRR+: C1411.1 D1404.2(K) L1403.1 SPKR-R.+(P) SPKRR+.P
VSYS [GND]: C1401.2 C1402.2 C1403.2 U1401.3(PWR:PVDD) U1401.9(PWR:AVDD) U1401.13(PWR:PVDD) ; also sheet 3,4,9,15,18,19,20

### Notes on the sheet
- Hands Free
- Audio Handsfree
- V2b
- (c) 2014 Golden Delicious Computers GmbH&Co. KG. Licensed under CC-BY-SA.

## Sheet 15 of 38
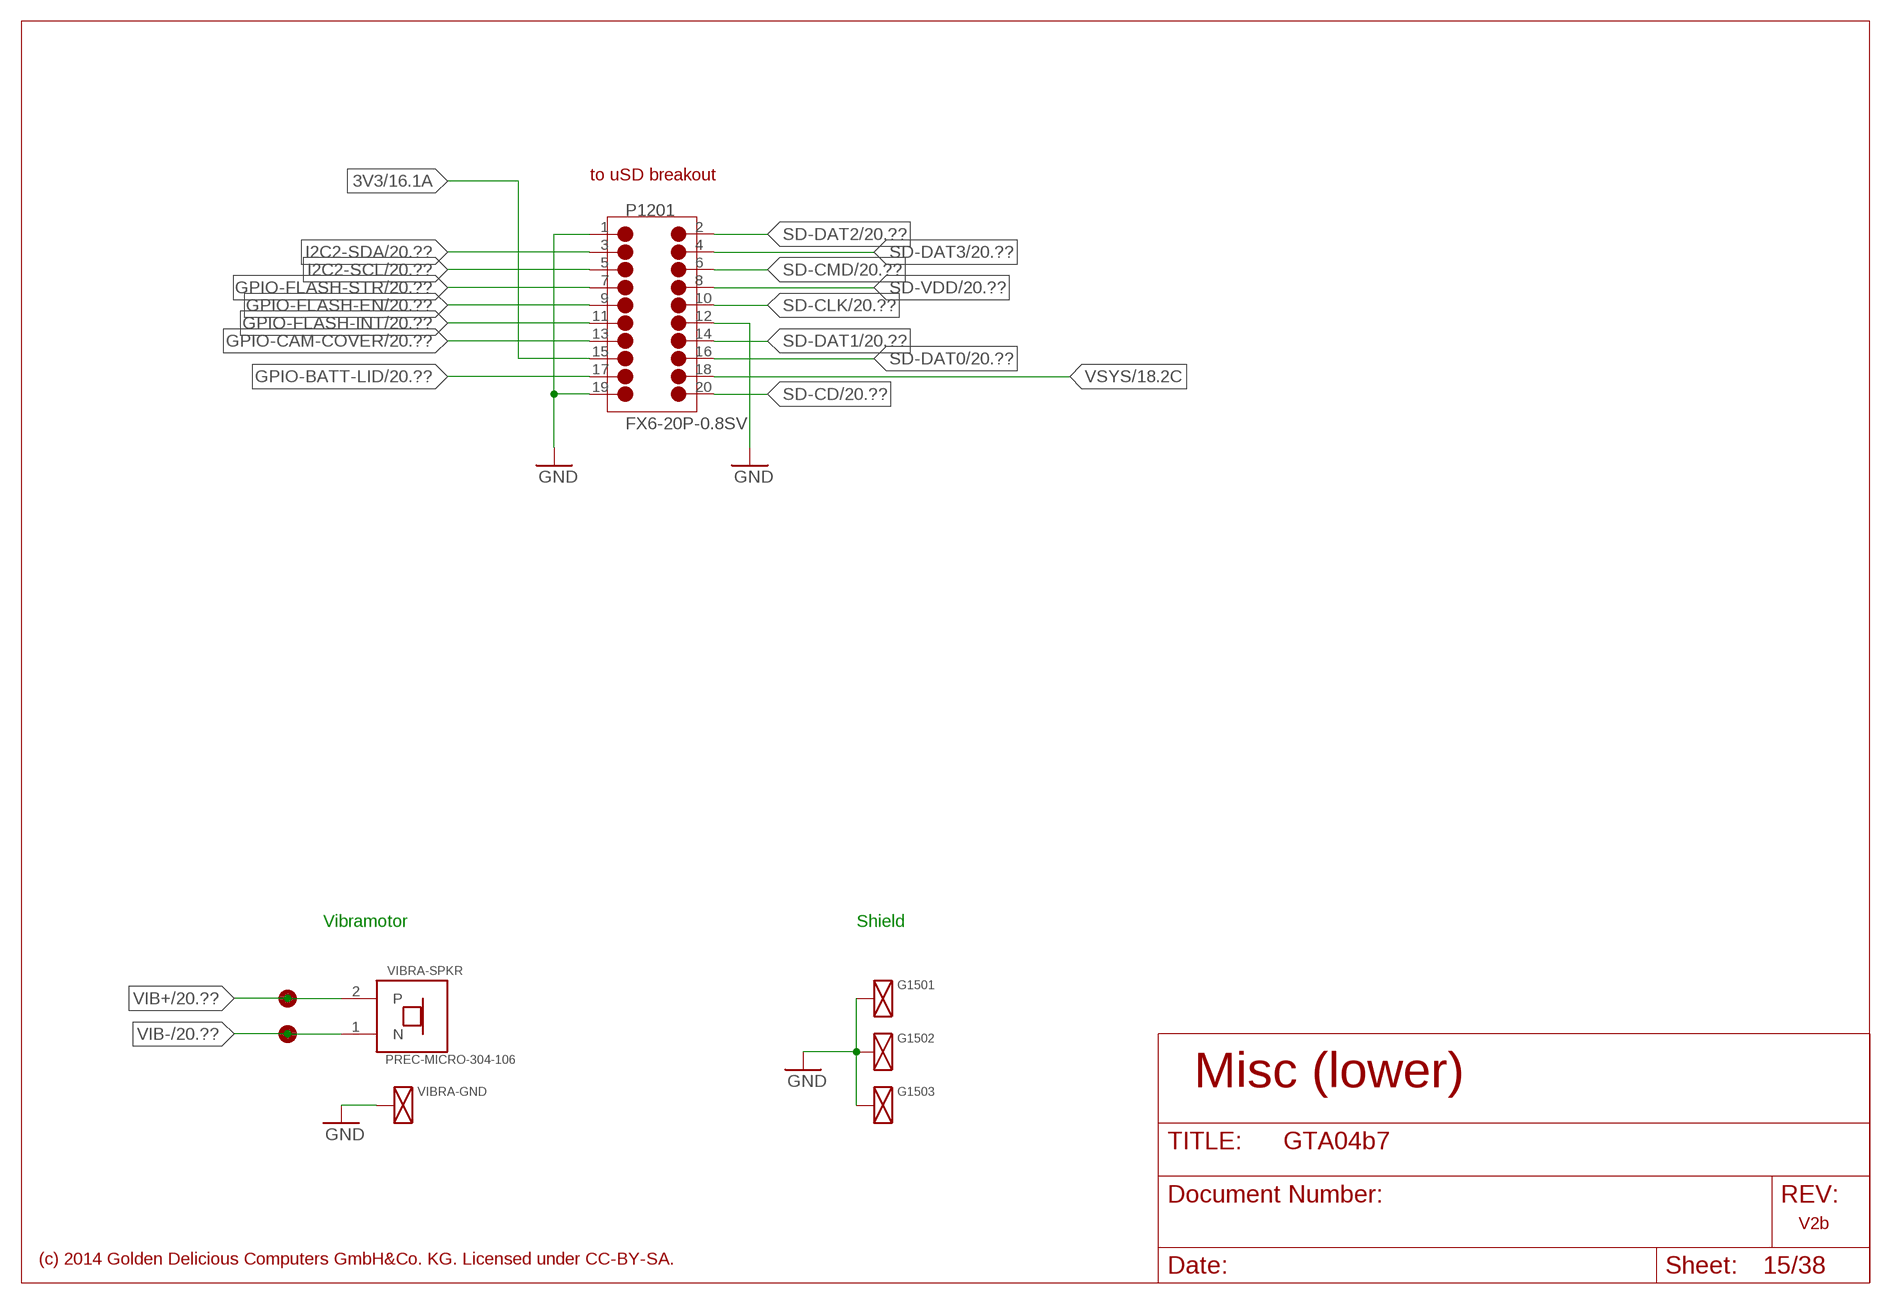
[diagram p18: schematic, sheet 15]

### Parts
G1501  SHIELDPAD-3.5X2.5  [PAD-3.5X2.5]  (not fitted in variant Full)  (not fitted in variant BB-XM)
G1502  SHIELDPAD-3.5X2.5  [PAD-3.5X2.5]  (not fitted in variant Full)  (not fitted in variant BB-XM)
G1503  SHIELDPAD-3.5X2.5  [PAD-3.5X2.5]  (not fitted in variant Full)  (not fitted in variant BB-XM)
P1501  FX6-20-PLUG  FX6-20S-0.8SV  [FX6-20S-0.8SV]
VIBRA  PREC-MICRO-304-106  SPEAKER-SHIELD-304-106  [PREC-MICRO-304-106]
VIBRA+  TEST-POINT-1.25  [TP-1.25]  (not fitted in variant Full)  (not fitted in variant BB-XM)
VIBRA-  TEST-POINT-1.25  [TP-1.25]  (not fitted in variant Full)  (not fitted in variant BB-XM)

### Nets
3V3: P1501.15 ; also sheet 7,8,9,10,13,16,19,20
GND [GND]: G1501.1(SHIELD) G1502.1(SHIELD) G1503.1(SHIELD) P1501.1 P1501.12 P1501.19 VIBRA.SHIELD(-GND:SHIELD) ; also sheet 1,2,3,4,5,6,7,8,9,10,11,12,13,14,16,17,18,19,20
GPIO-BATT-LID: P1501.17 ; also sheet 20
GPIO-CAM-COVER: P1501.13 ; also sheet 20
GPIO-FLASH-EN: P1501.9 ; also sheet 20
GPIO-FLASH-INT: P1501.11 ; also sheet 20
GPIO-FLASH-STR: P1501.7 ; also sheet 20
I2C2-SCL: P1501.5 ; also sheet 4,5,9,11,12,20
I2C2-SDA: P1501.3 ; also sheet 4,5,9,11,12,20
SD-CD: P1501.20 ; also sheet 20
SD-CLK: P1501.10 ; also sheet 20
SD-CMD: P1501.6 ; also sheet 20
SD-DAT0: P1501.16 ; also sheet 20
SD-DAT1: P1501.14 ; also sheet 20
SD-DAT2: P1501.2 ; also sheet 20
SD-DAT3: P1501.4 ; also sheet 20
SD-VDD: P1501.8 ; also sheet 20
VIB+: VIBRA+.P VIBRA.2(-SPKR:P) ; also sheet 20
VIB-: VIBRA-.P VIBRA.1(-SPKR:N) ; also sheet 20
VSYS [GND]: P1501.18 ; also sheet 3,4,9,14,18,19,20

### Notes on the sheet
- to uSD breakout
- P1201
- FX6-20P-0.8SV
- Vibramotor | Shield
- Misc (lower)
- V2b
- (c) 2014 Golden Delicious Computers GmbH&Co. KG. Licensed under CC-BY-SA.